# EAGLE schematic PKG900000001400 (EAGLE 7.7.0)

## Sheet 1 of 23
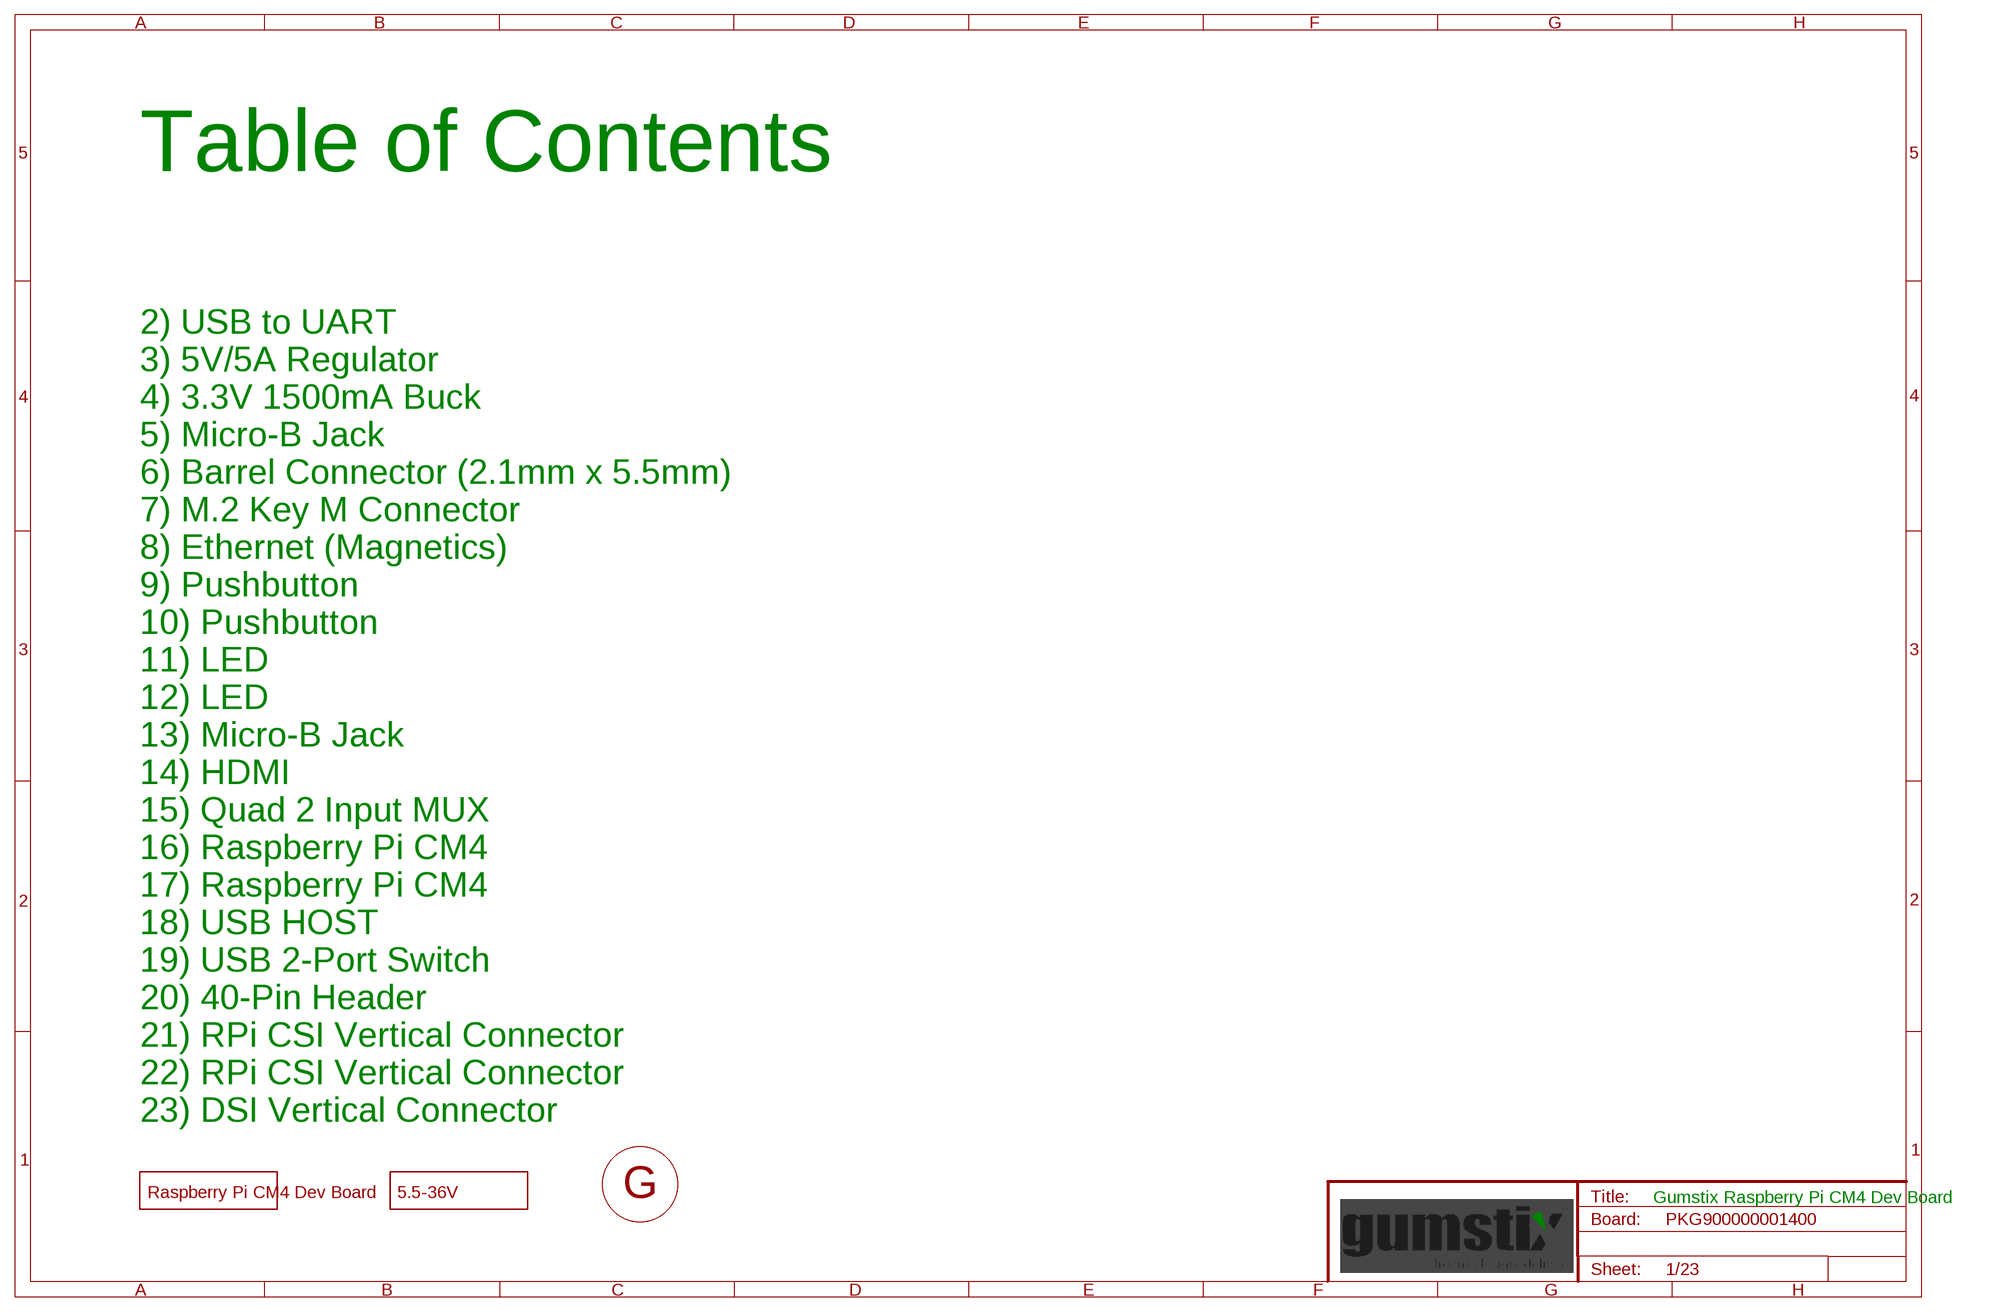
[diagram p0: schematic, sheet 1]

### Parts
FD1  DNP  FIDUCIAL  [FIDUCIAL]
FD2  DNP  FIDUCIAL  [FIDUCIAL]
FD3  DNP  FIDUCIAL  [FIDUCIAL]
FD4  DNP  FIDUCIAL  [FIDUCIAL]
FD5  DNP  FIDUCIAL  [FIDUCIAL]
FD6  DNP  FIDUCIAL  [FIDUCIAL]
FD7  DNP  FIDUCIAL  [FIDUCIAL]
FD8  DNP  FIDUCIAL  [FIDUCIAL]
U$3  DNP  GEPPETTO_LABEL"  [GEPPETTO_LABEL]
U$4  DNP  GEPPETTO_LOGO10X10  [GEPPETTO_LOGO_SILK10]
U$6  DNP  TIP_POSITIVE_LABEL  [TIP_POSITIVE_LABEL]

### Notes on the sheet
- Table of Contents
- 2) USB to UART
- 3) 5V/5A Regulator
- 4) 3.3V 1500mA Buck
- 5) Micro-B Jack
- 6) Barrel Connector (2.1mm x 5.5mm)
- 7) M.2 Key M Connector
- 8) Ethernet (Magnetics)
- 9) Pushbutton
- 10) Pushbutton
- 11) LED
- 12) LED
- 13) Micro-B Jack
- 14) HDMI
- 15) Quad 2 Input MUX
- 16) Raspberry Pi CM4
- 17) Raspberry Pi CM4
- 18) USB HOST
- 19) USB 2-Port Switch
- 20) 40-Pin Header
- 21) RPi CSI Vertical Connector
- 22) RPi CSI Vertical Connector
- 23) DSI Vertical Connector
- Gumstix Raspberry Pi CM4 Dev Board

## Sheet 2 of 23
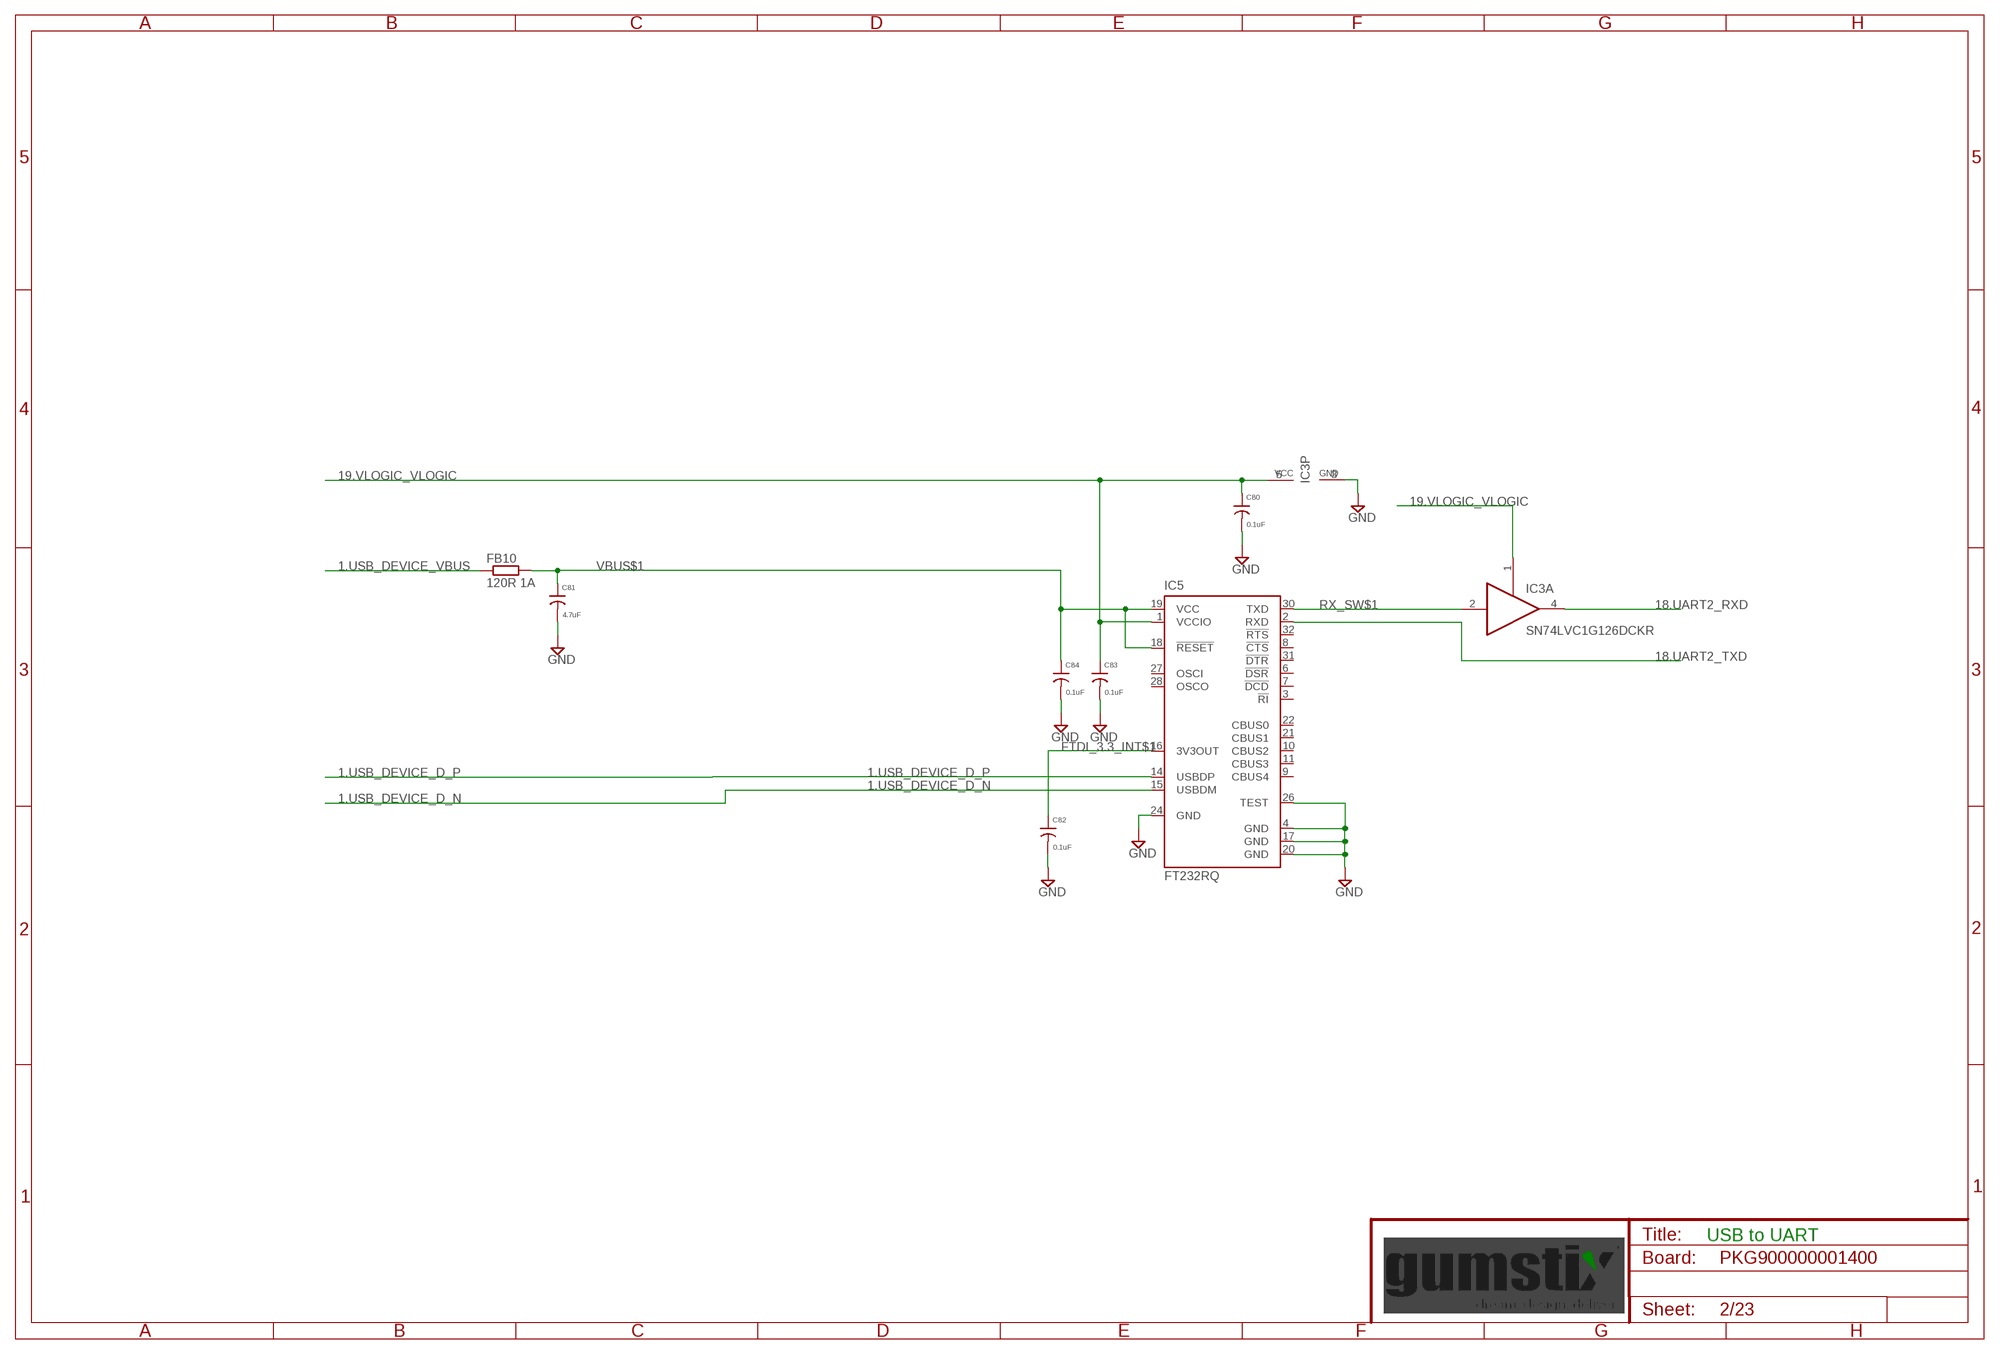
[diagram p1: schematic, sheet 2]

### Parts
C80  0.1uF  C0201  [0201]
C81  4.7uF  C0603  [0603]
C82  0.1uF  C0201  [0201]
C83  0.1uF  C0201  [0201]
C84  0.1uF  C0201  [0201]
FB10  120R 1A  FB0402  [0402]
IC3  SN74LVC1G126DCKR  [SC70-5]
IC5  FT232RQ  [QFN32]

### Nets
1.USB_DEVICE_D_N [USB]: IC5.15(USBDM) ; also sheet 5
1.USB_DEVICE_D_P [USB]: IC5.14(USBDP) ; also sheet 5
1.USB_DEVICE_VBUS [supply]: FB10.1 ; also sheet 5,15
18.UART2_RXD: IC3.4(A:O) ; also sheet 15
18.UART2_TXD: IC5.2(RXD) ; also sheet 15
19.VLOGIC_VLOGIC [supply]: C80.1 C83.1 IC3.1(A:OE) IC3.5(P:VCC) IC5.1(VCCIO) ; also sheet 9,10,14,15,16
FTDI_3.3_INT$1 [supply]: C82.1 IC5.16(3V3OUT)
GND [supply]: C80.2 C81.2 C82.2 C83.2 C84.2 IC3.3(P:GND) IC5.4(GND) IC5.17(GND) IC5.20(GND) IC5.24(GND) IC5.26(TEST) ; also sheet 3,4,5,6,7,8,9,10,11,12,13,14,15,16,17,18,19,20,21,22,23
RX_SW$1: IC3.2(A:I) IC5.30(TXD)
VBUS$1 [supply]: C81.1 C84.1 FB10.2 IC5.18(!RESET) IC5.19(VCC)
Unconnected: IC5.3(!RI) IC5.6(!DSR) IC5.7(!DCD) IC5.8(!CTS) IC5.9(CBUS4) IC5.10(CBUS2) IC5.11(CBUS3) IC5.21(CBUS1) IC5.22(CBUS0) IC5.27(OSCI) IC5.28(OSCO) IC5.31(!DTR) IC5.32(!RTS)

### Notes on the sheet
- USB to UART

## Sheet 3 of 23
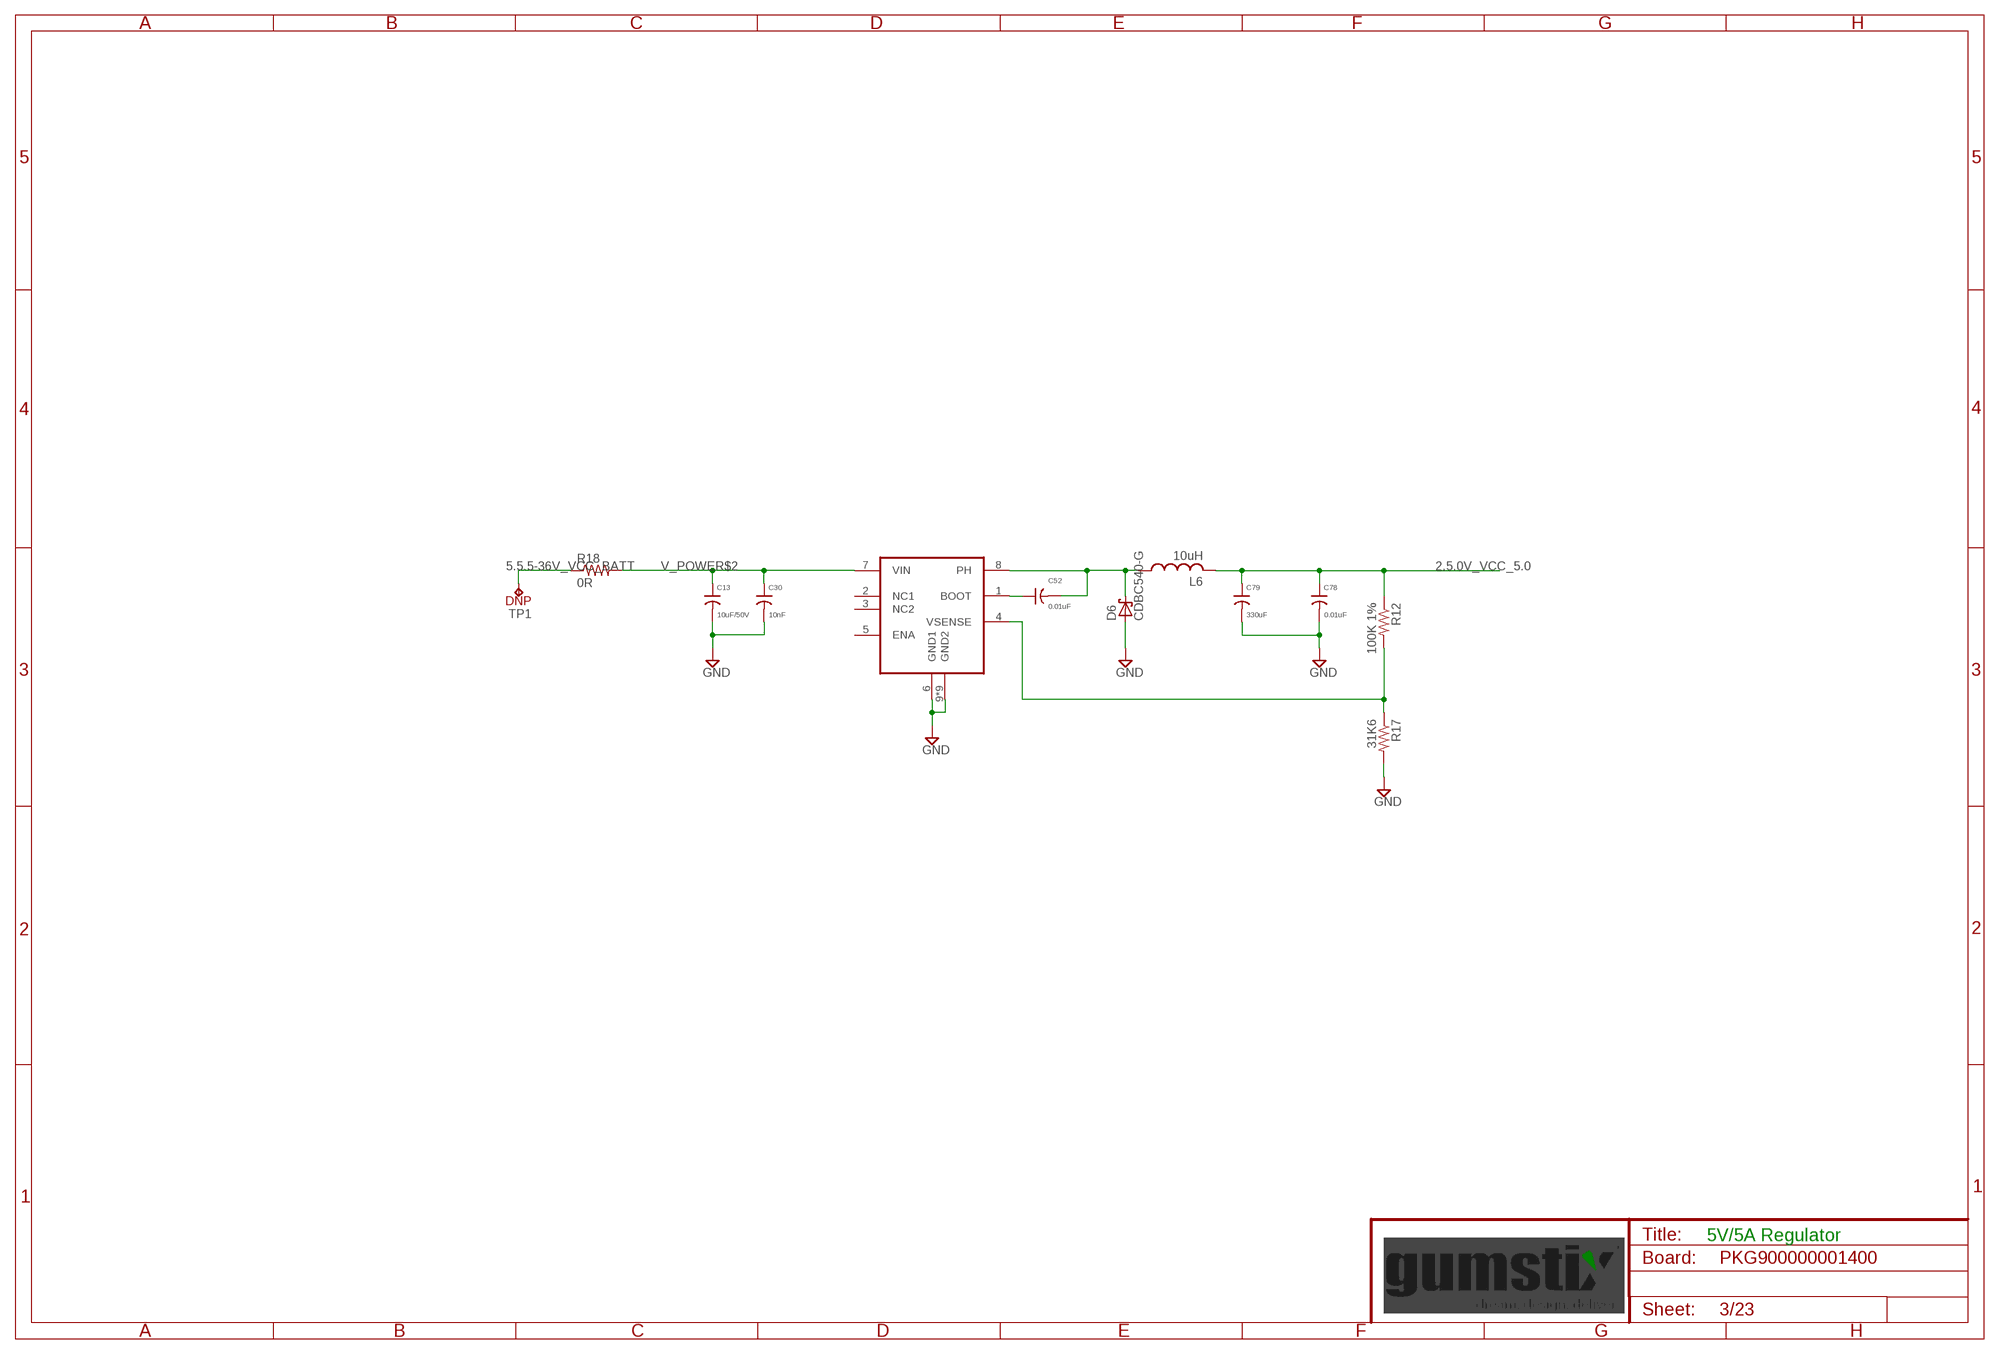
[diagram p2: schematic, sheet 3]

### Parts
C13  10uF/50V  C1206  [1206]
C30  10nF  C0603  [0603]
C52  0.01uF  C0201  [0201]
C78  0.01uF  C0201  [0201]
C79  330uF  CPANASONIC_F  [PANASONIC_F]
D6  CDBC540-G  SCHOTTKY-DIODE  [DO-214AB]
L6  10uH  L3232DZ  [3232DZ]
R12  100K 1%  R0201  [0201]
R17  31K6  R0402  [0402]
R18  0R  R0805  [0805]
TP1  DNP  TP05  [TP0500]
U7  TPS5450  [8SO_POWERPAD]

### Nets
2.5.0V_VCC_5.0 [supply]: C78.1 C79.+ L6.2 R12.1 ; also sheet 4,14,16,18,20
5.5.5-36V_VCC_BATT [supply]: R18.1 TP1.1(TP) ; also sheet 6
BOOT$2 [supply]: C52.1 U7.1(BOOT)
GND [supply]: C13.2 C30.2 C78.2 C79.- D6.A R17.2 U7.6(GND1) U7.9(GND2) U7.PWRPAD1(GND2) U7.PWRPAD2(GND2) U7.PWRPAD3(GND2) U7.PWRPAD4(GND2) U7.PWRPAD5(GND2) U7.PWRPAD6(GND2) U7.PWRPAD7(GND2) U7.PWRPAD8(GND2) ; also sheet 2,4,5,6,7,8,9,10,11,12,13,14,15,16,17,18,19,20,21,22,23
PH$2 [supply]: C52.2 D6.C L6.1 U7.8(PH)
V_POWER$2 [supply]: C13.1 C30.1 R18.2 U7.7(VIN)
VSENSE$2 [supply]: R12.2 R17.1 U7.4(VSENSE)
Unconnected: U7.2(NC1) U7.3(NC2) U7.5(ENA)

### Notes on the sheet
- 5V/5A Regulator

## Sheet 4 of 23
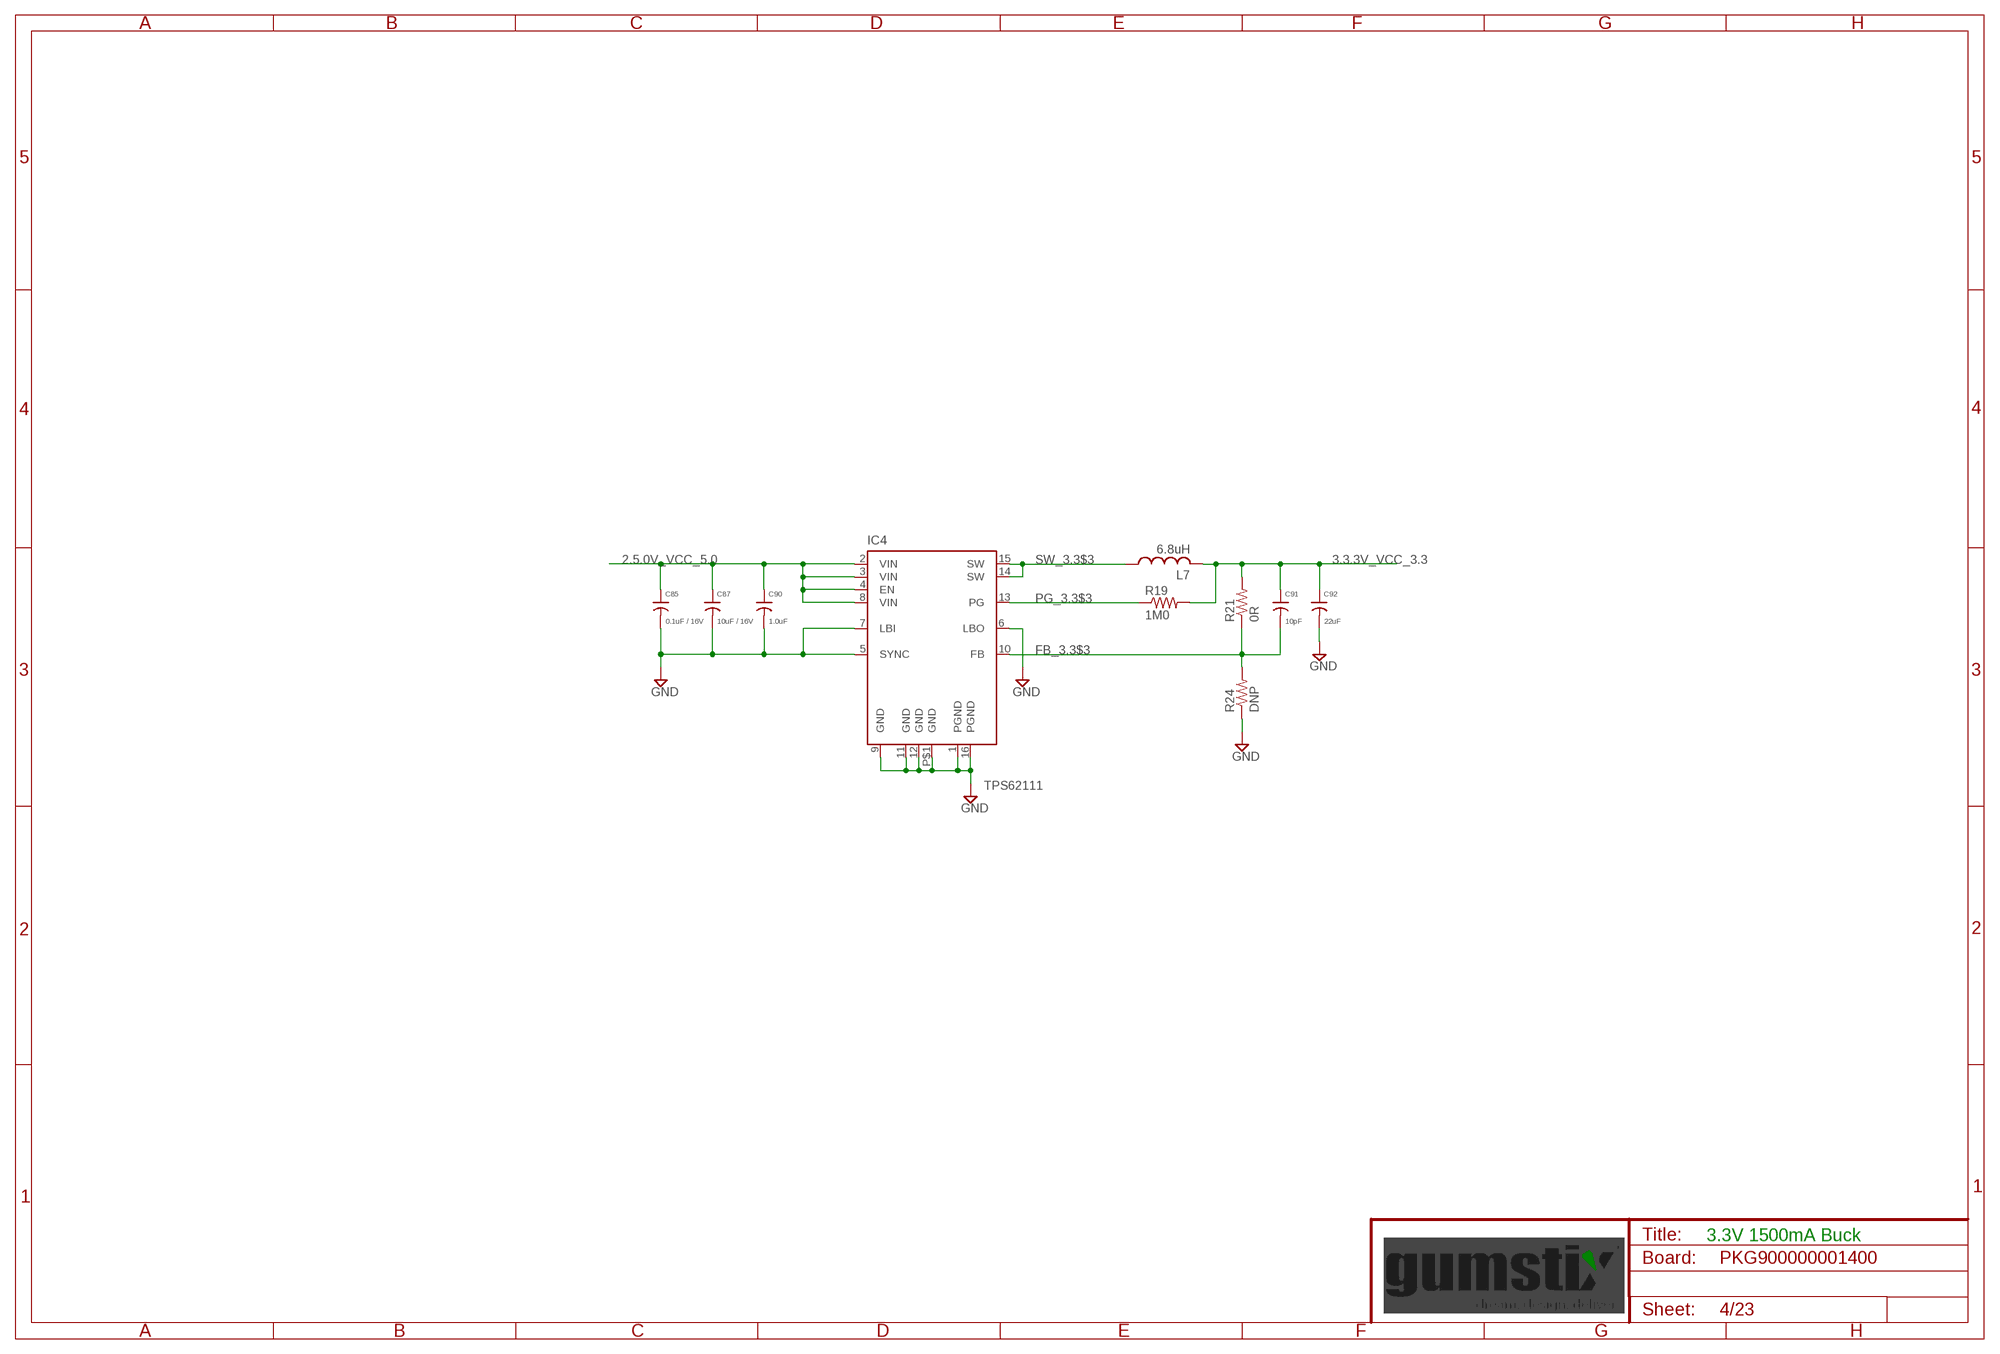
[diagram p3: schematic, sheet 4]

### Parts
C85  0.1uF / 16V  C0402  [0402]
C87  10uF / 16V  C0805  [0805]
C90  1.0uF  C0402  [0402]
C91  10pF  C0201  [0201]
C92  22uF  C0805  [0805]
IC4  TPS62111  [PQFP16]
L7  6.8uH  L1515  [1515]
R19  1M0  R0201  [0201]
R21  0R  R0402  [0402]
R24  DNP  R0402  [0402]

### Nets
2.5.0V_VCC_5.0 [supply]: C85.1 C87.1 C90.1 IC4.2(VIN) IC4.3(VIN) IC4.4(EN) IC4.8(VIN) ; also sheet 3,14,16,18,20
3.3.3V_VCC_3.3 [supply]: C91.1 C92.1 L7.2 R19.2 R21.2 ; also sheet 7,8,11,12,18,19,20,21,22,23
FB_3.3$3 [supply]: C91.2 IC4.10(FB) R21.1 R24.2
GND [supply]: C85.2 C87.2 C90.2 C92.2 IC4.1(PGND) IC4.5(SYNC) IC4.6(LBO) IC4.7(LBI) IC4.9(GND) IC4.11(GND) IC4.12(GND) IC4.16(PGND) IC4.P$1(GND) R24.1 ; also sheet 2,3,5,6,7,8,9,10,11,12,13,14,15,16,17,18,19,20,21,22,23
PG_3.3$3: IC4.13(PG) R19.1
SW_3.3$3 [supply]: IC4.14(SW) IC4.15(SW) L7.1

### Notes on the sheet
- 3.3V 1500mA Buck

## Sheet 5 of 23
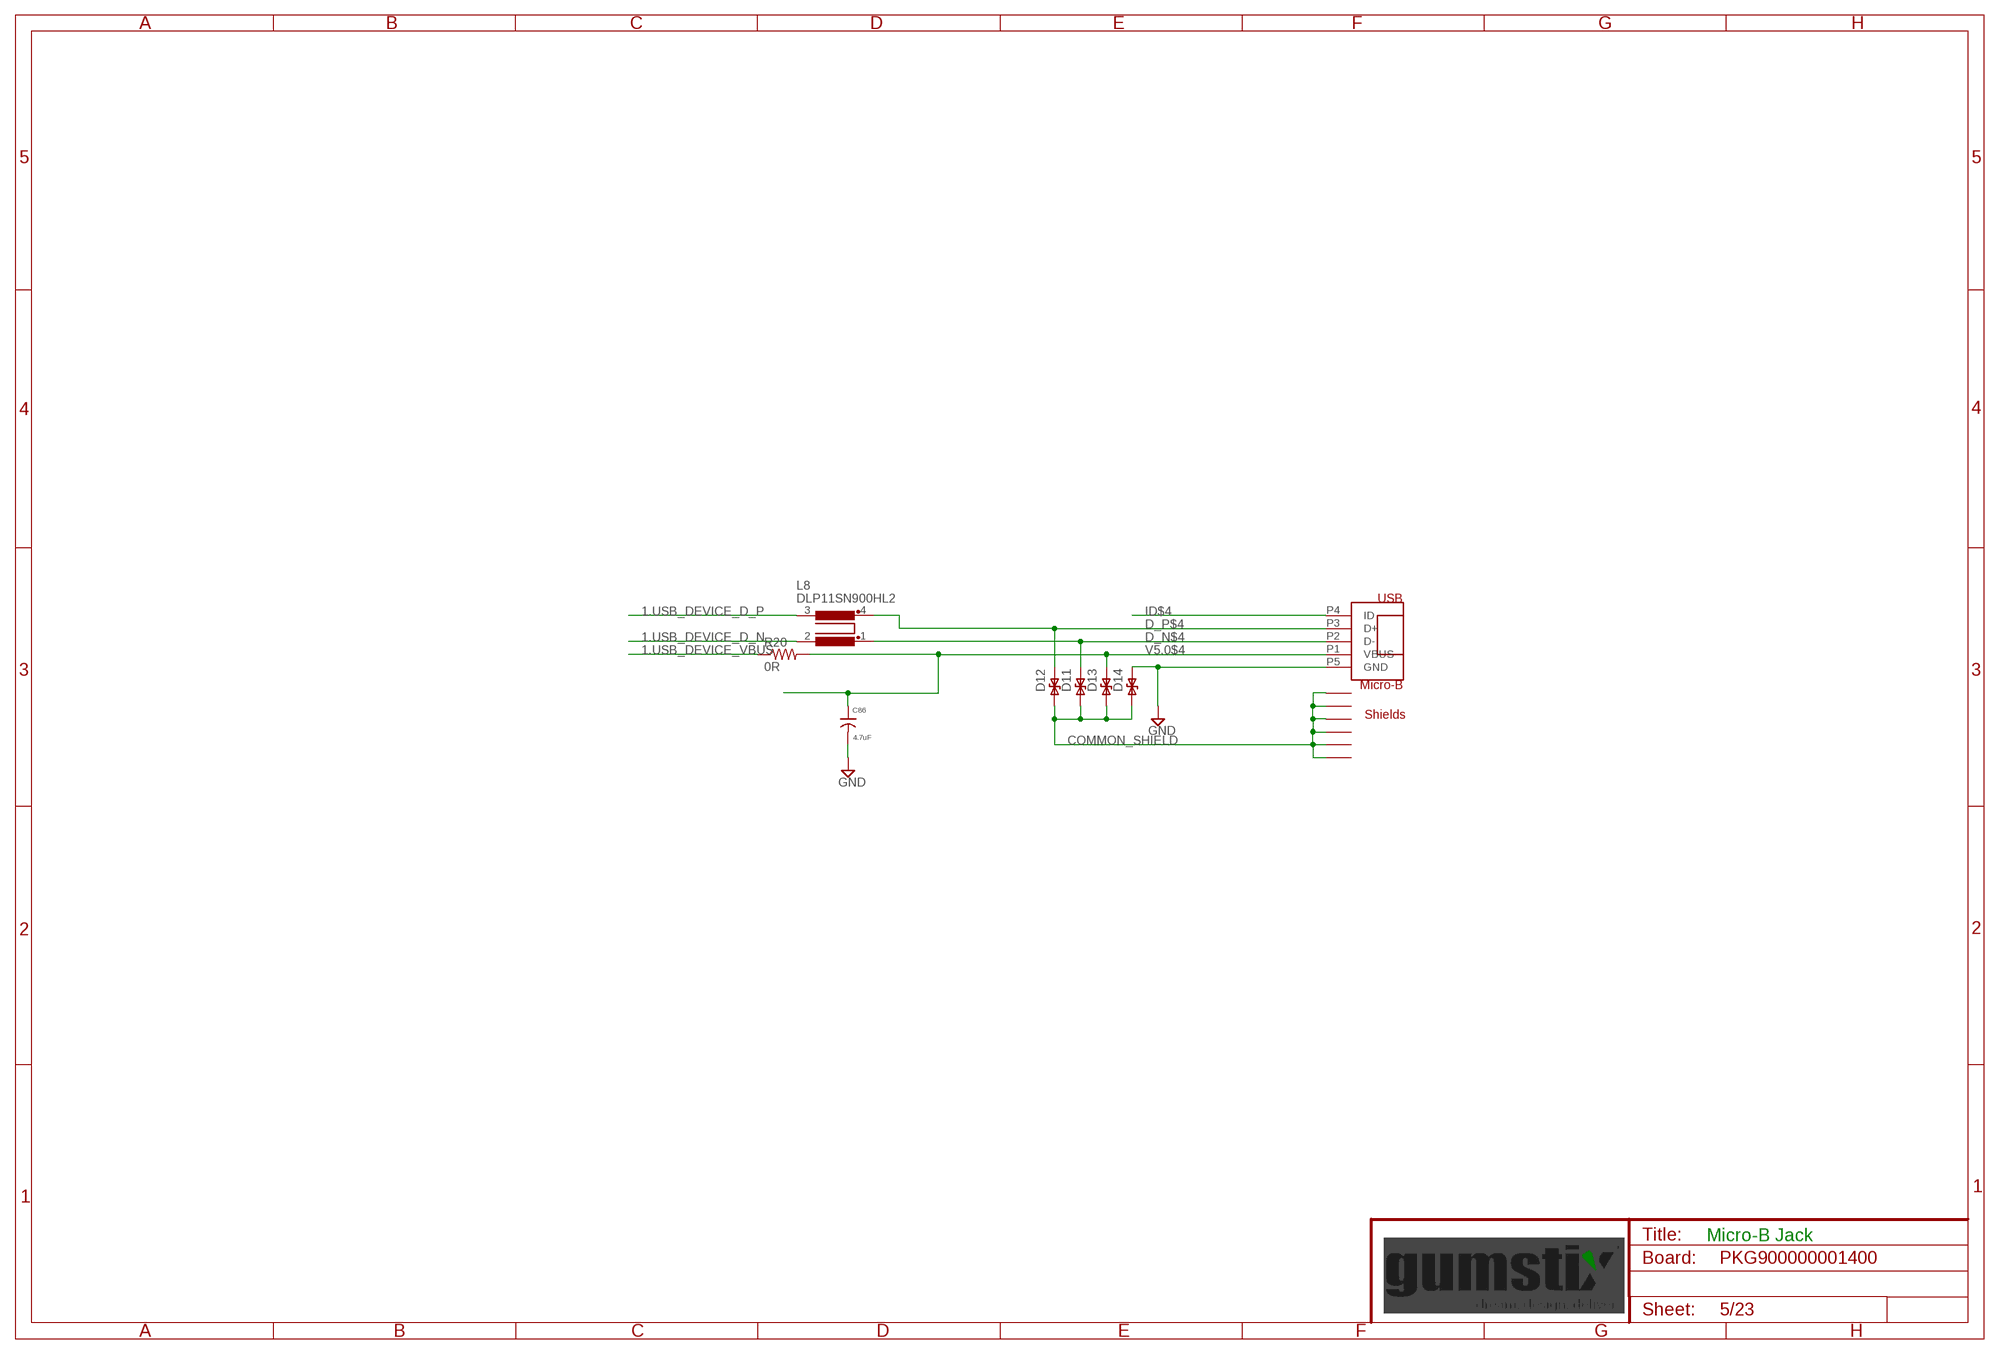
[diagram p4: schematic, sheet 5]

### Parts
C86  4.7uF  C0603  [0603]
D11  PS04LTVA1  ESD-DIODE  [D0402]
D12  PS04LTVA1  ESD-DIODE  [D0402]
D13  B72590D50A060  ESD-DIODE  [D0402]
D14  B72590D50A060  ESD-DIODE  [D0402]
J6  USB_MICRO_B  [USB_MICRO_B]
L8  DLP11SN900HL2  COM_MODE_CHOKE  [0504-DLP11S]
R20  0R  R0201  [0201]

### Nets
1.USB_DEVICE_D_N [USB]: L8.2 ; also sheet 2
1.USB_DEVICE_D_P [USB]: L8.3 ; also sheet 2
1.USB_DEVICE_VBUS [supply]: R20.1 ; also sheet 2,15
COMMON_SHIELD [supply]: D11.P1 D12.P1 D13.P1 D14.P1 J6.COMMON_SHEILD1(COMMON_SHIELD1) J6.COMMON_SHEILD2(COMMON_SHIELD2) J6.COMMON_SHEILD3(COMMON_SHIELD3) J6.COMMON_SHEILD4(COMMON_SHIELD4) J6.COMMON_SHEILD5(COMMON_SHIELD5) J6.COMMON_SHEILD6(COMMON_SHIELD6) ; also sheet 6,8,13,14,18
D_N$4 [USB]: D11.P2 J6.P2(D-) L8.1
D_P$4 [USB]: D12.P2 J6.P3(D+) L8.4
GND [supply]: C86.2 D14.P2 J6.P5(GND) ; also sheet 2,3,4,6,7,8,9,10,11,12,13,14,15,16,17,18,19,20,21,22,23
ID$4: J6.P4(ID)
V5.0$4 [supply]: C86.1 D13.P2 J6.P1(VBUS) R20.2

### Notes on the sheet
- Micro-B Jack

## Sheet 6 of 23
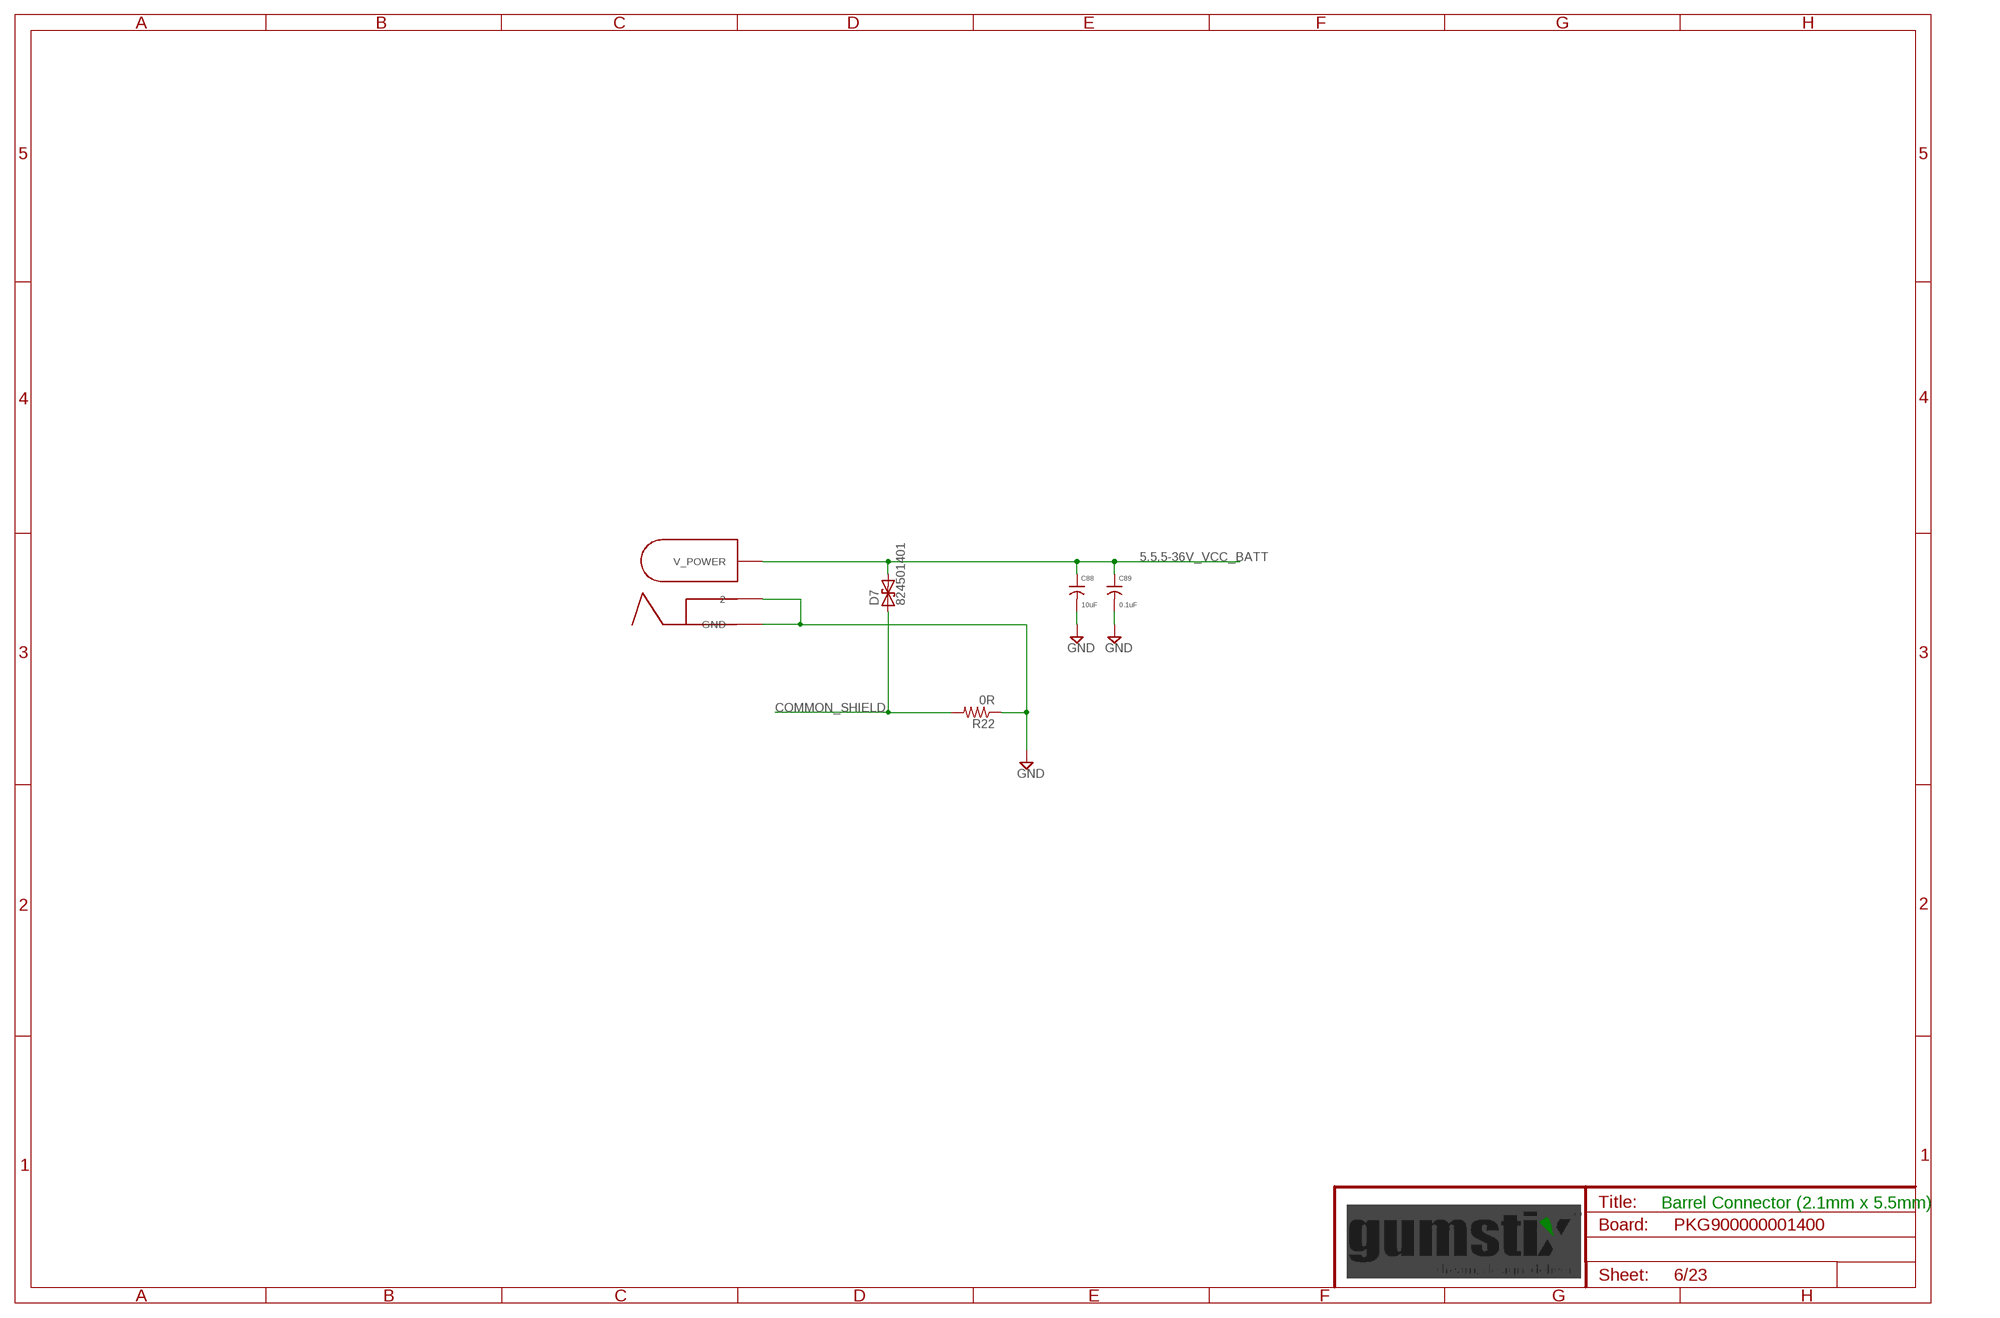
[diagram p5: schematic, sheet 6]

### Parts
C88  10uF  C0603  [0603]
C89  0.1uF  C0201  [0201]
D7  824501401  TVS-DIODESMA  [SMAJ]
J3  PJ-002A  [PJ-002A]
R22  0R  R0201  [0201]

### Nets
5.5.5-36V_VCC_BATT [supply]: C88.1 C89.1 D7.C J3.1(V_POWER) ; also sheet 3
COMMON_SHIELD [supply]: D7.A R22.2 ; also sheet 5,8,13,14,18
GND [supply]: C88.2 C89.2 J3.2(GND) J3.3 R22.1 ; also sheet 2,3,4,5,7,8,9,10,11,12,13,14,15,16,17,18,19,20,21,22,23

### Notes on the sheet
- Barrel Connector (2.1mm x 5.5mm)

## Sheet 7 of 23
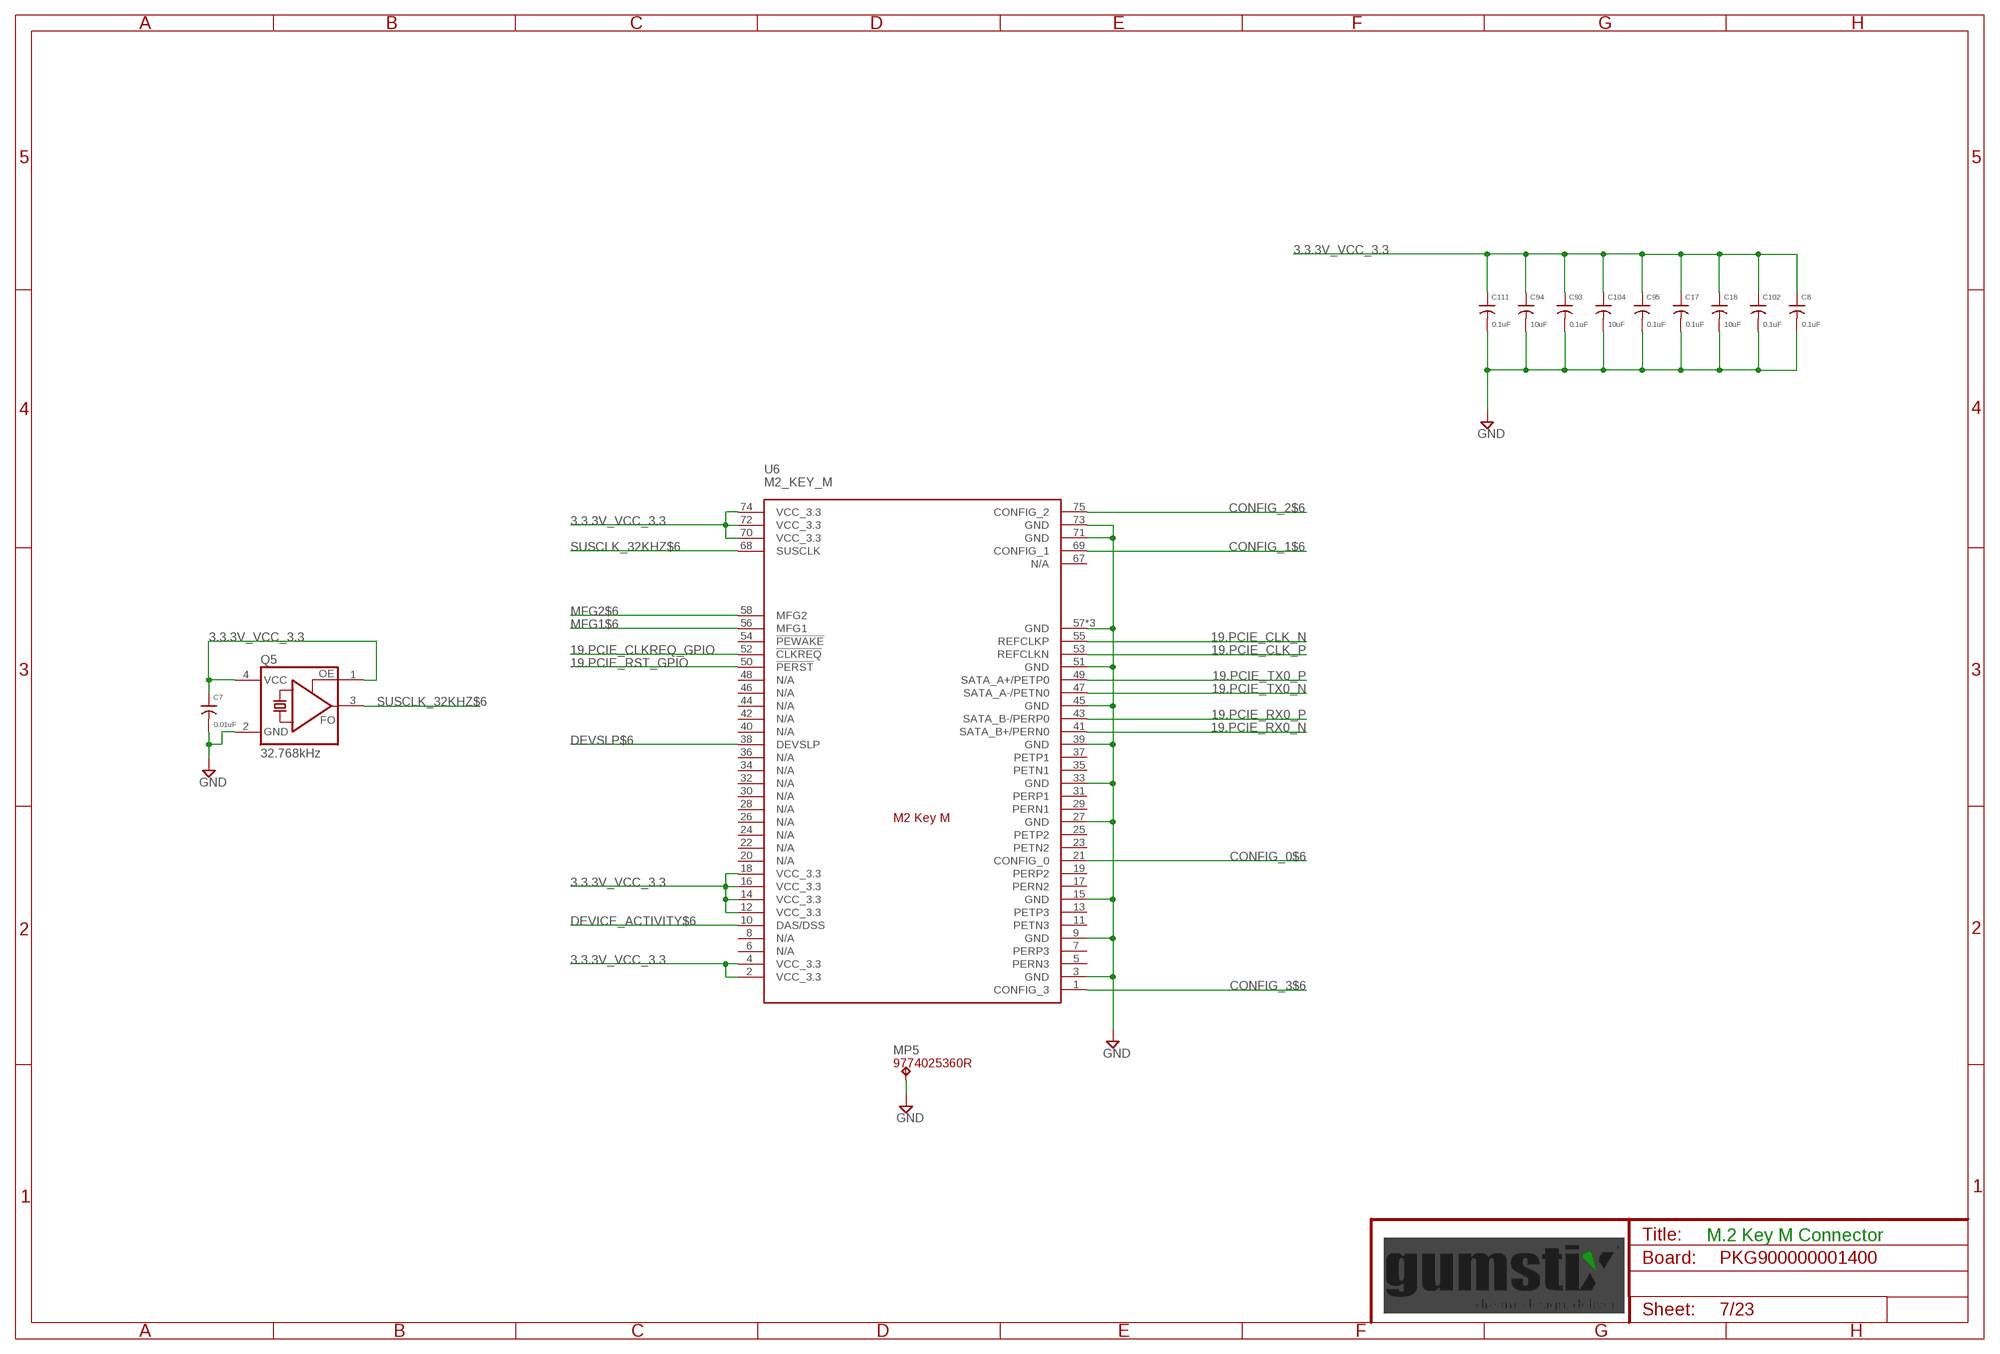
[diagram p6: schematic, sheet 7]

### Parts
C7  0.01uF  C0201  [0201]
C8  0.1uF  C0201  [0201]
C17  0.1uF  C0201  [0201]
C18  10uF  C0603  [0603]
C93  0.1uF  C0201  [0201]
C94  10uF  C0603  [0603]
C95  0.1uF  C0201  [0201]
C102  0.1uF  C0201  [0201]
C104  10uF  C0603  [0603]
C111  0.1uF  C0201  [0201]
MP5  9774025360R  BULLET_CONN3MM  [WA-SMSI_9774___360]
Q5  32.768kHz  ASFVLGA  [VLGA-4]
U6  M2_KEY_M  [2199230_KEY_M]

### Nets
3.3.3V_VCC_3.3 [supply]: C7.1 C8.1 C17.1 C18.1 C93.1 C94.1 C95.1 C102.1 C104.1 C111.1 Q5.1(OE) Q5.4(VCC) U6.2(VCC_3.3) U6.4(VCC_3.3) U6.12(VCC_3.3) U6.14(VCC_3.3) U6.16(VCC_3.3) U6.18(VCC_3.3) U6.70(VCC_3.3) U6.72(VCC_3.3) U6.74(VCC_3.3) ; also sheet 4,8,11,12,18,19,20,21,22,23
19.PCIE_CLK_N [USB]: U6.55(REFCLKP) ; also sheet 16
19.PCIE_CLK_P [USB]: U6.53(REFCLKN) ; also sheet 16
19.PCIE_CLKREQ_GPIO: U6.52(!CLKREQ) ; also sheet 16
19.PCIE_RST_GPIO: U6.50(!PERST) ; also sheet 16
19.PCIE_RX0_N [USB]: U6.41(SATA_B+/PERN0) ; also sheet 16
19.PCIE_RX0_P [USB]: U6.43(SATA_B-/PERP0) ; also sheet 16
19.PCIE_TX0_N [USB]: U6.47(SATA_A-/PETN0) ; also sheet 16
19.PCIE_TX0_P [USB]: U6.49(SATA_A+/PETP0) ; also sheet 16
CONFIG_0$6: U6.21(CONFIG_0)
CONFIG_1$6: U6.69(CONFIG_1)
CONFIG_2$6: U6.75(CONFIG_2)
CONFIG_3$6: U6.1(CONFIG_3)
DEVICE_ACTIVITY$6 [supply]: U6.10(DAS/DSS)
DEVSLP$6: U6.38(DEVSLP)
GND [supply]: C7.2 C8.2 C17.2 C18.2 C93.2 C94.2 C95.2 C102.2 C104.2 C111.2 MP5.1(TP) Q5.2(GND) U6.3(GND) U6.9(GND) U6.15(GND) U6.27(GND) U6.33(GND) U6.39(GND) U6.45(GND) U6.51(GND) U6.57(GND) U6.71(GND) U6.73(GND) U6.P$1(GND) U6.P$2(GND) ; also sheet 2,3,4,5,6,8,9,10,11,12,13,14,15,16,17,18,19,20,21,22,23
MFG1$6: U6.56(MFG1)
MFG2$6: U6.58(MFG2)
SUSCLK_32KHZ$6: Q5.3(FO) U6.68(SUSCLK)
Unconnected: U6.5(PERN3) U6.6(N/A) U6.7(PERP3) U6.8(N/A) U6.11(PETN3) U6.13(PETP3) U6.17(PERN2) U6.19(PERP2) U6.20(N/A) U6.22(N/A) U6.23(PETN2) U6.24(N/A) U6.25(PETP2) U6.26(N/A) U6.28(N/A) U6.29(PERN1) U6.30(N/A) U6.31(PERP1) U6.32(N/A) U6.34(N/A) U6.35(PETN1) U6.36(N/A) U6.37(PETP1) U6.40(N/A) U6.42(N/A) U6.44(N/A) U6.46(N/A) U6.48(N/A) U6.54(!PEWAKE) U6.67(N/A)

### Notes on the sheet
- M.2 Key M Connector

## Sheet 8 of 23
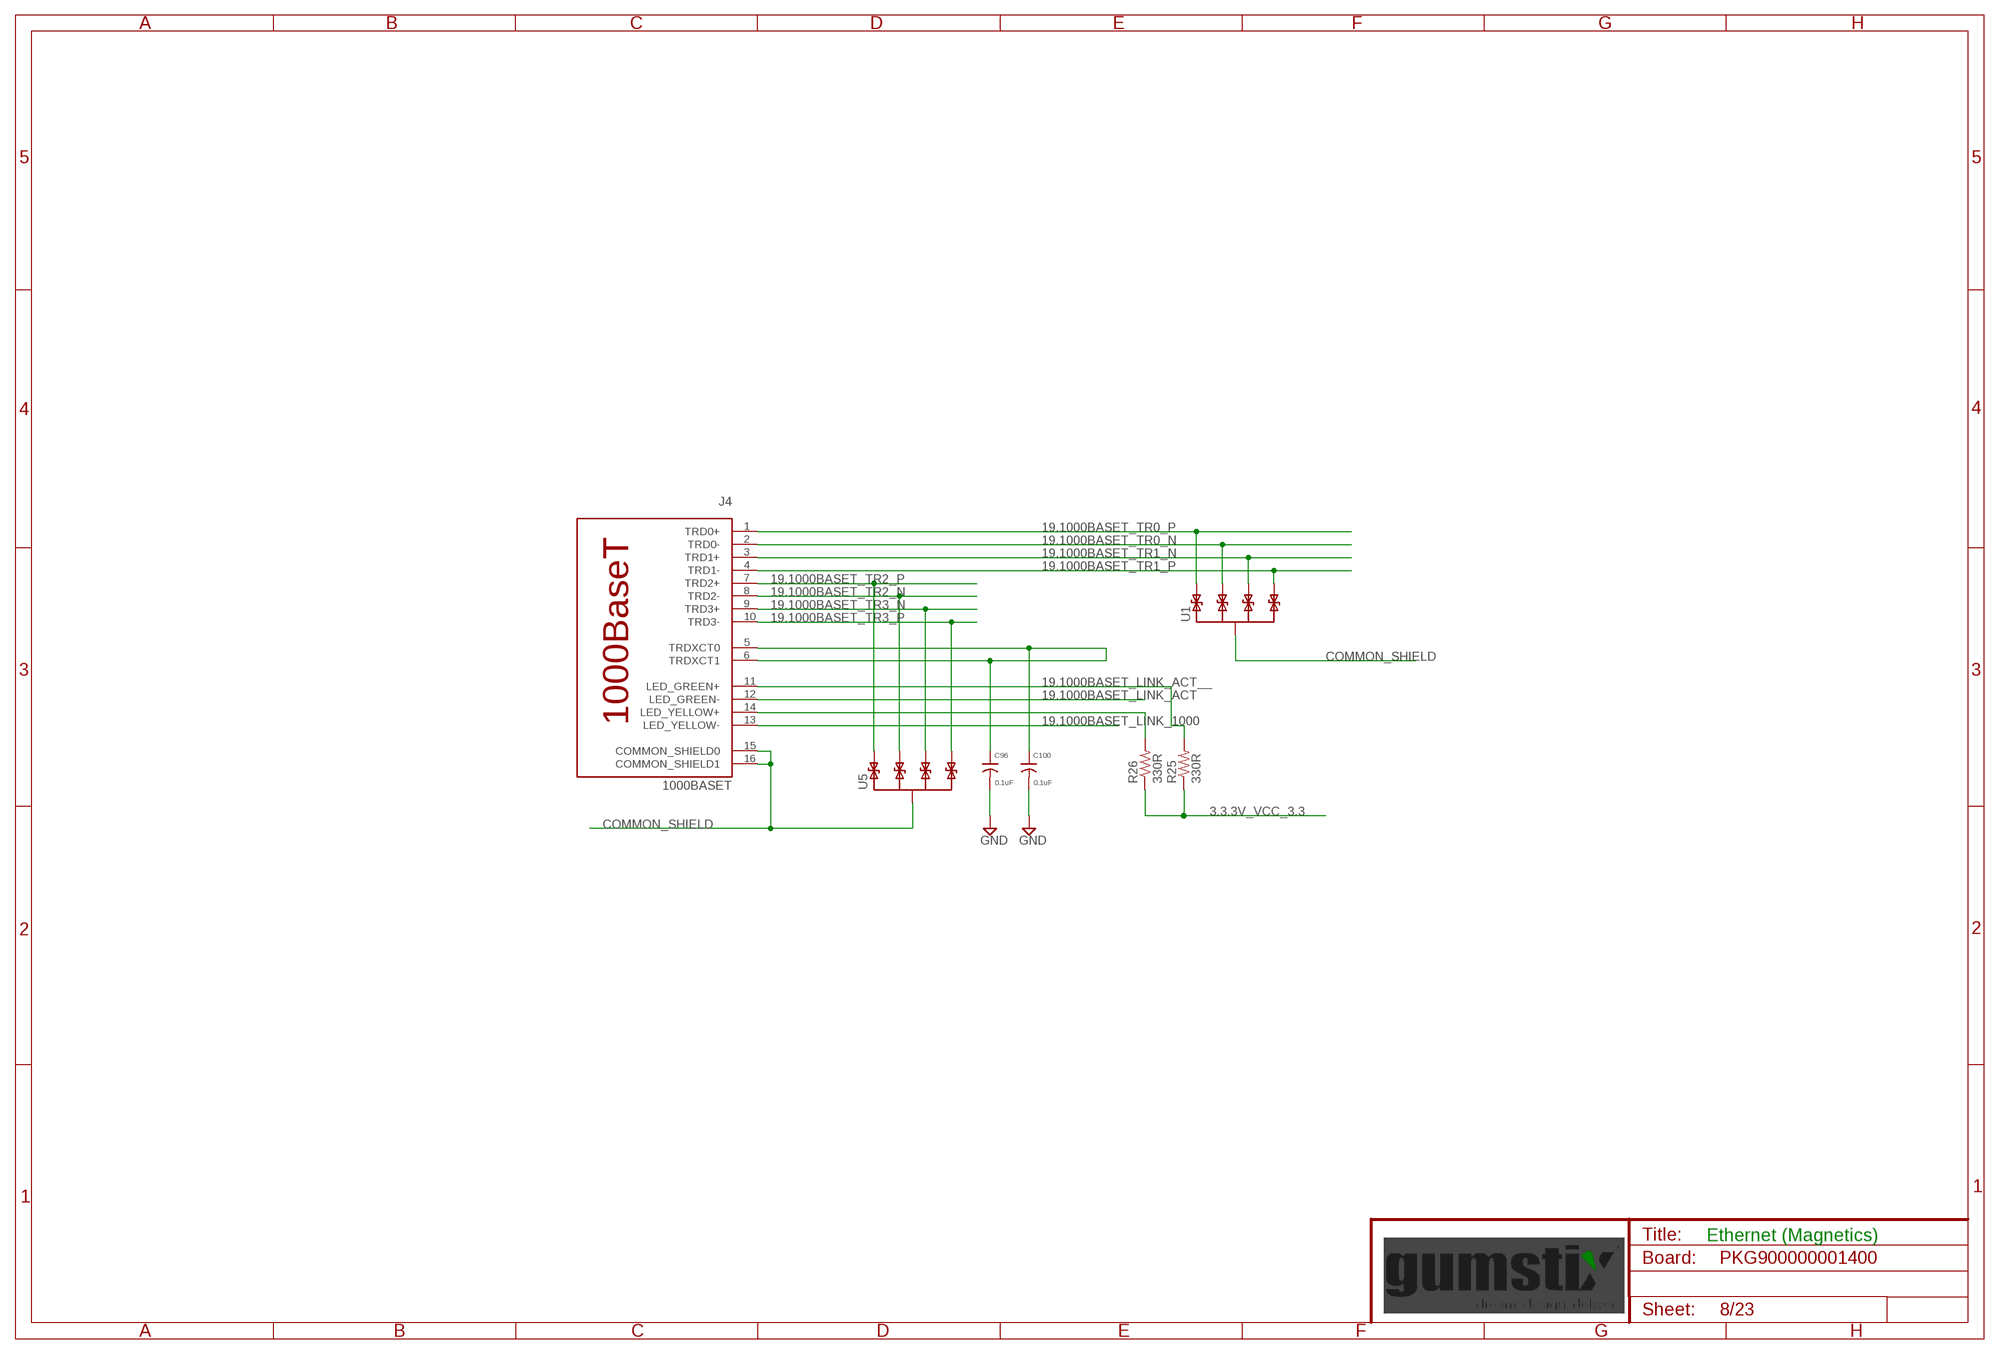
[diagram p7: schematic, sheet 8]

### Parts
C96  0.1uF  C0201  [0201]
C100  0.1uF  C0201  [0201]
J4  1000BASET  [7499111447]
R25  330R  R0201  [0201]
R26  330R  R0201  [0201]
U1  TPD4E02B0410-USON  [UFDFN-10]
U5  TPD4E02B0410-USON  [UFDFN-10]

### Nets
3.3.3V_VCC_3.3 [supply]: R25.1 R26.1 ; also sheet 4,7,11,12,18,19,20,21,22,23
19.1000BASET_LINK_1000: J4.13(LED_YELLOW-) ; also sheet 16
19.1000BASET_LINK_ACT: J4.12(LED_GREEN-) ; also sheet 16
19.1000BASET_LINK_ACT__: J4.11(LED_GREEN+) R25.2
19.1000BASET_TR0_N [HDMI]: J4.2(TRD0-) U1.2 U1.9(P2) ; also sheet 16
19.1000BASET_TR0_P [HDMI]: J4.1(TRD0+) U1.1 U1.10(P1) ; also sheet 16
19.1000BASET_TR1_N [HDMI]: J4.3(TRD1+) U1.4(P3) U1.7(P3) ; also sheet 16
19.1000BASET_TR1_P [HDMI]: J4.4(TRD1-) U1.5(P4) U1.6(P4) ; also sheet 16
19.1000BASET_TR2_N [HDMI]: J4.8(TRD2-) U5.2 U5.9(P2) ; also sheet 16
19.1000BASET_TR2_P [HDMI]: J4.7(TRD2+) U5.1 U5.10(P1) ; also sheet 16
19.1000BASET_TR3_N [HDMI]: J4.9(TRD3+) U5.4(P3) U5.7(P3) ; also sheet 16
19.1000BASET_TR3_P [HDMI]: J4.10(TRD3-) U5.5(P4) U5.6(P4) ; also sheet 16
COMMON_SHIELD [supply]: J4.15(COMMON_SHIELD0) J4.16(COMMON_SHIELD1) U1.3(SHIELD) U1.8(SHIELD) U5.3(SHIELD) U5.8(SHIELD) ; also sheet 5,6,13,14,18
CT0$7 [supply]: C96.1 C100.1 J4.5(TRDXCT0) J4.6(TRDXCT1)
GND [supply]: C96.2 C100.2 ; also sheet 2,3,4,5,6,7,9,10,11,12,13,14,15,16,17,18,19,20,21,22,23
LED_YELLOW_P$7: J4.14(LED_YELLOW+) R26.2

### Notes on the sheet
- Ethernet (Magnetics)

## Sheet 9 of 23
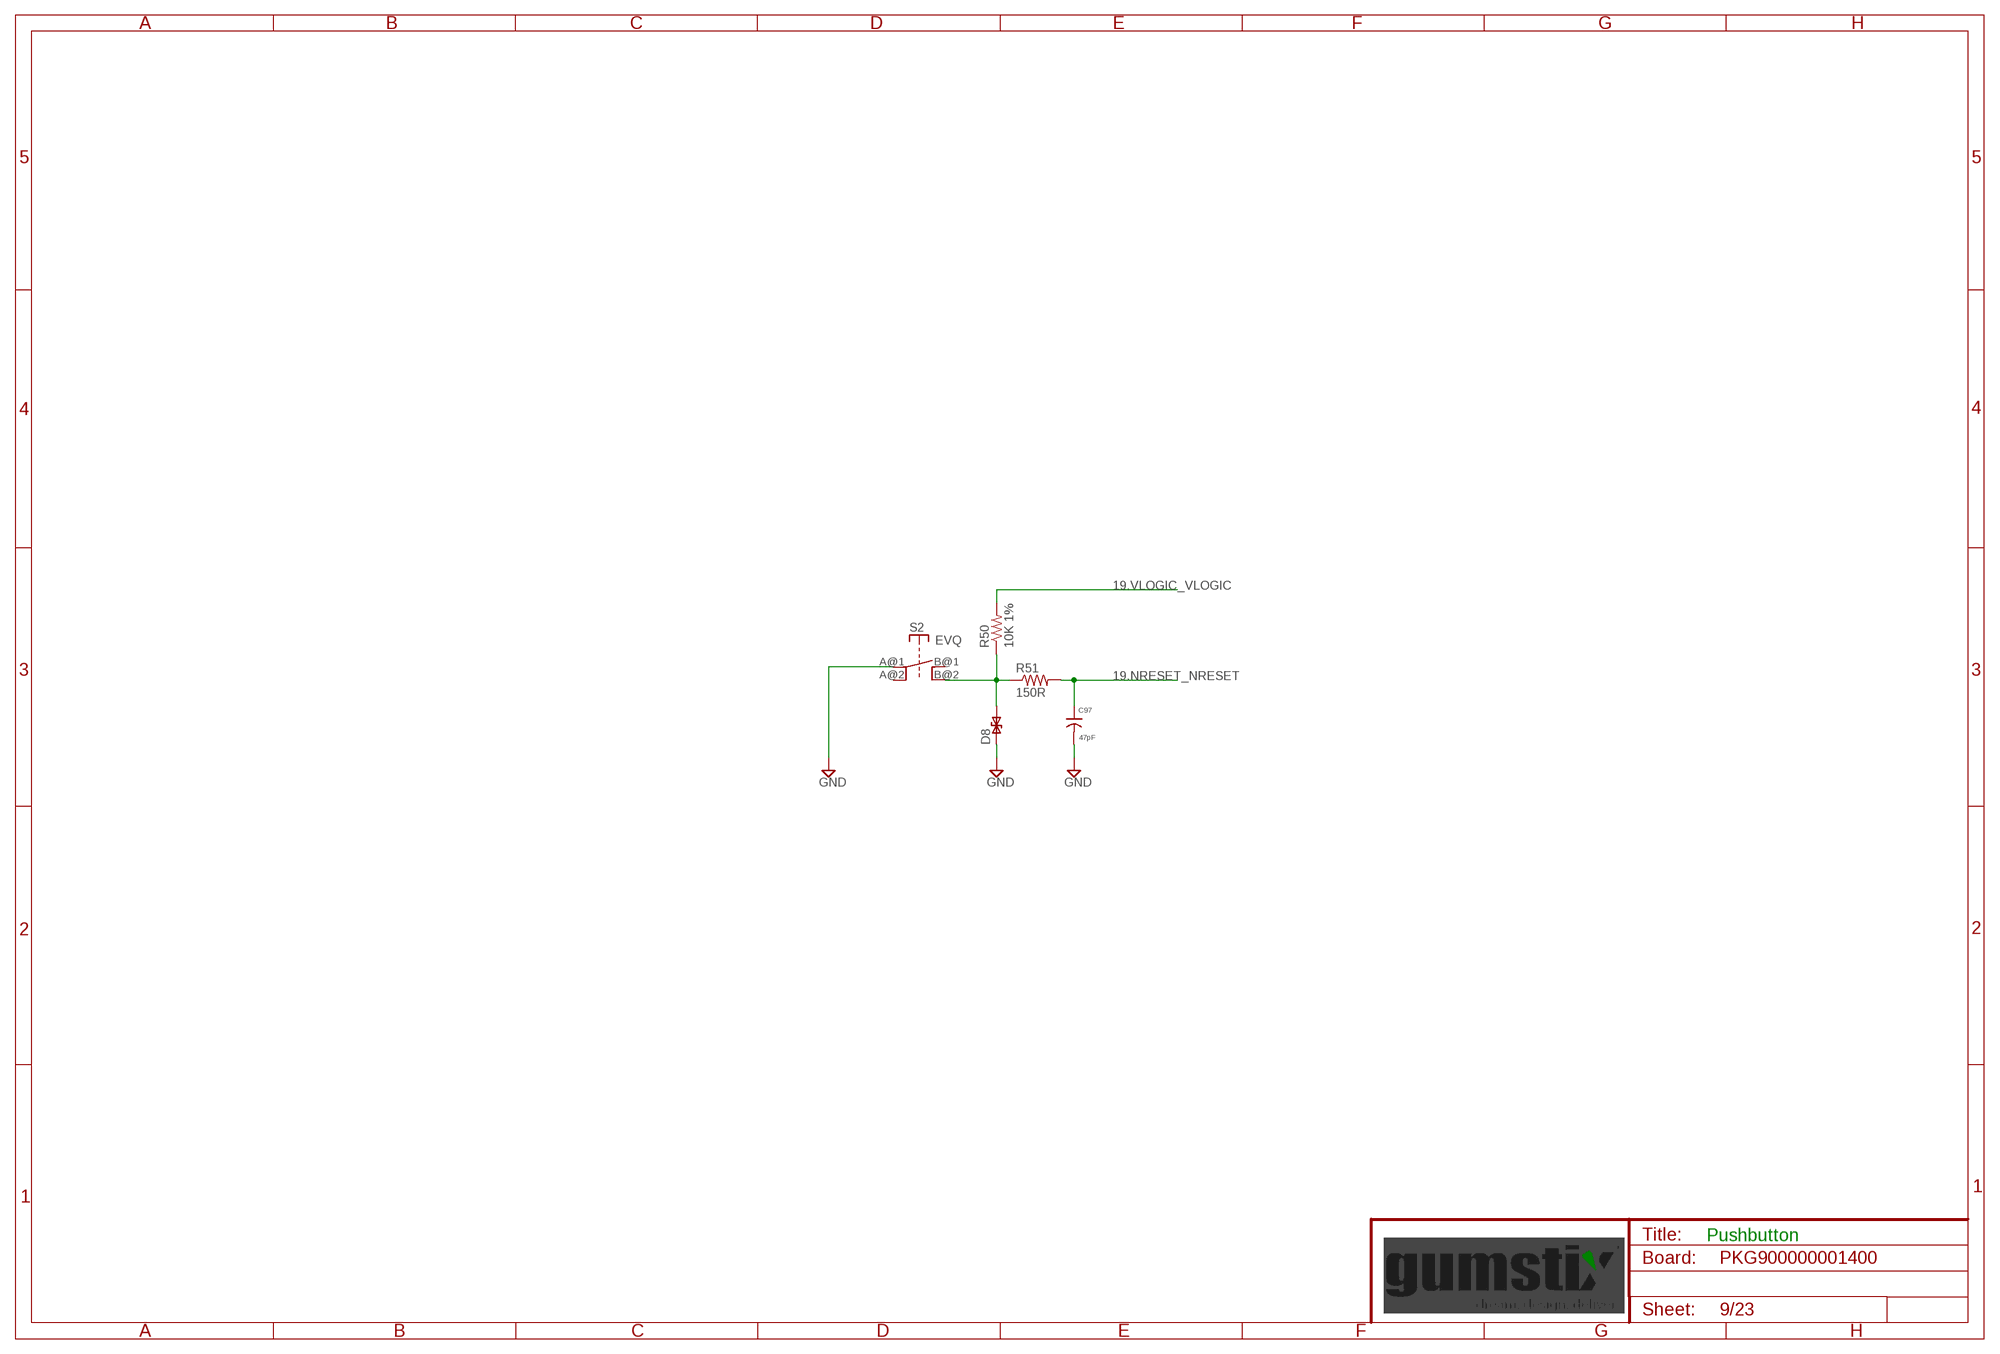
[diagram p8: schematic, sheet 9]

### Parts
C97  47pF  C0201  [0201]
D8  B72590D50A060  ESD-DIODE  [D0402]
R50  10K 1%  R0201  [0201]
R51  150R  R0201  [0201]
S2  EVQ  [EVQ]

### Nets
19.NRESET_NRESET: C97.1 R51.2 ; also sheet 16
19.VLOGIC_VLOGIC [supply]: R50.2 ; also sheet 2,10,14,15,16
BTN_A$12: D8.P2 R50.1 R51.1 S2.B@2(B')
GND [supply]: C97.2 D8.P1 S2.A@1(A) ; also sheet 2,3,4,5,6,7,8,10,11,12,13,14,15,16,17,18,19,20,21,22,23
Unconnected: S2.A@2(A') S2.B@1(B)

### Notes on the sheet
- Pushbutton

## Sheet 10 of 23
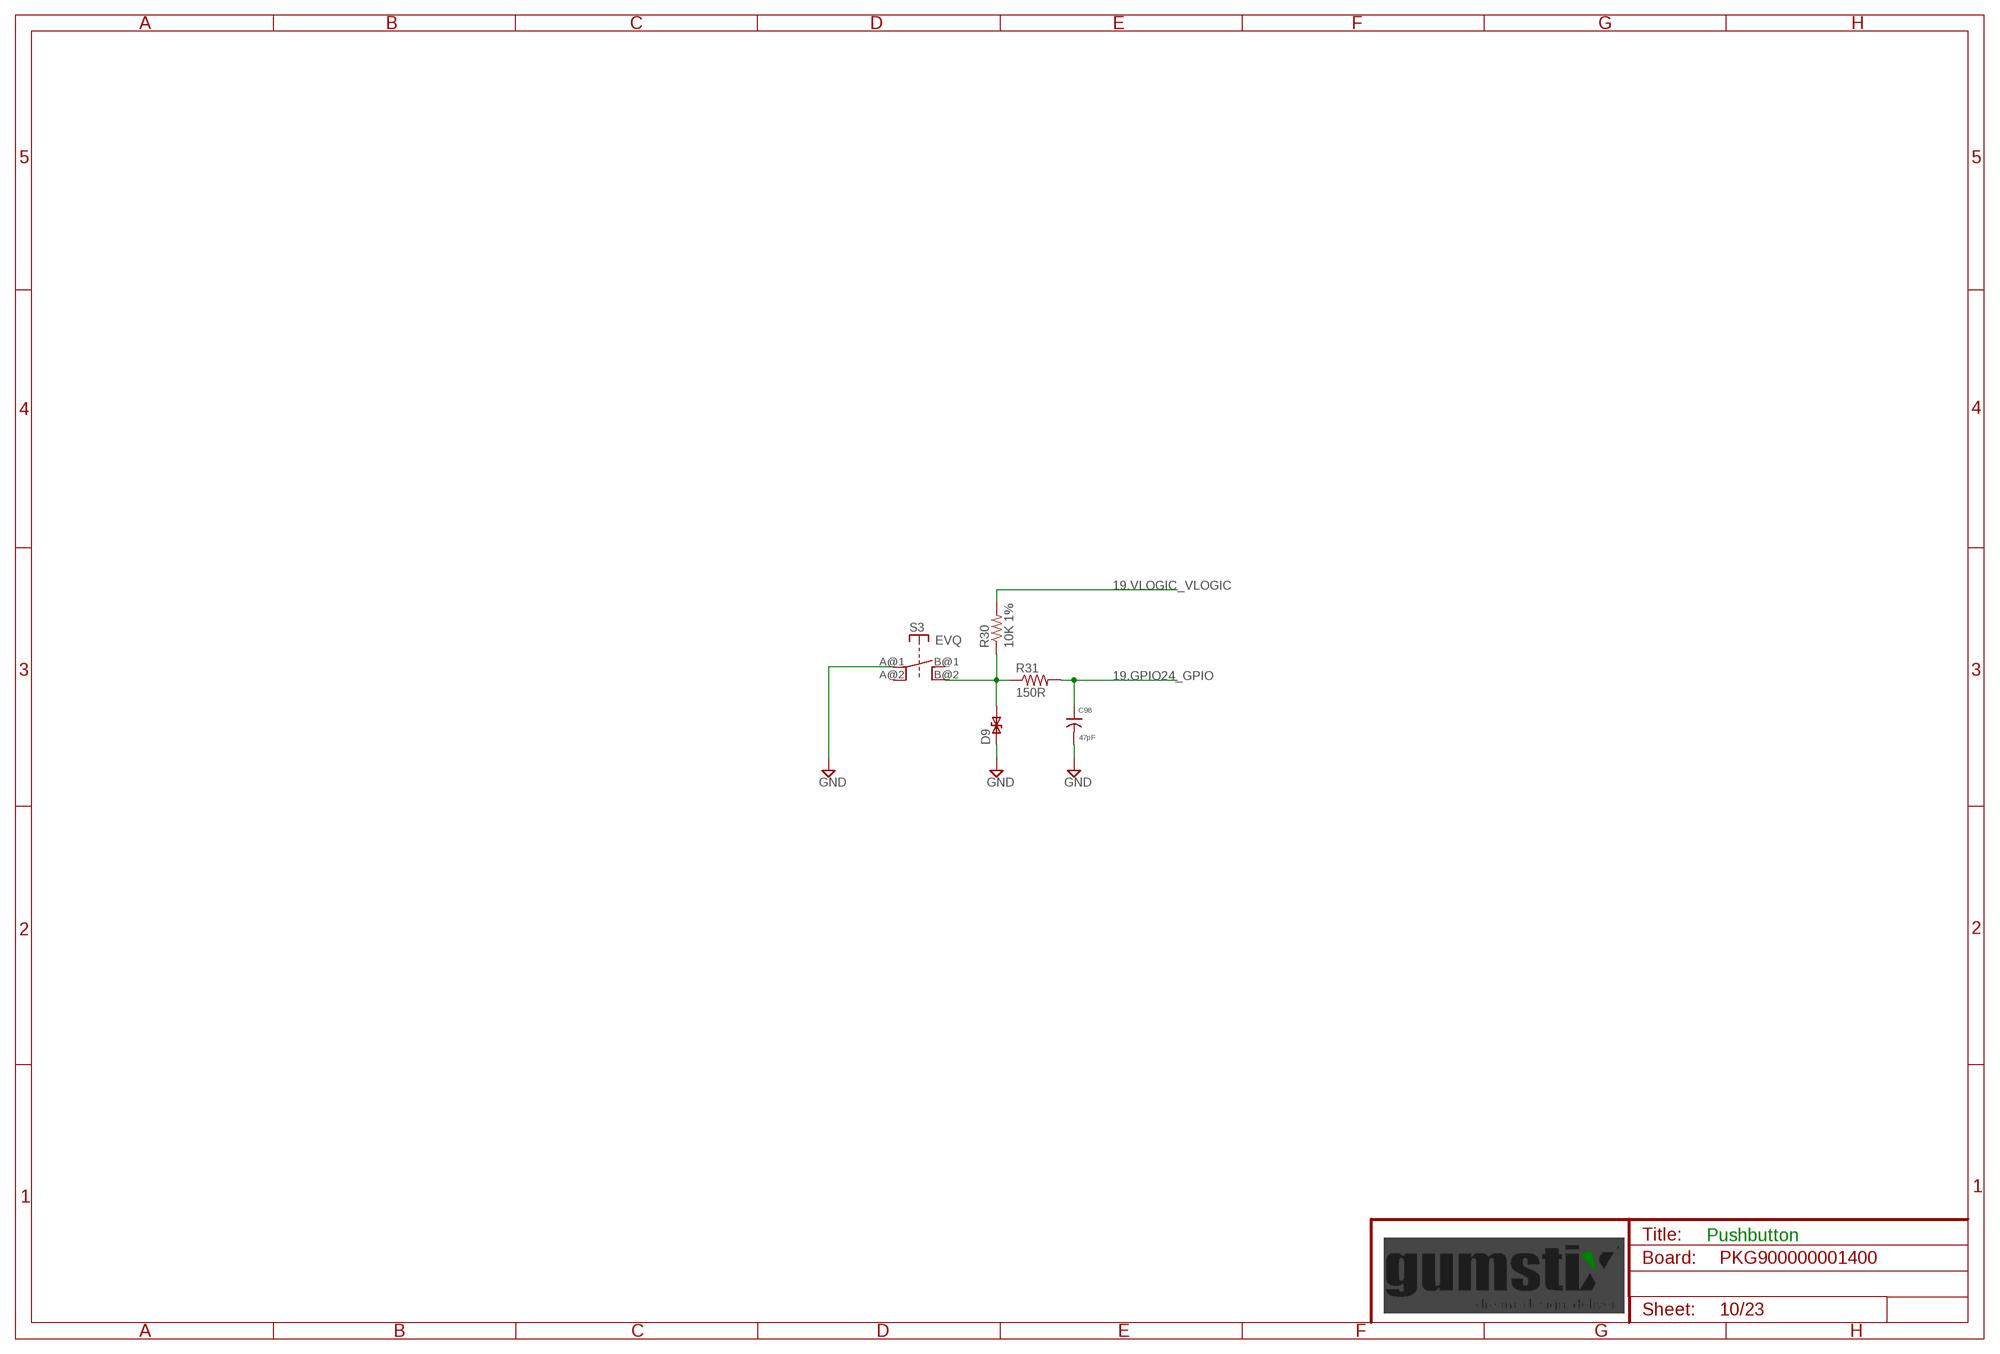
[diagram p9: schematic, sheet 10]

### Parts
C98  47pF  C0201  [0201]
D9  B72590D50A060  ESD-DIODE  [D0402]
R30  10K 1%  R0201  [0201]
R31  150R  R0201  [0201]
S3  EVQ  [EVQ]

### Nets
19.GPIO24_GPIO: C98.1 R31.2 ; also sheet 16,20
19.VLOGIC_VLOGIC [supply]: R30.2 ; also sheet 2,9,14,15,16
BTN_A$13: D9.P2 R30.1 R31.1 S3.B@2(B')
GND [supply]: C98.2 D9.P1 S3.A@1(A) ; also sheet 2,3,4,5,6,7,8,9,11,12,13,14,15,16,17,18,19,20,21,22,23
Unconnected: S3.A@2(A') S3.B@1(B)

### Notes on the sheet
- Pushbutton

## Sheet 11 of 23
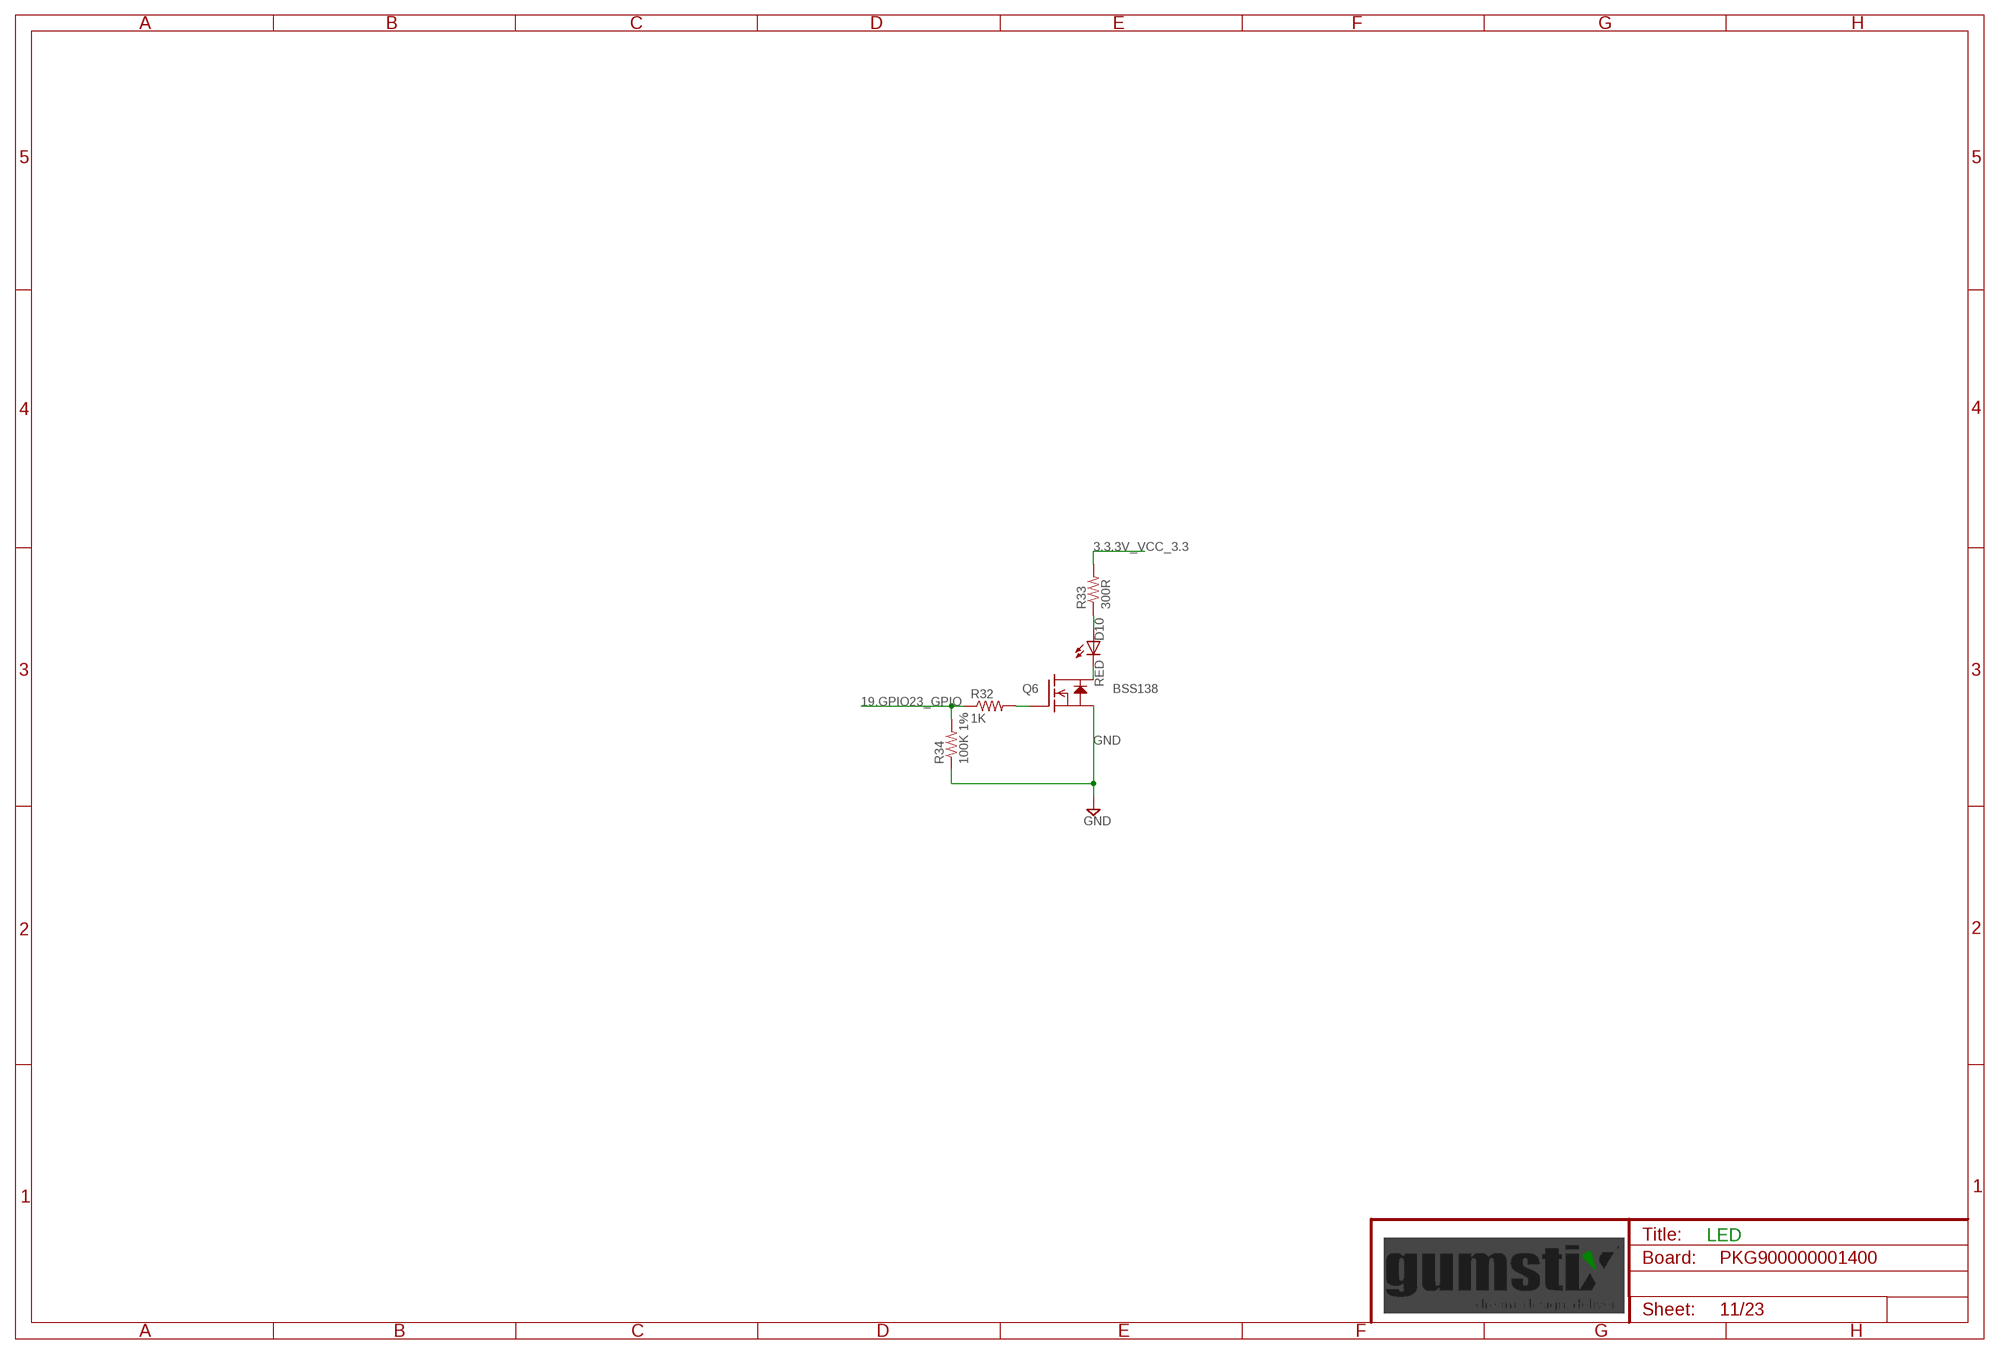
[diagram p10: schematic, sheet 11]

### Parts
D10  RED  LED0603  [D0603]
Q6  BSS138  [SOT23]
R32  1K  R0201  [0201]
R33  300R  R0402  [0402]
R34  100K 1%  R0201  [0201]

### Nets
3.3.3V_VCC_3.3 [supply]: R33.2 ; also sheet 4,7,8,12,18,19,20,21,22,23
19.GPIO23_GPIO: R32.1 R34.2 ; also sheet 16,20
ANODE$14: D10.A R33.1
GATE$14: Q6.1(G) R32.2
GND [supply]: Q6.2(S) R34.1 ; also sheet 2,3,4,5,6,7,8,9,10,12,13,14,15,16,17,18,19,20,21,22,23
LED-$14: D10.C Q6.3(D)

### Notes on the sheet
- LED

## Sheet 12 of 23
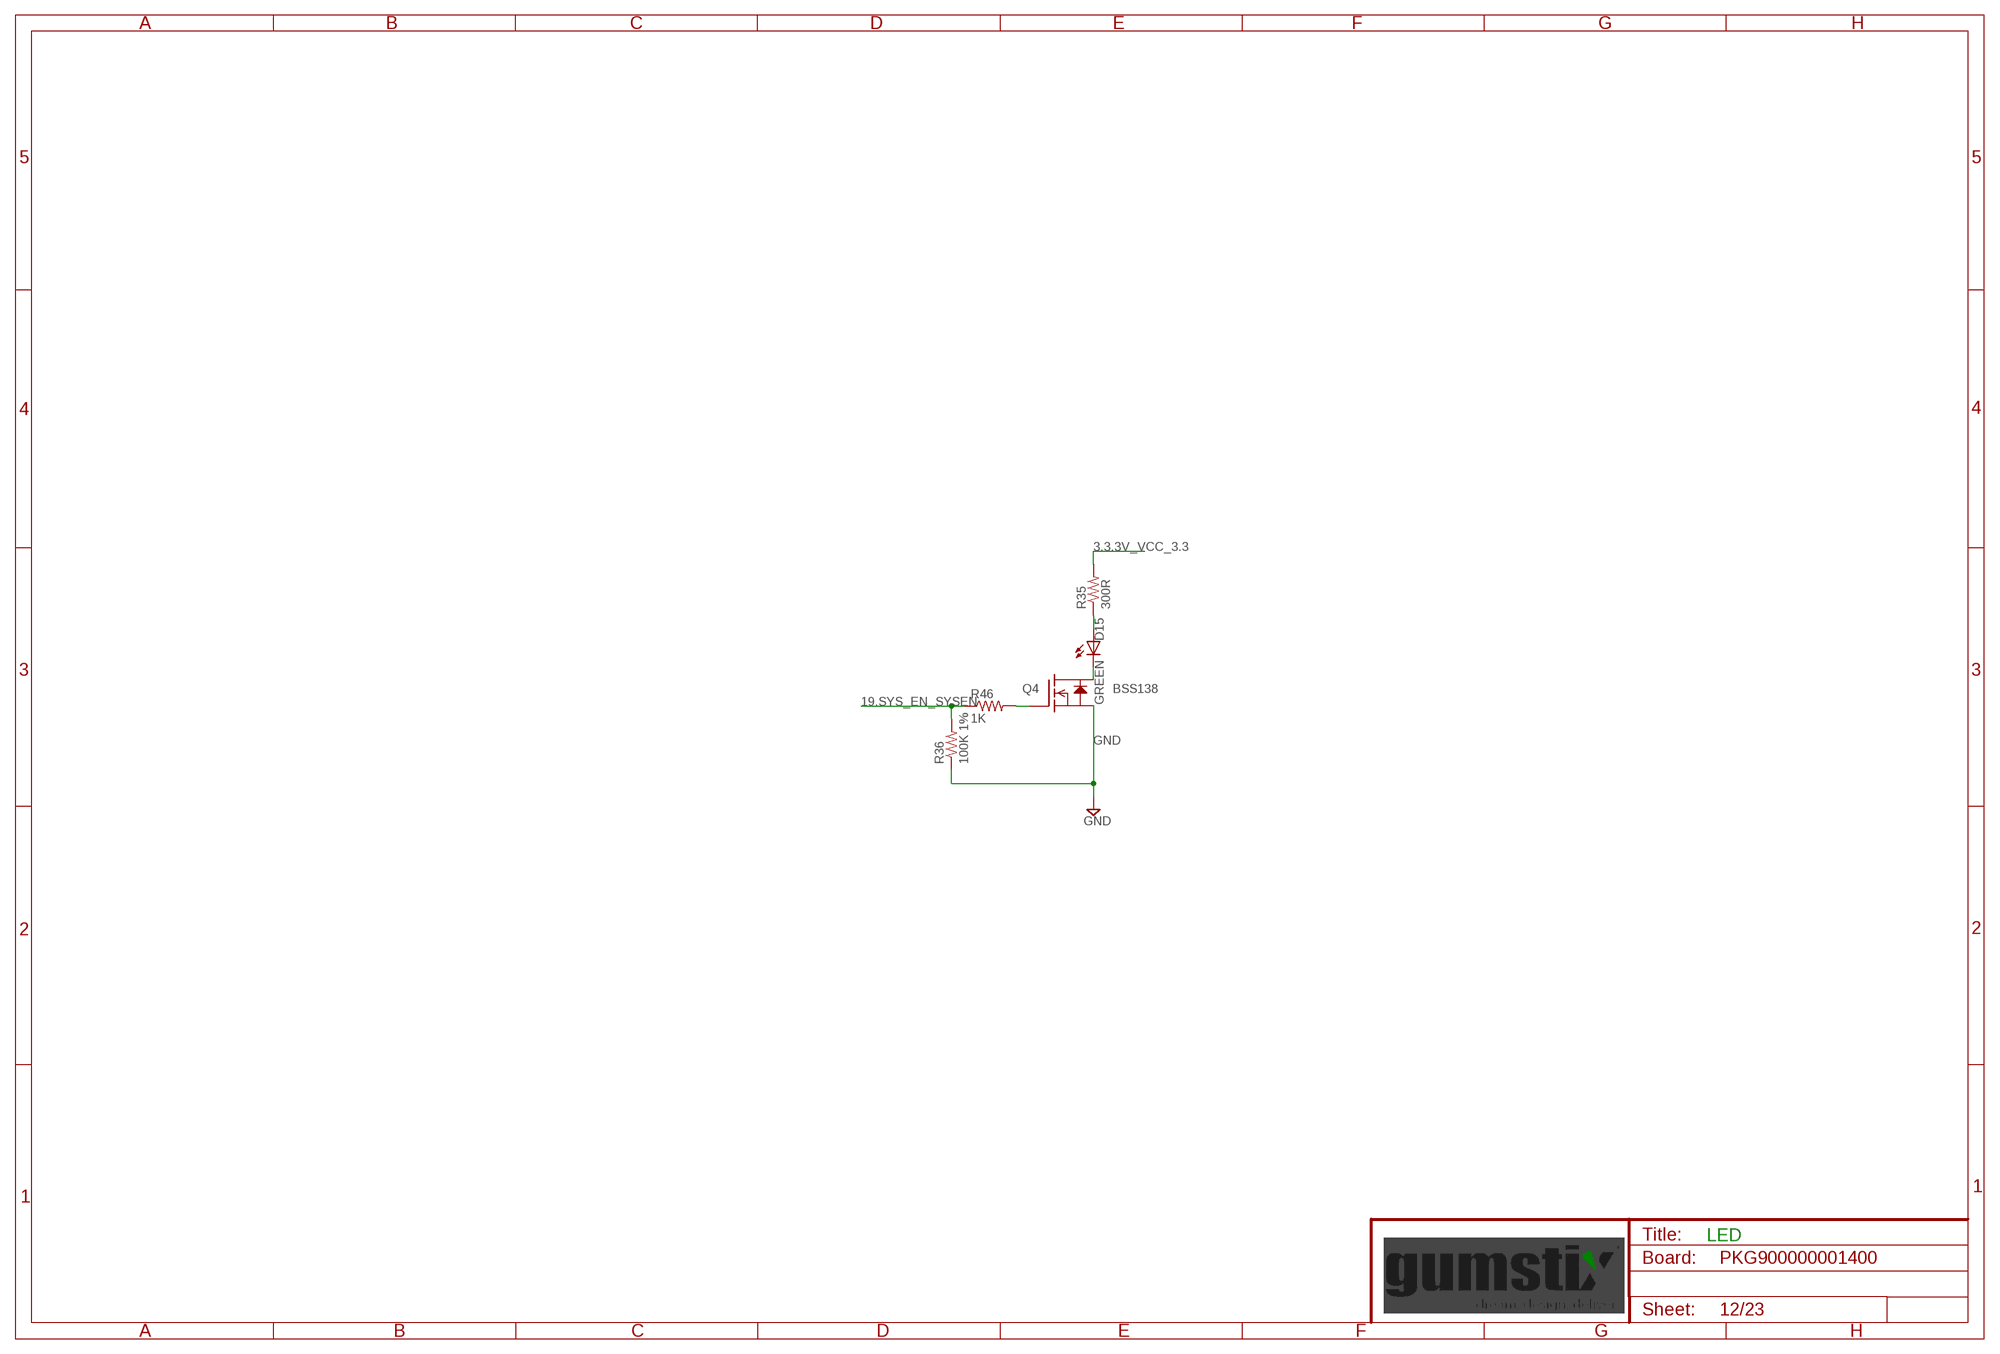
[diagram p11: schematic, sheet 12]

### Parts
D15  GREEN  LED0603  [D0603]
Q4  BSS138  [SOT23]
R35  300R  R0402  [0402]
R36  100K 1%  R0201  [0201]
R46  1K  R0201  [0201]

### Nets
3.3.3V_VCC_3.3 [supply]: R35.2 ; also sheet 4,7,8,11,18,19,20,21,22,23
19.SYS_EN_SYSEN: R36.2 R46.1 ; also sheet 16
ANODE$15: D15.A R35.1
GATE$15: Q4.1(G) R46.2
GND [supply]: Q4.2(S) R36.1 ; also sheet 2,3,4,5,6,7,8,9,10,11,13,14,15,16,17,18,19,20,21,22,23
LED-$15: D15.C Q4.3(D)

### Notes on the sheet
- LED

## Sheet 13 of 23
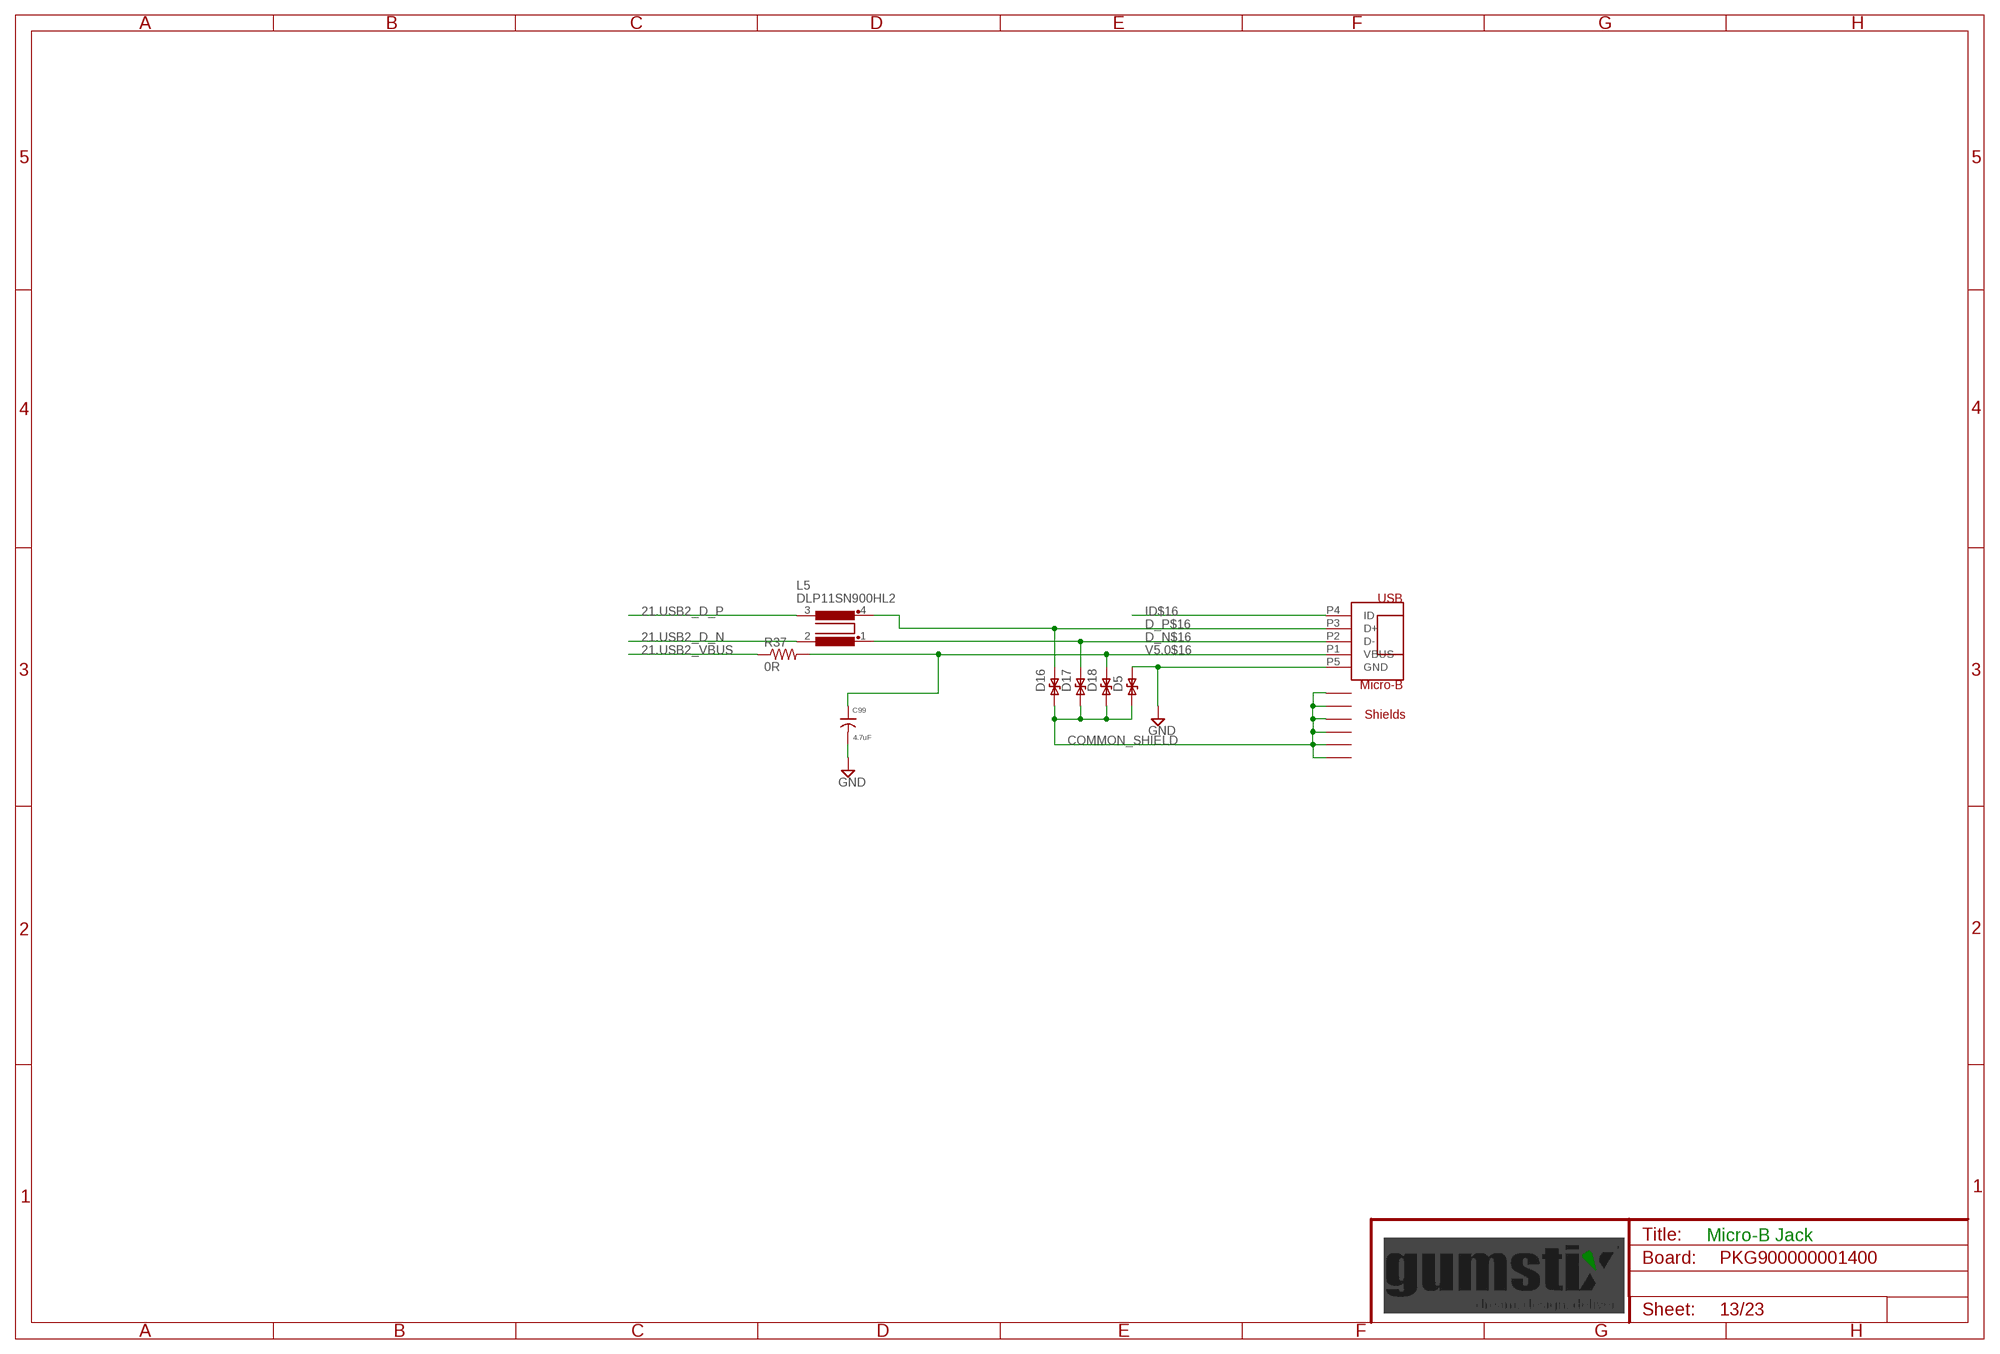
[diagram p12: schematic, sheet 13]

### Parts
C99  4.7uF  C0603  [0603]
D5  B72590D50A060  ESD-DIODE  [D0402]
D16  PS04LTVA1  ESD-DIODE  [D0402]
D17  PS04LTVA1  ESD-DIODE  [D0402]
D18  B72590D50A060  ESD-DIODE  [D0402]
J5  USB_MICRO_B  [USB_MICRO_B]
L5  DLP11SN900HL2  COM_MODE_CHOKE  [0504-DLP11S]
R37  0R  R0201  [0201]

### Nets
21.USB2_D_N [USB]: L5.2 ; also sheet 19
21.USB2_D_P [USB]: L5.3 ; also sheet 19
21.USB2_VBUS [supply]: R37.1 ; also sheet 19
COMMON_SHIELD [supply]: D5.P1 D16.P1 D17.P1 D18.P1 J5.COMMON_SHEILD1(COMMON_SHIELD1) J5.COMMON_SHEILD2(COMMON_SHIELD2) J5.COMMON_SHEILD3(COMMON_SHIELD3) J5.COMMON_SHEILD4(COMMON_SHIELD4) J5.COMMON_SHEILD5(COMMON_SHIELD5) J5.COMMON_SHEILD6(COMMON_SHIELD6) ; also sheet 5,6,8,14,18
D_N$16 [USB]: D17.P2 J5.P2(D-) L5.1
D_P$16 [USB]: D16.P2 J5.P3(D+) L5.4
GND [supply]: C99.2 D5.P2 J5.P5(GND) ; also sheet 2,3,4,5,6,7,8,9,10,11,12,14,15,16,17,18,19,20,21,22,23
ID$16: J5.P4(ID)
V5.0$16 [supply]: C99.1 D18.P2 J5.P1(VBUS) R37.2

### Notes on the sheet
- Micro-B Jack

## Sheet 14 of 23
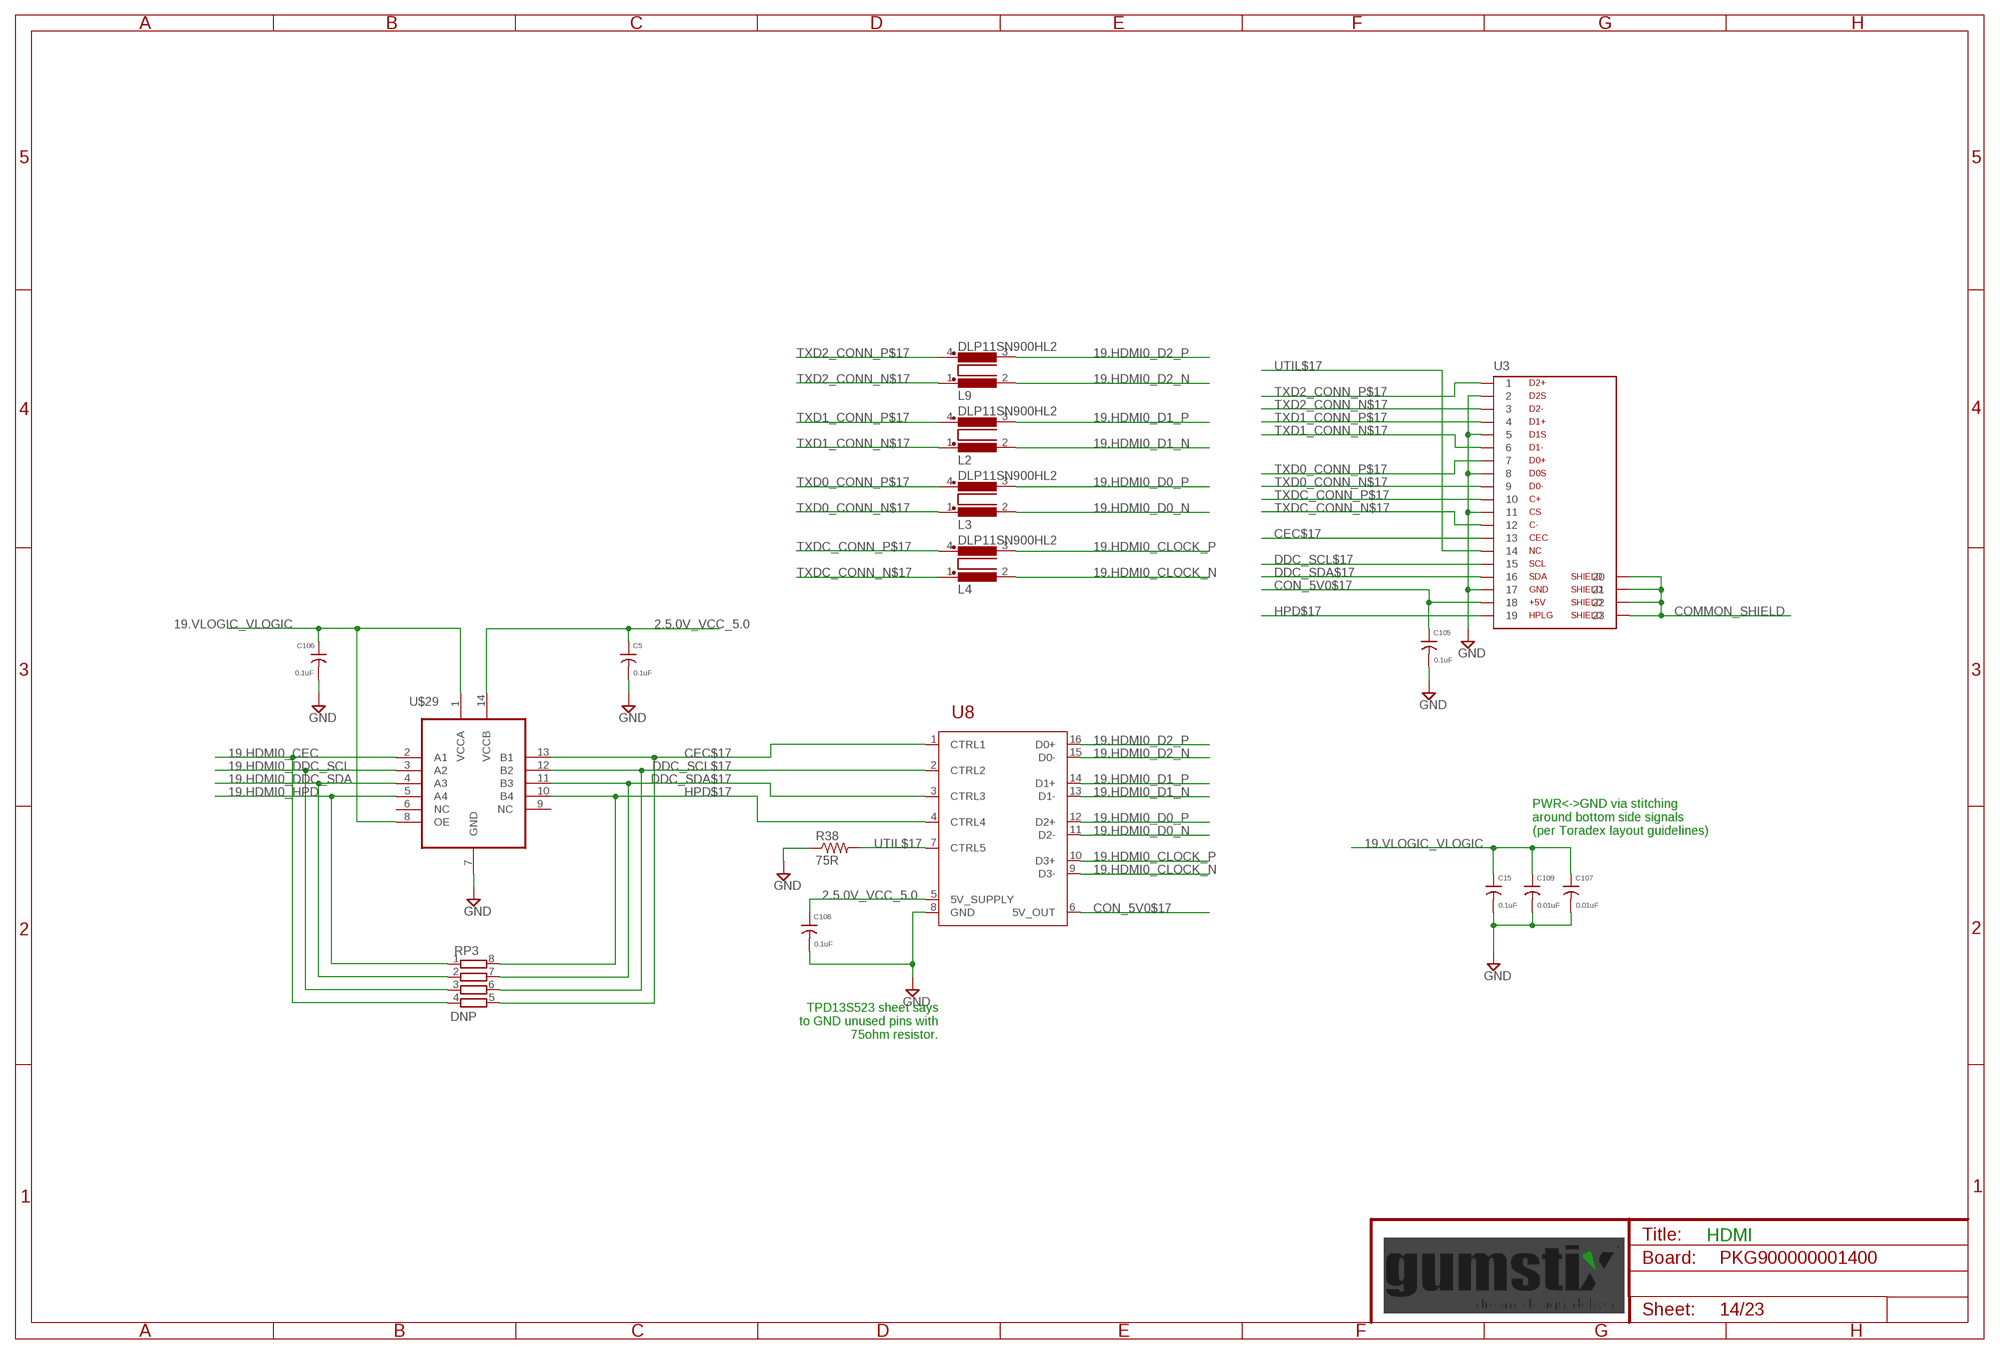
[diagram p13: schematic, sheet 14]

### Parts
C5  0.1uF  C0201  [0201]
C15  0.1uF  C0201  [0201]
C105  0.1uF  C0201  [0201]
C106  0.1uF  C0201  [0201]
C107  0.01uF  C0201  [0201]
C108  0.1uF  C0201  [0201]
C109  0.01uF  C0201  [0201]
L2  DLP11SN900HL2  COM_MODE_CHOKE  [0504-DLP11S]
L3  DLP11SN900HL2  COM_MODE_CHOKE  [0504-DLP11S]
L4  DLP11SN900HL2  COM_MODE_CHOKE  [0504-DLP11S]
L9  DLP11SN900HL2  COM_MODE_CHOKE  [0504-DLP11S]
R38  75R  R0402  [0402]
RP3  DNP  RP741X083741X08  [741X08]
U3  HDMI  [47151-001]
U8  TPD13S523TSSOP  [TSSOP16]
U$29  TXS0104E  [S-PVQFN-N14]

### Nets
2.5.0V_VCC_5.0 [supply]: C5.1 C108.1 U8.5(5V_SUPPLY) U$29.14(VCCB) ; also sheet 3,4,16,18,20
19.HDMI0_CEC: RP3.4 U$29.2(A1) ; also sheet 16
19.HDMI0_CLOCK_N [HDMI]: L4.2 U8.9(D3-) ; also sheet 16
19.HDMI0_CLOCK_P [HDMI]: L4.3 U8.10(D3+) ; also sheet 16
19.HDMI0_D0_N [HDMI]: L3.2 U8.11(D2-) ; also sheet 16
19.HDMI0_D0_P [HDMI]: L3.3 U8.12(D2+) ; also sheet 16
19.HDMI0_D1_N [HDMI]: L2.2 U8.13(D1-) ; also sheet 16
19.HDMI0_D1_P [HDMI]: L2.3 U8.14(D1+) ; also sheet 16
19.HDMI0_D2_N [HDMI]: L9.2 U8.15(D0-) ; also sheet 16
19.HDMI0_D2_P [HDMI]: L9.3 U8.16(D0+) ; also sheet 16
19.HDMI0_DDC_SCL: RP3.3 U$29.3(A2) ; also sheet 16
19.HDMI0_DDC_SDA: RP3.2 U$29.4(A3) ; also sheet 16
19.HDMI0_HPD: RP3.1 U$29.5(A4) ; also sheet 16
19.VLOGIC_VLOGIC [supply]: C15.1 C106.1 C107.1 C109.1 U$29.1(VCCA) U$29.8(OE) ; also sheet 2,9,10,15,16
CEC$17: RP3.5 U3.13 U8.1(CTRL1) U$29.13(B1)
COMMON_SHIELD [supply]: U3.G1 U3.G2 U3.G3 U3.G4 ; also sheet 5,6,8,13,18
CON_5V0$17 [supply]: C105.1 U3.18 U8.6(5V_OUT)
DDC_SCL$17: RP3.6 U3.15 U8.2(CTRL2) U$29.12(B2)
DDC_SDA$17: RP3.7 U3.16 U8.3(CTRL3) U$29.11(B3)
GND [supply]: C5.2 C15.2 C105.2 C106.2 C107.2 C108.2 C109.2 R38.1 U3.2 U3.5 U3.8 U3.11 U3.17 U8.8(GND) U$29.7(GND) ; also sheet 2,3,4,5,6,7,8,9,10,11,12,13,15,16,17,18,19,20,21,22,23
HPD$17: RP3.8 U3.19 U8.4(CTRL4) U$29.10(B4)
TXD0_CONN_N$17 [HDMI]: L3.1 U3.9
TXD0_CONN_P$17 [HDMI]: L3.4 U3.7
TXD1_CONN_N$17 [HDMI]: L2.1 U3.6
TXD1_CONN_P$17 [HDMI]: L2.4 U3.4
TXD2_CONN_N$17 [HDMI]: L9.1 U3.3
TXD2_CONN_P$17 [HDMI]: L9.4 U3.1
TXDC_CONN_N$17 [HDMI]: L4.1 U3.12
TXDC_CONN_P$17 [HDMI]: L4.4 U3.10
UTIL$17: R38.2 U3.14 U8.7(CTRL5)
Unconnected: U$29.6(NC) U$29.9(NC)

### Notes on the sheet
- PWR<->GND via stitching
  around bottom side signals
  (per Toradex layout guidelines)
- TPD13S523 sheet says
  to GND unused pins with
  75ohm resistor.
- HDMI

## Sheet 15 of 23
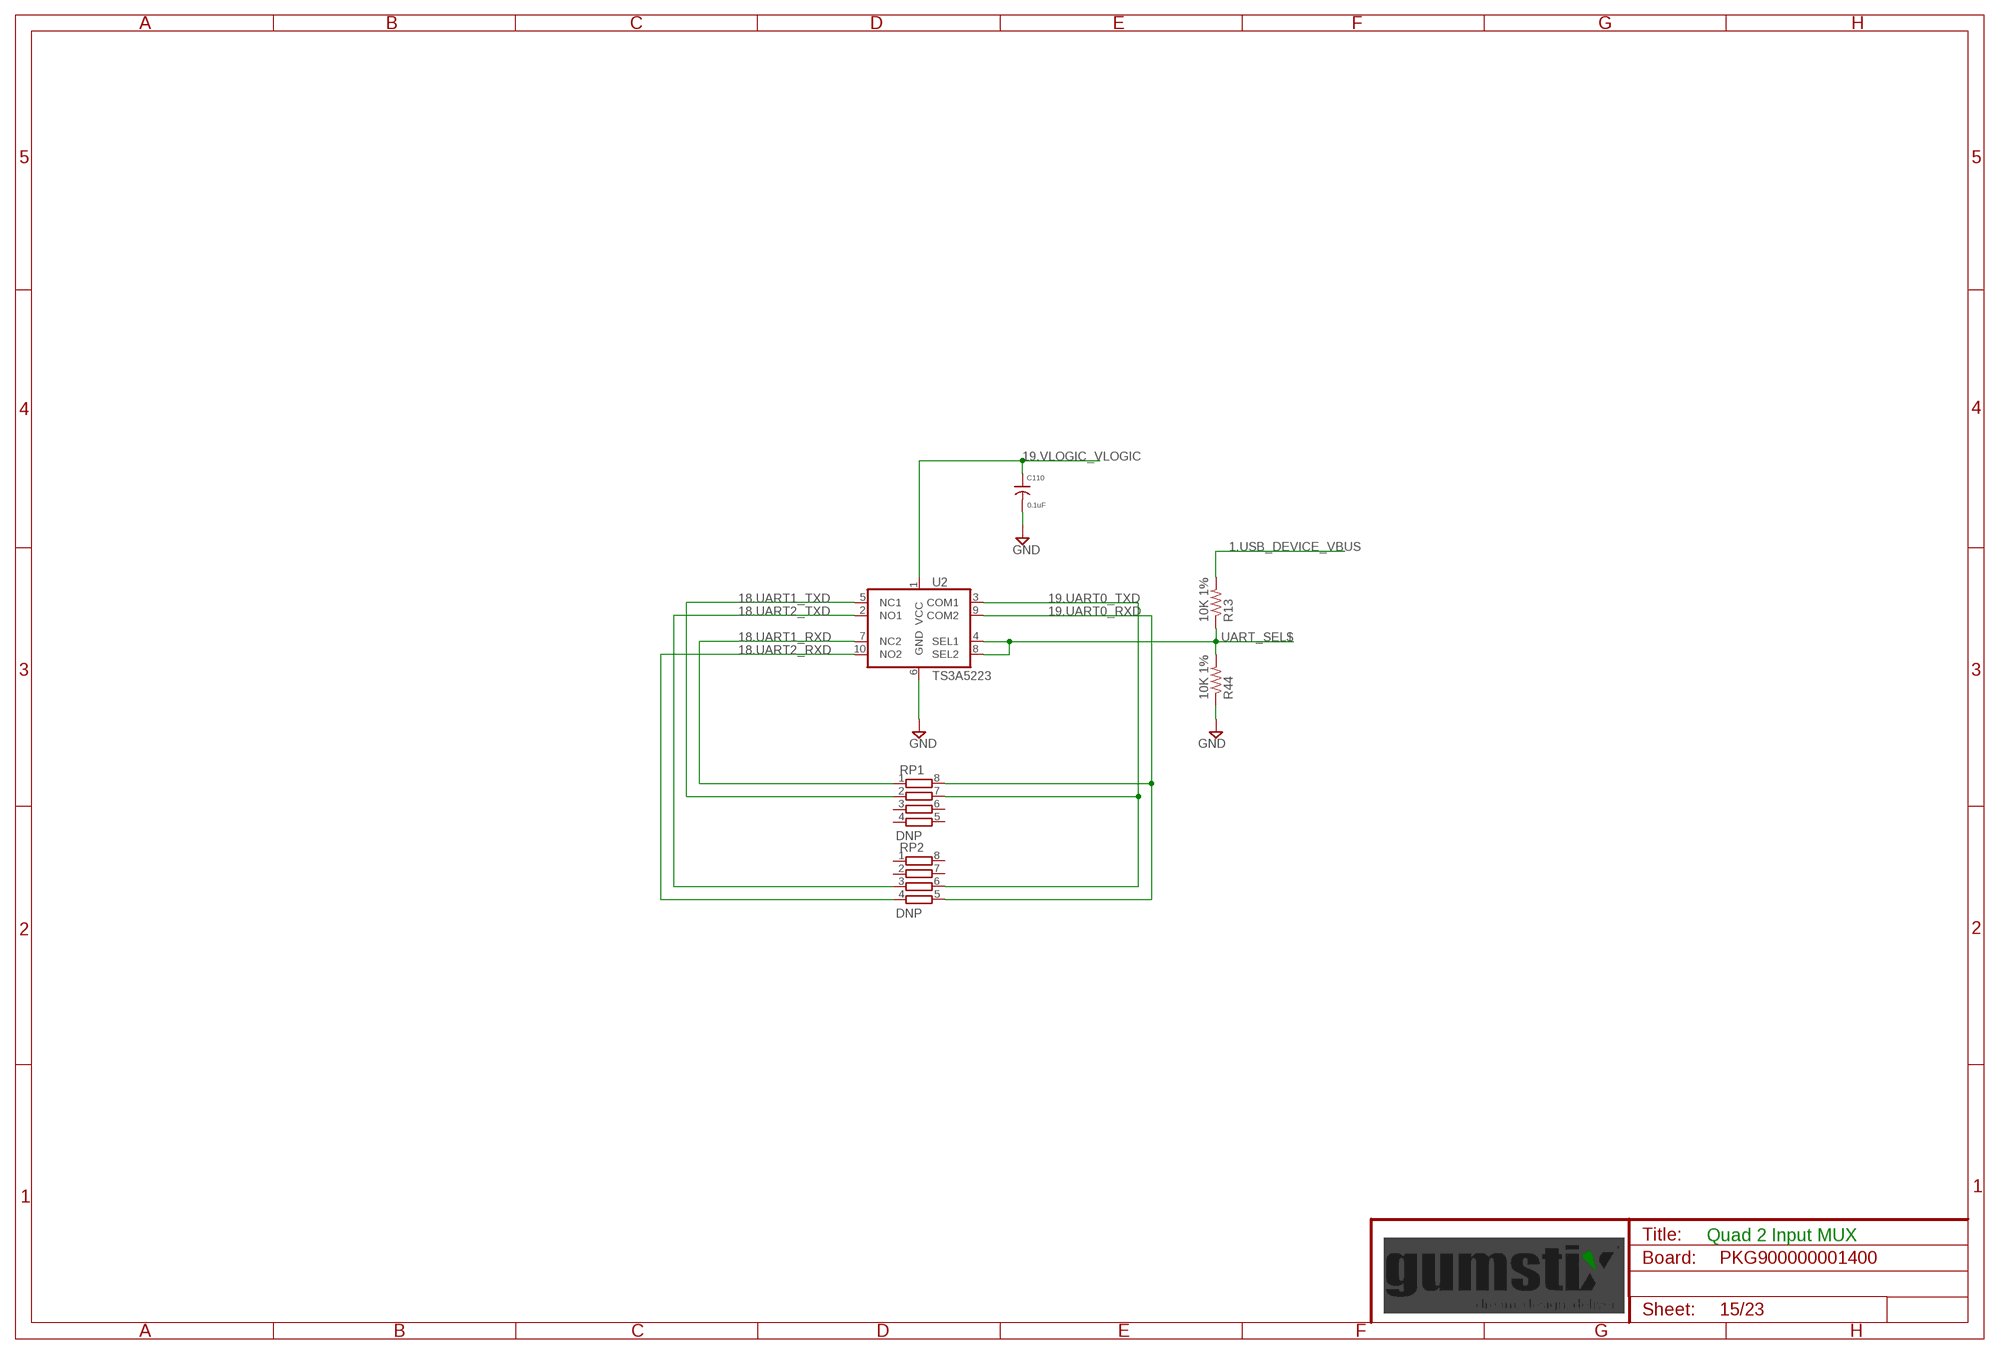
[diagram p14: schematic, sheet 15]

### Parts
C110  0.1uF  C0201  [0201]
R13  10K 1%  R0201  [0201]
R44  10K 1%  R0201  [0201]
RP1  DNP  RP741X083  [RP741X083]
RP2  DNP  RP741X083  [RP741X083]
U2  TS3A5223  [UQFN-10]

### Nets
1.USB_DEVICE_VBUS [supply]: R13.2 ; also sheet 2,5
18.UART1_RXD: RP1.1 U2.7(NC2) ; also sheet 20
18.UART1_TXD: RP1.2 U2.5(NC1) ; also sheet 20
18.UART2_RXD: RP2.4 U2.10(NO2) ; also sheet 2
18.UART2_TXD: RP2.3 U2.2(NO1) ; also sheet 2
19.UART0_RXD: RP1.8 RP2.5 U2.9(COM2) ; also sheet 16
19.UART0_TXD: RP1.7 RP2.6 U2.3(COM1) ; also sheet 16
19.VLOGIC_VLOGIC [supply]: C110.1 U2.1(VCC) ; also sheet 2,9,10,14,16
GND [supply]: C110.2 R44.1 U2.6(GND) ; also sheet 2,3,4,5,6,7,8,9,10,11,12,13,14,16,17,18,19,20,21,22,23
UART_SEL$: R13.1 R44.2 U2.4(SEL1) U2.8(SEL2)
Unconnected: RP1.3 RP1.4 RP1.5 RP1.6 RP2.1 RP2.2 RP2.7 RP2.8

### Notes on the sheet
- Quad 2 Input MUX

## Sheet 16 of 23
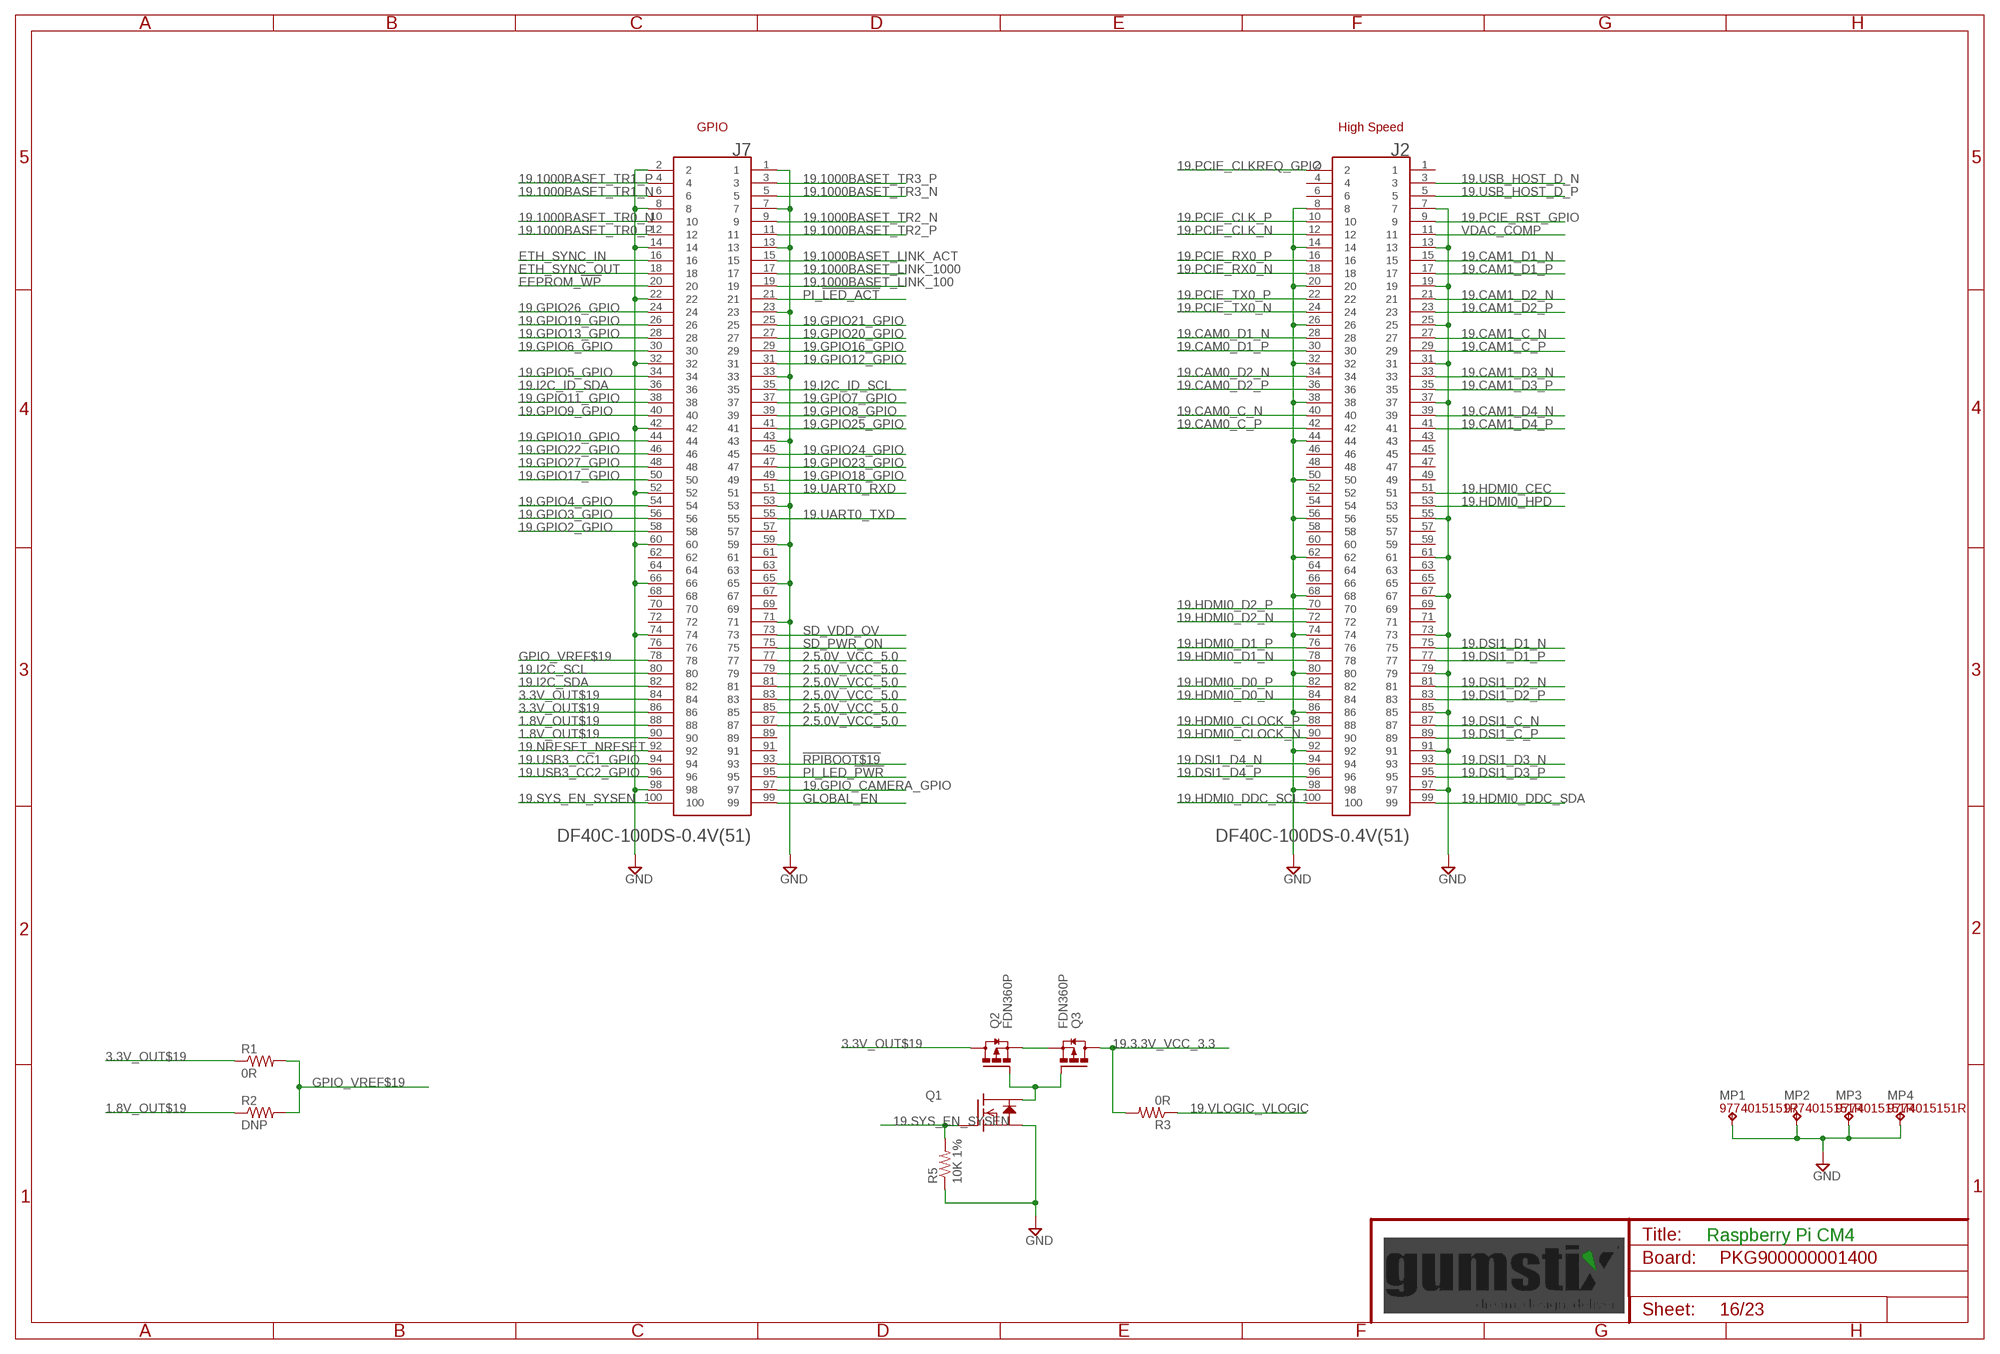
[diagram p15: schematic, sheet 16]

### Parts
J2  DF40C-100DS-0.4V(51)  [HRS_DF40C-100DS-0.4V(51)]
J7  DF40C-100DS-0.4V(51)  [HRS_DF40C-100DS-0.4V(51)]
MP1  9774015151R  BULLET_CONN2.5MM  [WA-SMSI_9774___151]
MP2  9774015151R  BULLET_CONN2.5MM  [WA-SMSI_9774___151]
MP3  9774015151R  BULLET_CONN2.5MM  [WA-SMSI_9774___151]
MP4  9774015151R  BULLET_CONN2.5MM  [WA-SMSI_9774___151]
Q1  BSS138  [SOT23]
Q2  FDN360P  MOSFET_P_ENH  [SOT23]
Q3  FDN360P  MOSFET_P_ENH  [SOT23]
R1  0R  R0201  [0201]
R2  DNP  R0201  [0201]
R3  0R  R0201  [0201]
R5  10K 1%  R0201  [0201]

### Nets
1.8V_OUT$19 [supply]: J7.88 J7.90 R2.1
2.5.0V_VCC_5.0 [supply]: J7.77 J7.79 J7.81 J7.83 J7.85 J7.87 ; also sheet 3,4,14,18,20
3.3V_OUT$19 [supply]: J7.84 J7.86 Q2.3(D) R1.1
19.3.3V_VCC_3.3 [supply]: Q3.3(D) R3.2
19.1000BASET_LINK_100: J7.19
19.1000BASET_LINK_1000: J7.17 ; also sheet 8
19.1000BASET_LINK_ACT: J7.15 ; also sheet 8
19.1000BASET_TR0_N [HDMI]: J7.10 ; also sheet 8
19.1000BASET_TR0_P [HDMI]: J7.12 ; also sheet 8
19.1000BASET_TR1_N [HDMI]: J7.6 ; also sheet 8
19.1000BASET_TR1_P [HDMI]: J7.4 ; also sheet 8
19.1000BASET_TR2_N [HDMI]: J7.9 ; also sheet 8
19.1000BASET_TR2_P [HDMI]: J7.11 ; also sheet 8
19.1000BASET_TR3_N [HDMI]: J7.5 ; also sheet 8
19.1000BASET_TR3_P [HDMI]: J7.3 ; also sheet 8
19.CAM0_C_N [HDMI]: J2.40 ; also sheet 22
19.CAM0_C_P [HDMI]: J2.42 ; also sheet 22
19.CAM0_D1_N [HDMI]: J2.28 ; also sheet 22
19.CAM0_D1_P [HDMI]: J2.30 ; also sheet 22
19.CAM0_D2_N [HDMI]: J2.34 ; also sheet 22
19.CAM0_D2_P [HDMI]: J2.36 ; also sheet 22
19.CAM1_C_N [HDMI]: J2.27 ; also sheet 21
19.CAM1_C_P [HDMI]: J2.29 ; also sheet 21
19.CAM1_D1_N [HDMI]: J2.15 ; also sheet 21
19.CAM1_D1_P [HDMI]: J2.17 ; also sheet 21
19.CAM1_D2_N [HDMI]: J2.21 ; also sheet 21
19.CAM1_D2_P [HDMI]: J2.23 ; also sheet 21
19.CAM1_D3_N [HDMI]: J2.33
19.CAM1_D3_P [HDMI]: J2.35
19.CAM1_D4_N [HDMI]: J2.39
19.CAM1_D4_P [HDMI]: J2.41
19.DSI1_C_N [HDMI]: J2.87 ; also sheet 23
19.DSI1_C_P [HDMI]: J2.89 ; also sheet 23
19.DSI1_D1_N [HDMI]: J2.75 ; also sheet 23
19.DSI1_D1_P [HDMI]: J2.77 ; also sheet 23
19.DSI1_D2_N [HDMI]: J2.81 ; also sheet 23
19.DSI1_D2_P [HDMI]: J2.83 ; also sheet 23
19.DSI1_D3_N [HDMI]: J2.93
19.DSI1_D3_P [HDMI]: J2.95
19.DSI1_D4_N [HDMI]: J2.94
19.DSI1_D4_P [HDMI]: J2.96
19.GPIO2_GPIO: J7.58 ; also sheet 20
19.GPIO3_GPIO: J7.56 ; also sheet 20
19.GPIO4_GPIO: J7.54 ; also sheet 20
19.GPIO5_GPIO: J7.34 ; also sheet 20
19.GPIO6_GPIO: J7.30 ; also sheet 20
19.GPIO7_GPIO: J7.37 ; also sheet 20
19.GPIO8_GPIO: J7.39 ; also sheet 20
19.GPIO9_GPIO: J7.40 ; also sheet 20
19.GPIO10_GPIO: J7.44 ; also sheet 20
19.GPIO11_GPIO: J7.38 ; also sheet 20
19.GPIO12_GPIO: J7.31 ; also sheet 20
19.GPIO13_GPIO: J7.28 ; also sheet 20
19.GPIO16_GPIO: J7.29 ; also sheet 20
19.GPIO17_GPIO: J7.50 ; also sheet 20
19.GPIO18_GPIO: J7.49 ; also sheet 20
19.GPIO19_GPIO: J7.26 ; also sheet 20
19.GPIO20_GPIO: J7.27 ; also sheet 20
19.GPIO21_GPIO: J7.25 ; also sheet 20
19.GPIO22_GPIO: J7.46 ; also sheet 20
19.GPIO23_GPIO: J7.47 ; also sheet 11,20
19.GPIO24_GPIO: J7.45 ; also sheet 10,20
19.GPIO25_GPIO: J7.41 ; also sheet 20
19.GPIO26_GPIO: J7.24 ; also sheet 20
19.GPIO27_GPIO: J7.48 ; also sheet 20
19.GPIO_CAMERA_GPIO: J7.97 ; also sheet 21,22
19.HDMI0_CEC: J2.51 ; also sheet 14
19.HDMI0_CLOCK_N [HDMI]: J2.90 ; also sheet 14
19.HDMI0_CLOCK_P [HDMI]: J2.88 ; also sheet 14
19.HDMI0_D0_N [HDMI]: J2.84 ; also sheet 14
19.HDMI0_D0_P [HDMI]: J2.82 ; also sheet 14
19.HDMI0_D1_N [HDMI]: J2.78 ; also sheet 14
19.HDMI0_D1_P [HDMI]: J2.76 ; also sheet 14
19.HDMI0_D2_N [HDMI]: J2.72 ; also sheet 14
19.HDMI0_D2_P [HDMI]: J2.70 ; also sheet 14
19.HDMI0_DDC_SCL: J2.100 ; also sheet 14
19.HDMI0_DDC_SDA: J2.99 ; also sheet 14
19.HDMI0_HPD: J2.53 ; also sheet 14
19.I2C_ID_SCL: J7.35 ; also sheet 17,22
19.I2C_ID_SDA: J7.36 ; also sheet 17,22
19.I2C_SCL: J7.80 ; also sheet 21,23
19.I2C_SDA: J7.82 ; also sheet 21,23
19.NRESET_NRESET: J7.92 ; also sheet 9
19.PCIE_CLK_N [USB]: J2.12 ; also sheet 7
19.PCIE_CLK_P [USB]: J2.10 ; also sheet 7
19.PCIE_CLKREQ_GPIO: J2.2 ; also sheet 7
19.PCIE_RST_GPIO: J2.9 ; also sheet 7
19.PCIE_RX0_N [USB]: J2.18 ; also sheet 7
19.PCIE_RX0_P [USB]: J2.16 ; also sheet 7
19.PCIE_TX0_N [USB]: J2.24 ; also sheet 7
19.PCIE_TX0_P [USB]: J2.22 ; also sheet 7
19.SYS_EN_SYSEN: J7.100 Q1.1(G) R5.2 ; also sheet 12
19.UART0_RXD: J7.51 ; also sheet 15
19.UART0_TXD: J7.55 ; also sheet 15
19.USB3_CC1_GPIO: J7.94
19.USB3_CC2_GPIO: J7.96
19.USB_HOST_D_N [USB]: J2.3 ; also sheet 19
19.USB_HOST_D_P [USB]: J2.5 ; also sheet 19
19.VLOGIC_VLOGIC [supply]: R3.1 ; also sheet 2,9,10,14,15
!RPIBOOT$19: J7.93 ; also sheet 17
DS_LOAD$19 [supply]: Q2.2(S) Q3.2(S)
EEPROM_!WP: J7.20
ETH_SYNC_IN: J7.16
ETH_SYNC_OUT: J7.18
GLOBAL_EN: J7.99
GND [supply]: J2.7 J2.8 J2.13 J2.14 J2.19 J2.20 J2.25 J2.26 J2.31 J2.32 J2.37 J2.38 J2.44 J2.50 J2.55 J2.56 J2.61 J2.62 J2.67 J2.68 J2.73 J2.74 J2.79 J2.80 J2.85 J2.86 J2.91 J2.92 J2.97 J2.98 J7.1 J7.2 J7.7 J7.8 J7.13 J7.14 J7.22 J7.23 J7.32 J7.33 J7.42 J7.43 J7.52 J7.53 J7.59 J7.60 J7.65 J7.66 J7.71 J7.74 J7.98 MP1.1(TP) MP2.1(TP) MP3.1(TP) MP4.1(TP) Q1.2(S) R5.1 ; also sheet 2,3,4,5,6,7,8,9,10,11,12,13,14,15,17,18,19,20,21,22,23
GPIO_VREF$19 [supply]: J7.78 R1.2 R2.2 ; also sheet 17
LOAD_GATE$19: Q1.3(D) Q2.1(G) Q3.1(G)
PI_!LED_ACT: J7.21
PI_LED_!PWR: J7.95
SD_PWR_ON: J7.75
SD_VDD_OV: J7.73
VDAC_COMP: J2.11
Unconnected: J2.1 J2.4 J2.6 J2.43 J2.45 J2.46 J2.47 J2.48 J2.49 J2.52 J2.54 J2.57 J2.58 J2.59 J2.60 J2.63 J2.64 J2.65 J2.66 J2.69 J2.71 J7.57 J7.61 J7.62 J7.63 J7.64 J7.67 J7.68 J7.69 J7.70 J7.72 J7.76 J7.89 J7.91

### Notes on the sheet
- GPIO | High Speed
- Raspberry Pi CM4

## Sheet 17 of 23
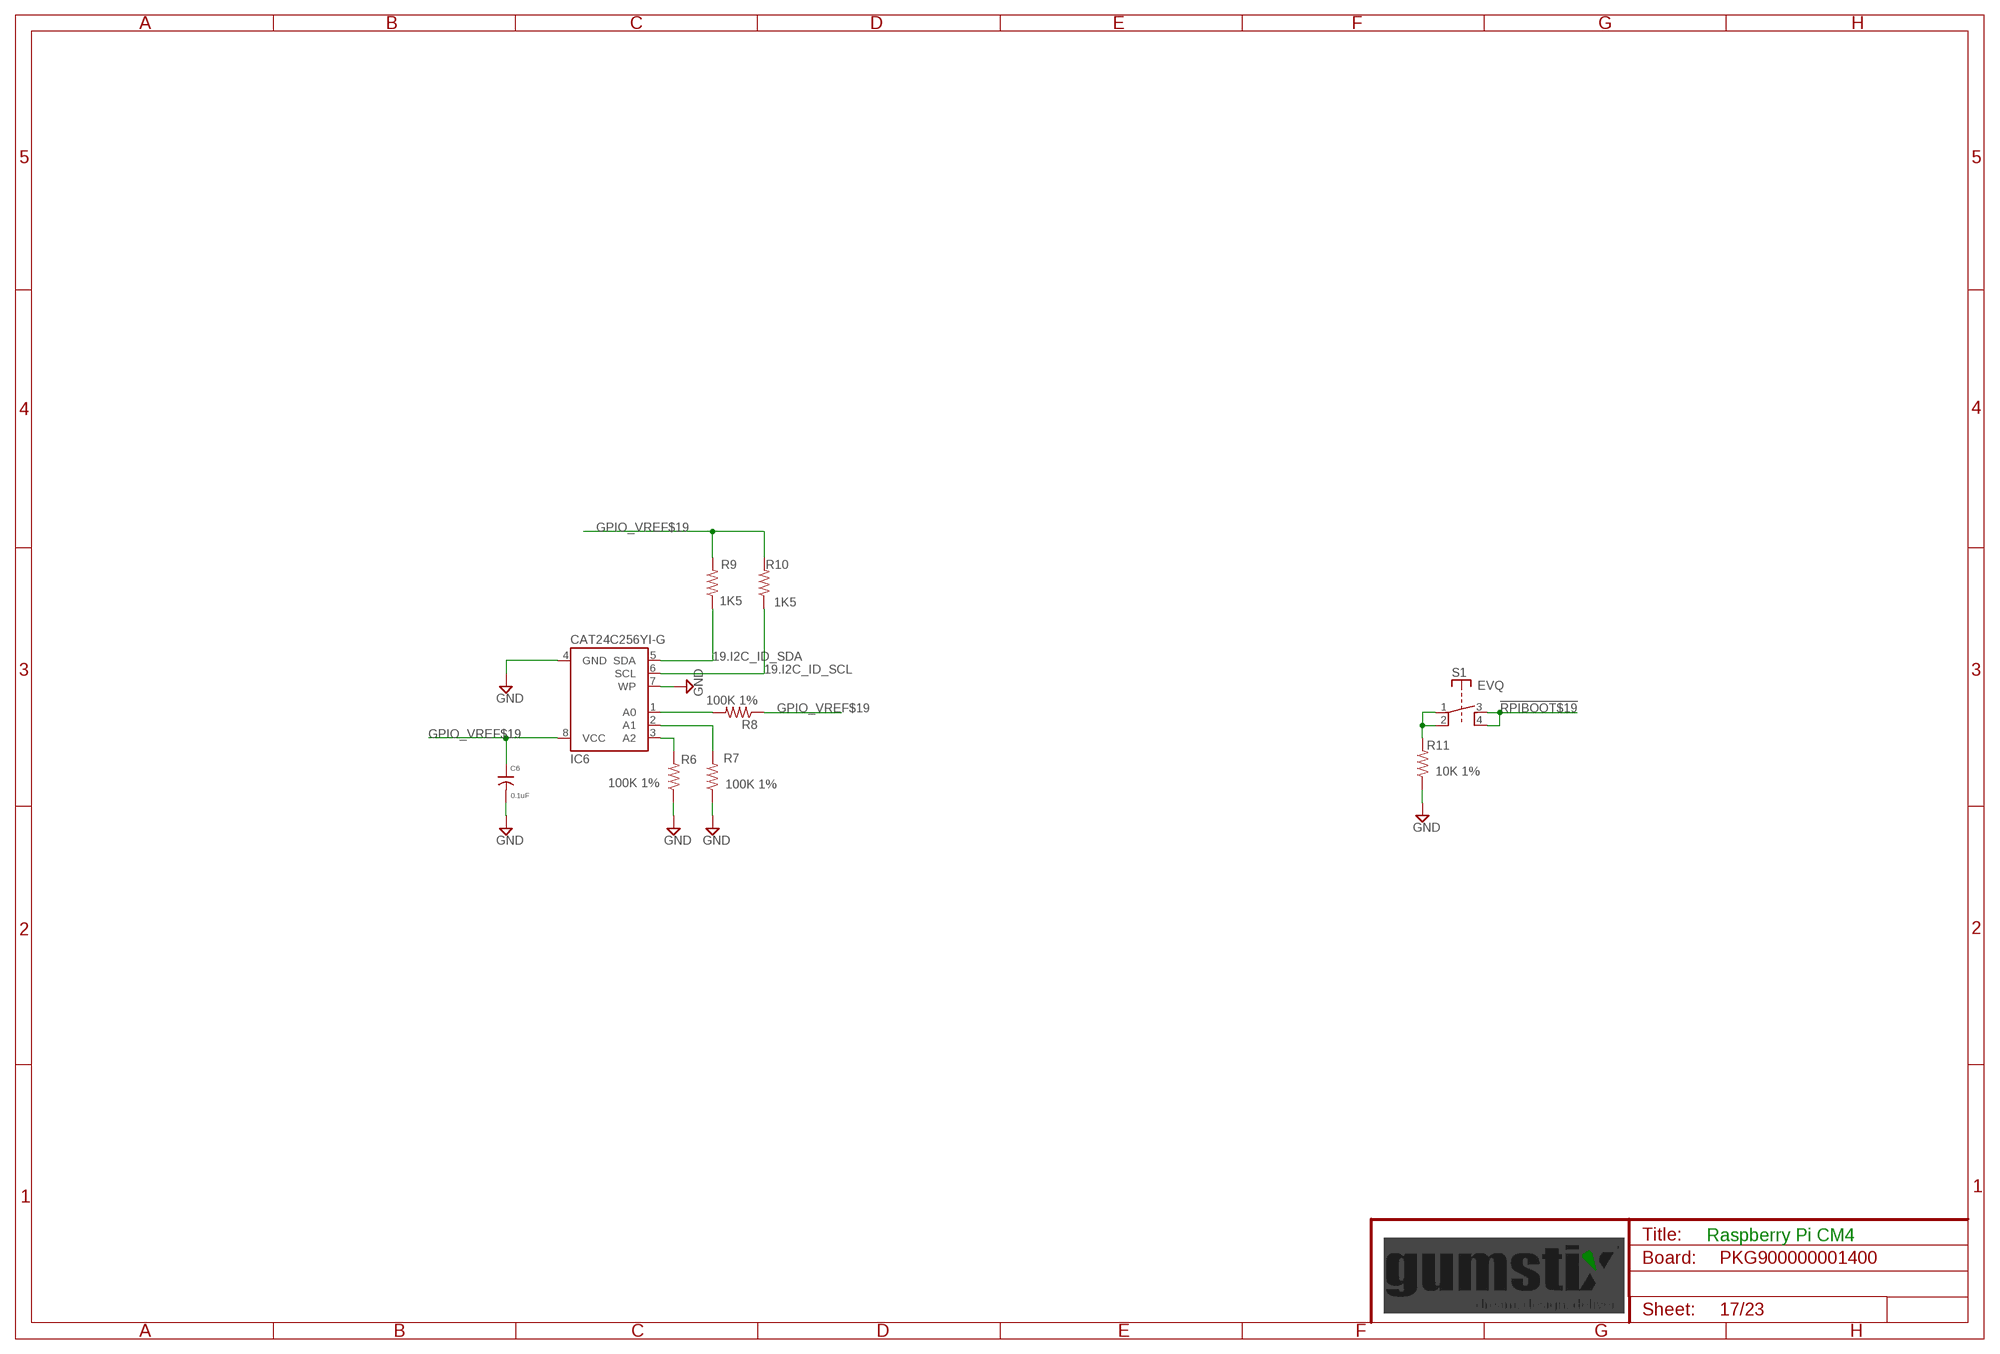
[diagram p16: schematic, sheet 17]

### Parts
C6  0.1uF  C0201  [0201]
IC6  CAT24C256YI-G  AT24CA  [TSSOP8]
R6  100K 1%  R0201  [0201]
R7  100K 1%  R0201  [0201]
R8  100K 1%  R0201  [0201]
R9  1K5  R0201  [0201]
R10  1K5  R0201  [0201]
R11  10K 1%  R0201  [0201]
S1  EVQ  EVQKMT0  [KMT0]

### Nets
19.I2C_ID_SCL: IC6.6(SCL) R10.1 ; also sheet 16,22
19.I2C_ID_SDA: IC6.5(SDA) R9.1 ; also sheet 16,22
!RPIBOOT$19: S1.3(B) S1.4(B') ; also sheet 16
A0$19: IC6.1(A0) R8.2
A1$19: IC6.2(A1) R7.2
A2$19: IC6.3(A2) R6.2
GND [supply]: C6.2 IC6.4(GND) IC6.7(WP) R6.1 R7.1 R11.1 ; also sheet 2,3,4,5,6,7,8,9,10,11,12,13,14,15,16,18,19,20,21,22,23
GPIO_VREF$19 [supply]: C6.1 IC6.8(VCC) R8.1 R9.2 R10.2 ; also sheet 16
RPIBOOT_SWITCH$19: R11.2 S1.1(A) S1.2(A')

### Notes on the sheet
- Raspberry Pi CM4

## Sheet 18 of 23
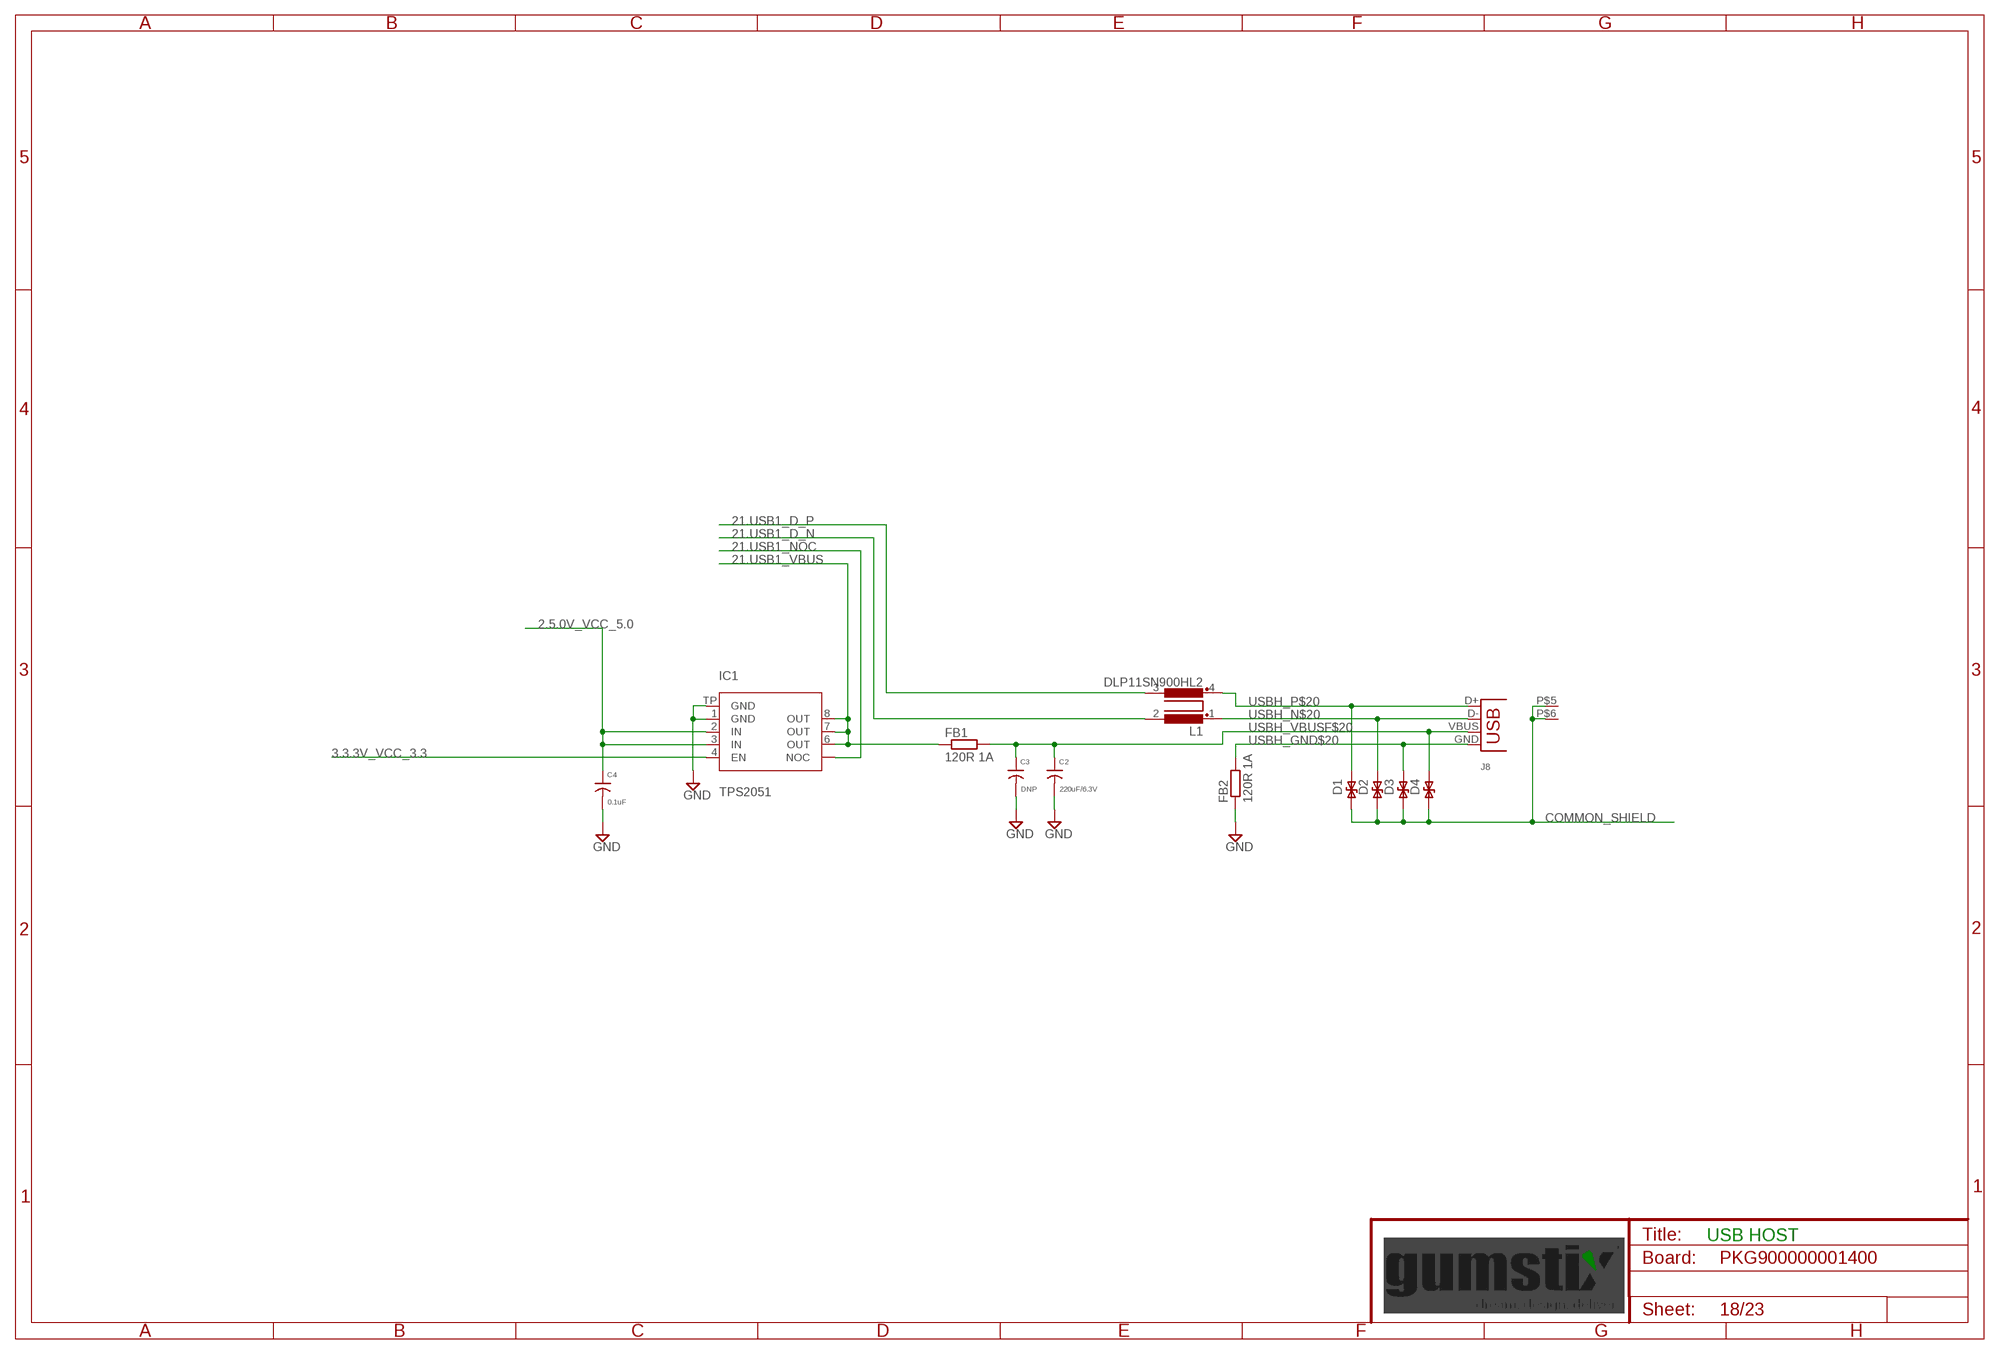
[diagram p17: schematic, sheet 18]

### Parts
C2  220uF/6.3V  C1206  [1206]
C3  DNP  C1206  [1206]
C4  0.1uF  C0201  [0201]
D1  PS04LTVA1  ESD-DIODE  [D0402]
D2  PS04LTVA1  ESD-DIODE  [D0402]
D3  B72590D50A060  ESD-DIODE  [D0402]
D4  B72590D50A060  ESD-DIODE  [D0402]
FB1  120R 1A  FB0402  [0402]
FB2  120R 1A  FB0402  [0402]
IC1  TPS2051  [MSOP8-PAD]
J8  USB-A-S  USB-A-S-A-S  [USB-A-S]
L1  DLP11SN900HL2  COM_MODE_CHOKE  [0504-DLP11S]

### Nets
2.5.0V_VCC_5.0 [supply]: C4.1 IC1.2(IN) IC1.3(IN) ; also sheet 3,4,14,16,20
3.3.3V_VCC_3.3 [supply]: IC1.4(EN) ; also sheet 4,7,8,11,12,19,20,21,22,23
21.USB1_D_N [USB]: L1.2 ; also sheet 19
21.USB1_D_P [USB]: L1.3 ; also sheet 19
21.USB1_NOC: IC1.5(NOC) ; also sheet 19
21.USB1_VBUS [supply]: FB1.1 IC1.6(OUT) IC1.7(OUT) IC1.8(OUT) ; also sheet 19
COMMON_SHIELD [supply]: D1.P1 D2.P1 D3.P1 D4.P1 J8.P$5(P1) J8.P$6(P2) ; also sheet 5,6,8,13,14
GND [supply]: C2.2 C3.2 C4.2 FB2.1 IC1.1(GND) IC1.TP(GND) ; also sheet 2,3,4,5,6,7,8,9,10,11,12,13,14,15,16,17,19,20,21,22,23
USBH_GND$20 [supply]: D3.P2 FB2.2 J8.GND
USBH_N$20 [USB]: D2.P2 J8.D- L1.1
USBH_P$20 [USB]: D1.P2 J8.D+(VBUS) L1.4
USBH_VBUSF$20 [supply]: C2.1 C3.1 D4.P2 FB1.2 J8.VBUS(D+)

### Notes on the sheet
- USB HOST

## Sheet 19 of 23
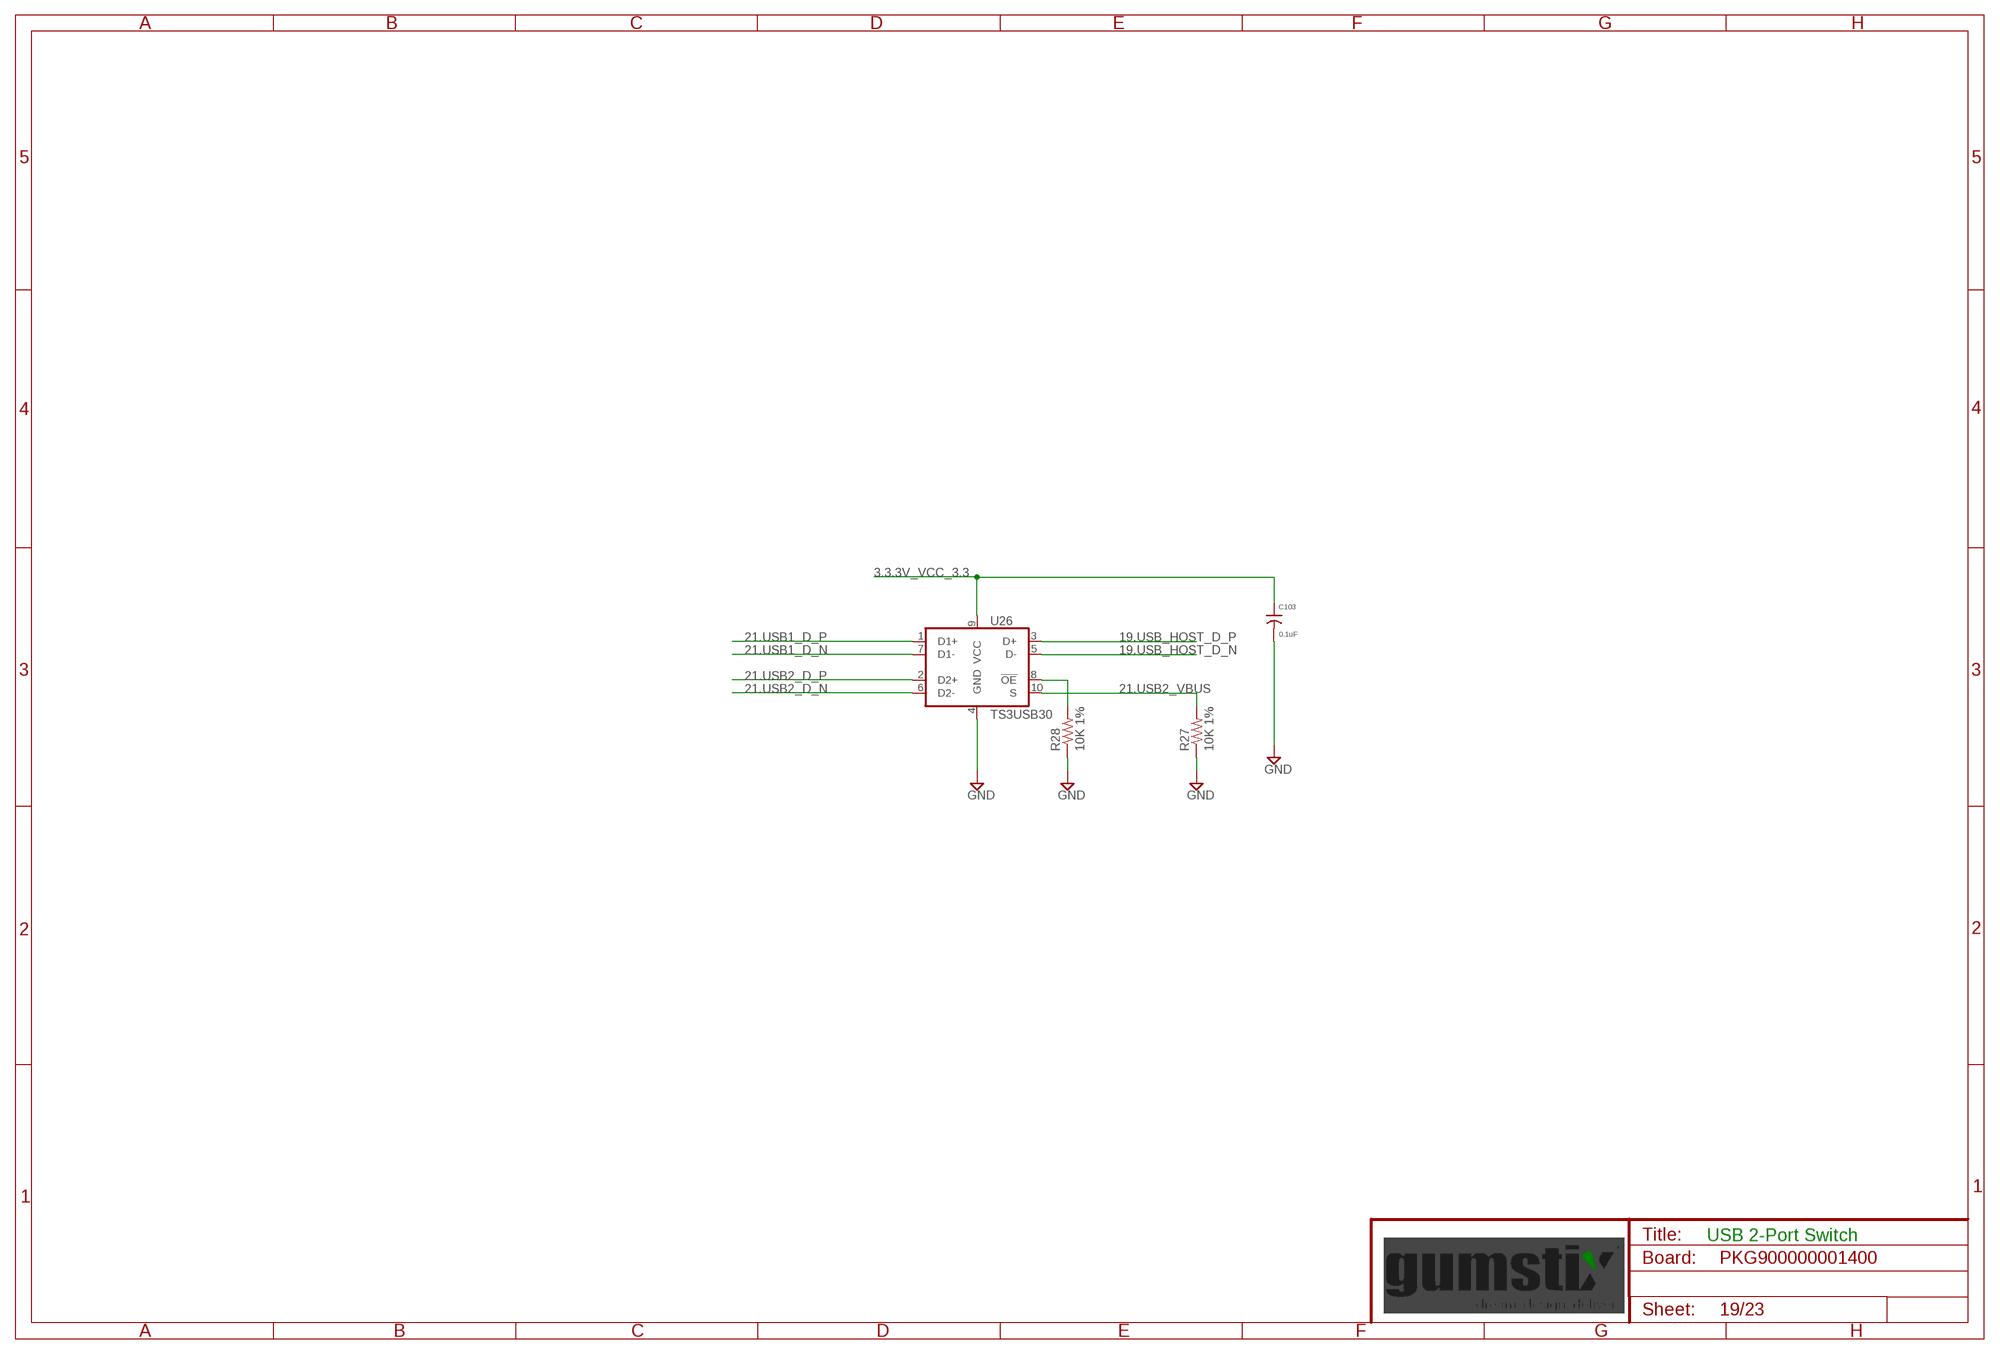
[diagram p18: schematic, sheet 19]

### Parts
C103  0.1uF  C0201  [0201]
R27  10K 1%  R0201  [0201]
R28  10K 1%  R0201  [0201]
U26  TS3USB30  TS3USB30WQ  [UQFN-10]

### Nets
3.3.3V_VCC_3.3 [supply]: C103.1 U26.9(VCC) ; also sheet 4,7,8,11,12,18,20,21,22,23
19.USB_HOST_D_N [USB]: U26.5(D-) ; also sheet 16
19.USB_HOST_D_P [USB]: U26.3(D+) ; also sheet 16
21.USB1_D_N [USB]: U26.7(D1-) ; also sheet 18
21.USB1_D_P [USB]: U26.1(D1+) ; also sheet 18
21.USB2_D_N [USB]: U26.6(D2-) ; also sheet 13
21.USB2_D_P [USB]: U26.2(D2+) ; also sheet 13
21.USB2_VBUS [supply]: R27.2 U26.10(S) ; also sheet 13
GND [supply]: C103.2 R27.1 R28.1 U26.4(GND) ; also sheet 2,3,4,5,6,7,8,9,10,11,12,13,14,15,16,17,18,20,21,22,23
USBMUX_OE$13: R28.2 U26.8(!OE)

### Notes on the sheet
- USB 2-Port Switch

## Sheet 20 of 23
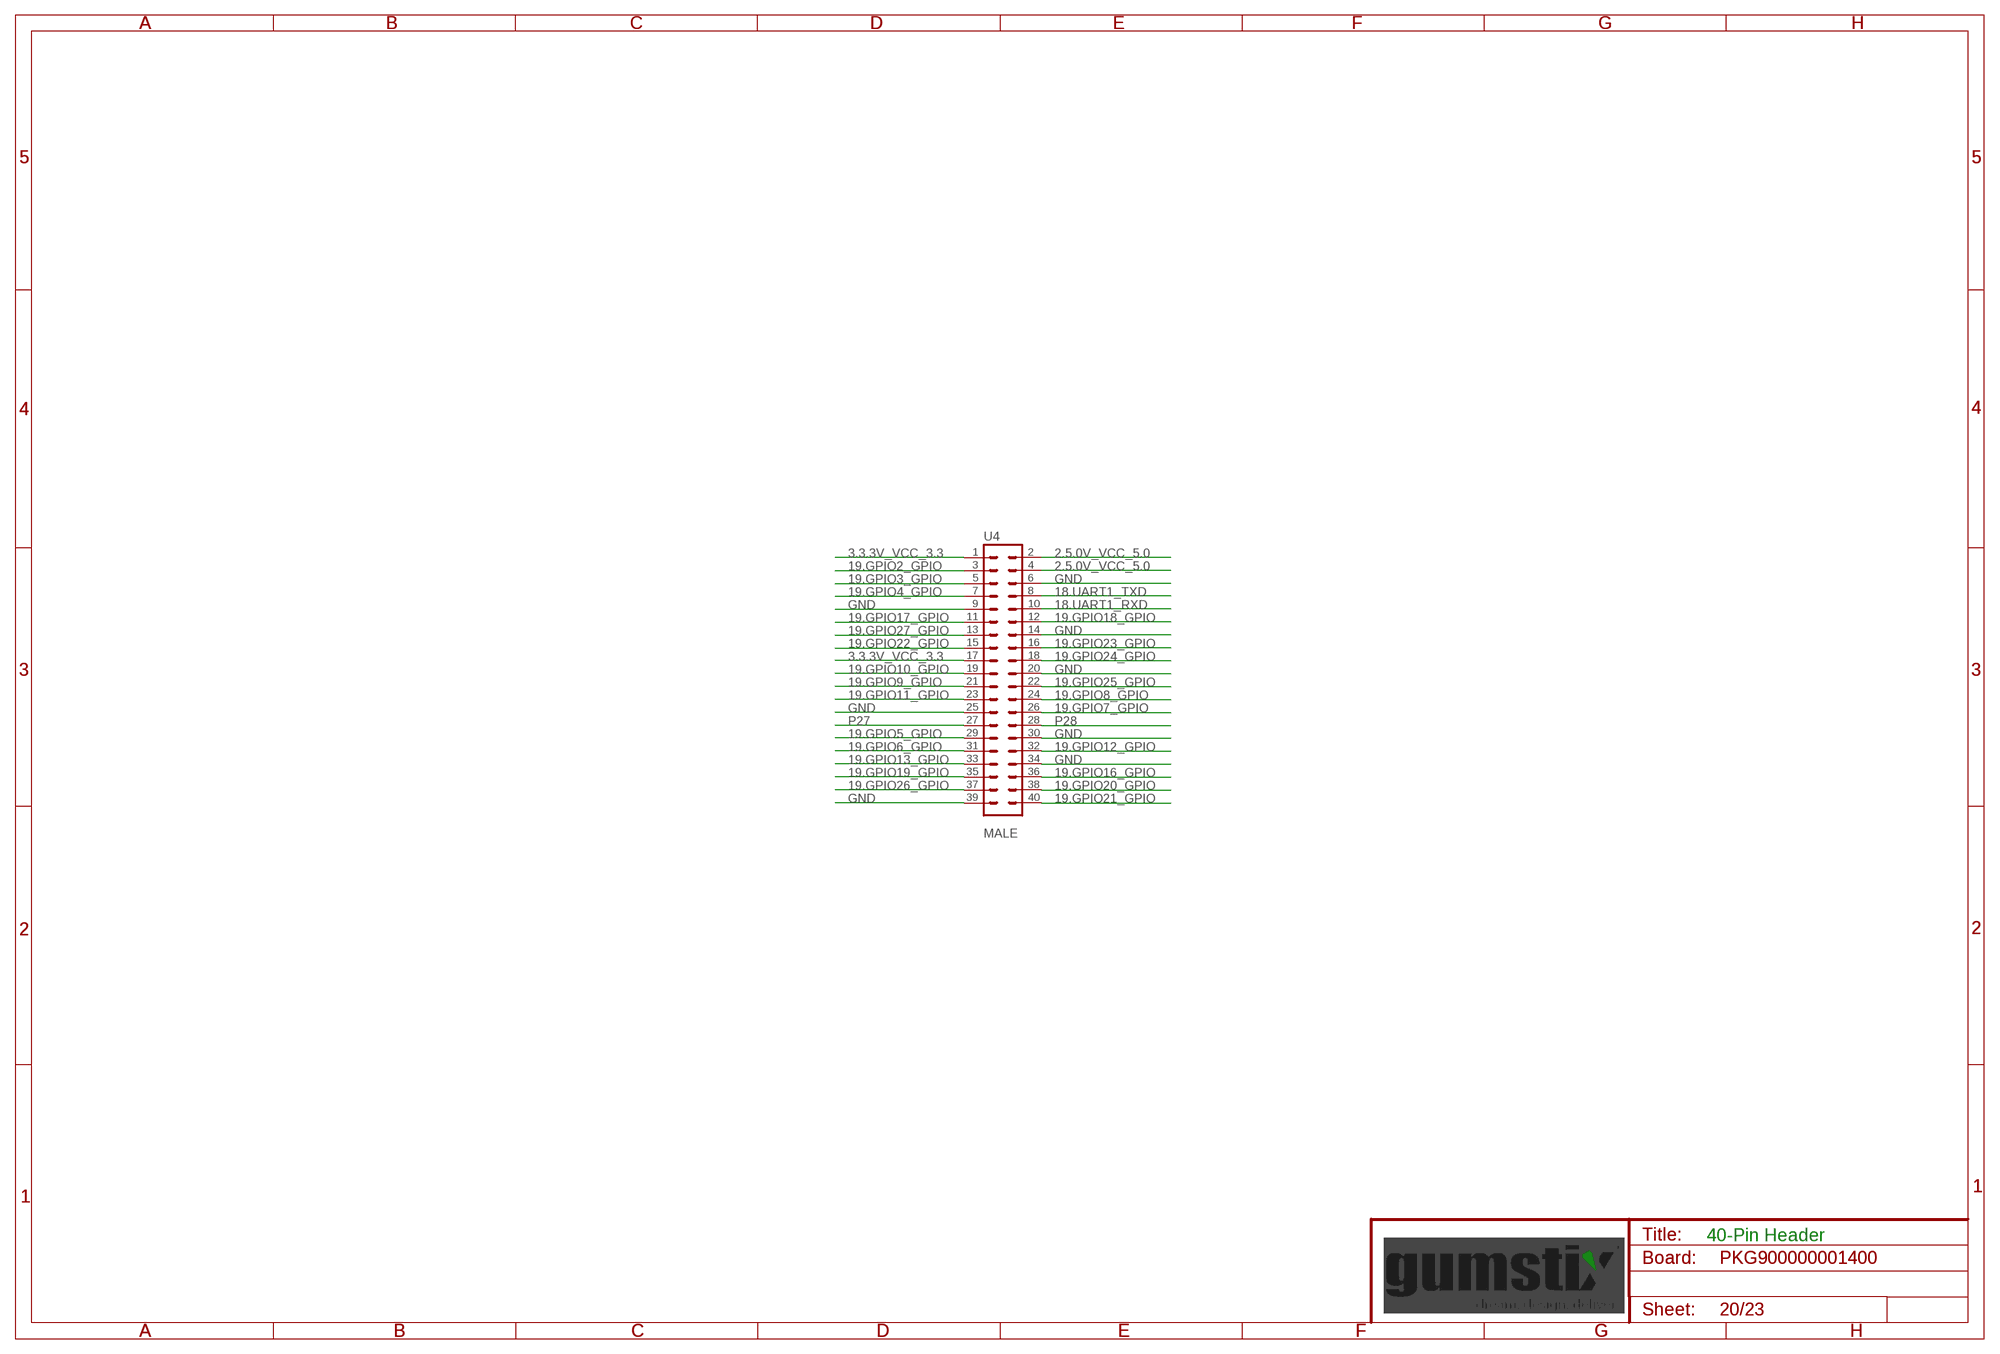
[diagram p19: schematic, sheet 20]

### Parts
U4  MALE  2X20_2.54X2.54MM_PITCH  [2X20]

### Nets
2.5.0V_VCC_5.0 [supply]: U4.2 U4.4 ; also sheet 3,4,14,16,18
3.3.3V_VCC_3.3 [supply]: U4.1 U4.17 ; also sheet 4,7,8,11,12,18,19,21,22,23
18.UART1_RXD: U4.10 ; also sheet 15
18.UART1_TXD: U4.8 ; also sheet 15
19.GPIO2_GPIO: U4.3 ; also sheet 16
19.GPIO3_GPIO: U4.5 ; also sheet 16
19.GPIO4_GPIO: U4.7 ; also sheet 16
19.GPIO5_GPIO: U4.29 ; also sheet 16
19.GPIO6_GPIO: U4.31 ; also sheet 16
19.GPIO7_GPIO: U4.26 ; also sheet 16
19.GPIO8_GPIO: U4.24 ; also sheet 16
19.GPIO9_GPIO: U4.21 ; also sheet 16
19.GPIO10_GPIO: U4.19 ; also sheet 16
19.GPIO11_GPIO: U4.23 ; also sheet 16
19.GPIO12_GPIO: U4.32 ; also sheet 16
19.GPIO13_GPIO: U4.33 ; also sheet 16
19.GPIO16_GPIO: U4.36 ; also sheet 16
19.GPIO17_GPIO: U4.11 ; also sheet 16
19.GPIO18_GPIO: U4.12 ; also sheet 16
19.GPIO19_GPIO: U4.35 ; also sheet 16
19.GPIO20_GPIO: U4.38 ; also sheet 16
19.GPIO21_GPIO: U4.40 ; also sheet 16
19.GPIO22_GPIO: U4.15 ; also sheet 16
19.GPIO23_GPIO: U4.16 ; also sheet 11,16
19.GPIO24_GPIO: U4.18 ; also sheet 10,16
19.GPIO25_GPIO: U4.22 ; also sheet 16
19.GPIO26_GPIO: U4.37 ; also sheet 16
19.GPIO27_GPIO: U4.13 ; also sheet 16
GND [supply]: U4.6 U4.9 U4.14 U4.20 U4.25 U4.30 U4.34 U4.39 ; also sheet 2,3,4,5,6,7,8,9,10,11,12,13,14,15,16,17,18,19,21,22,23
P27: U4.27
P28: U4.28

### Notes on the sheet
- 40-Pin Header

## Sheet 21 of 23
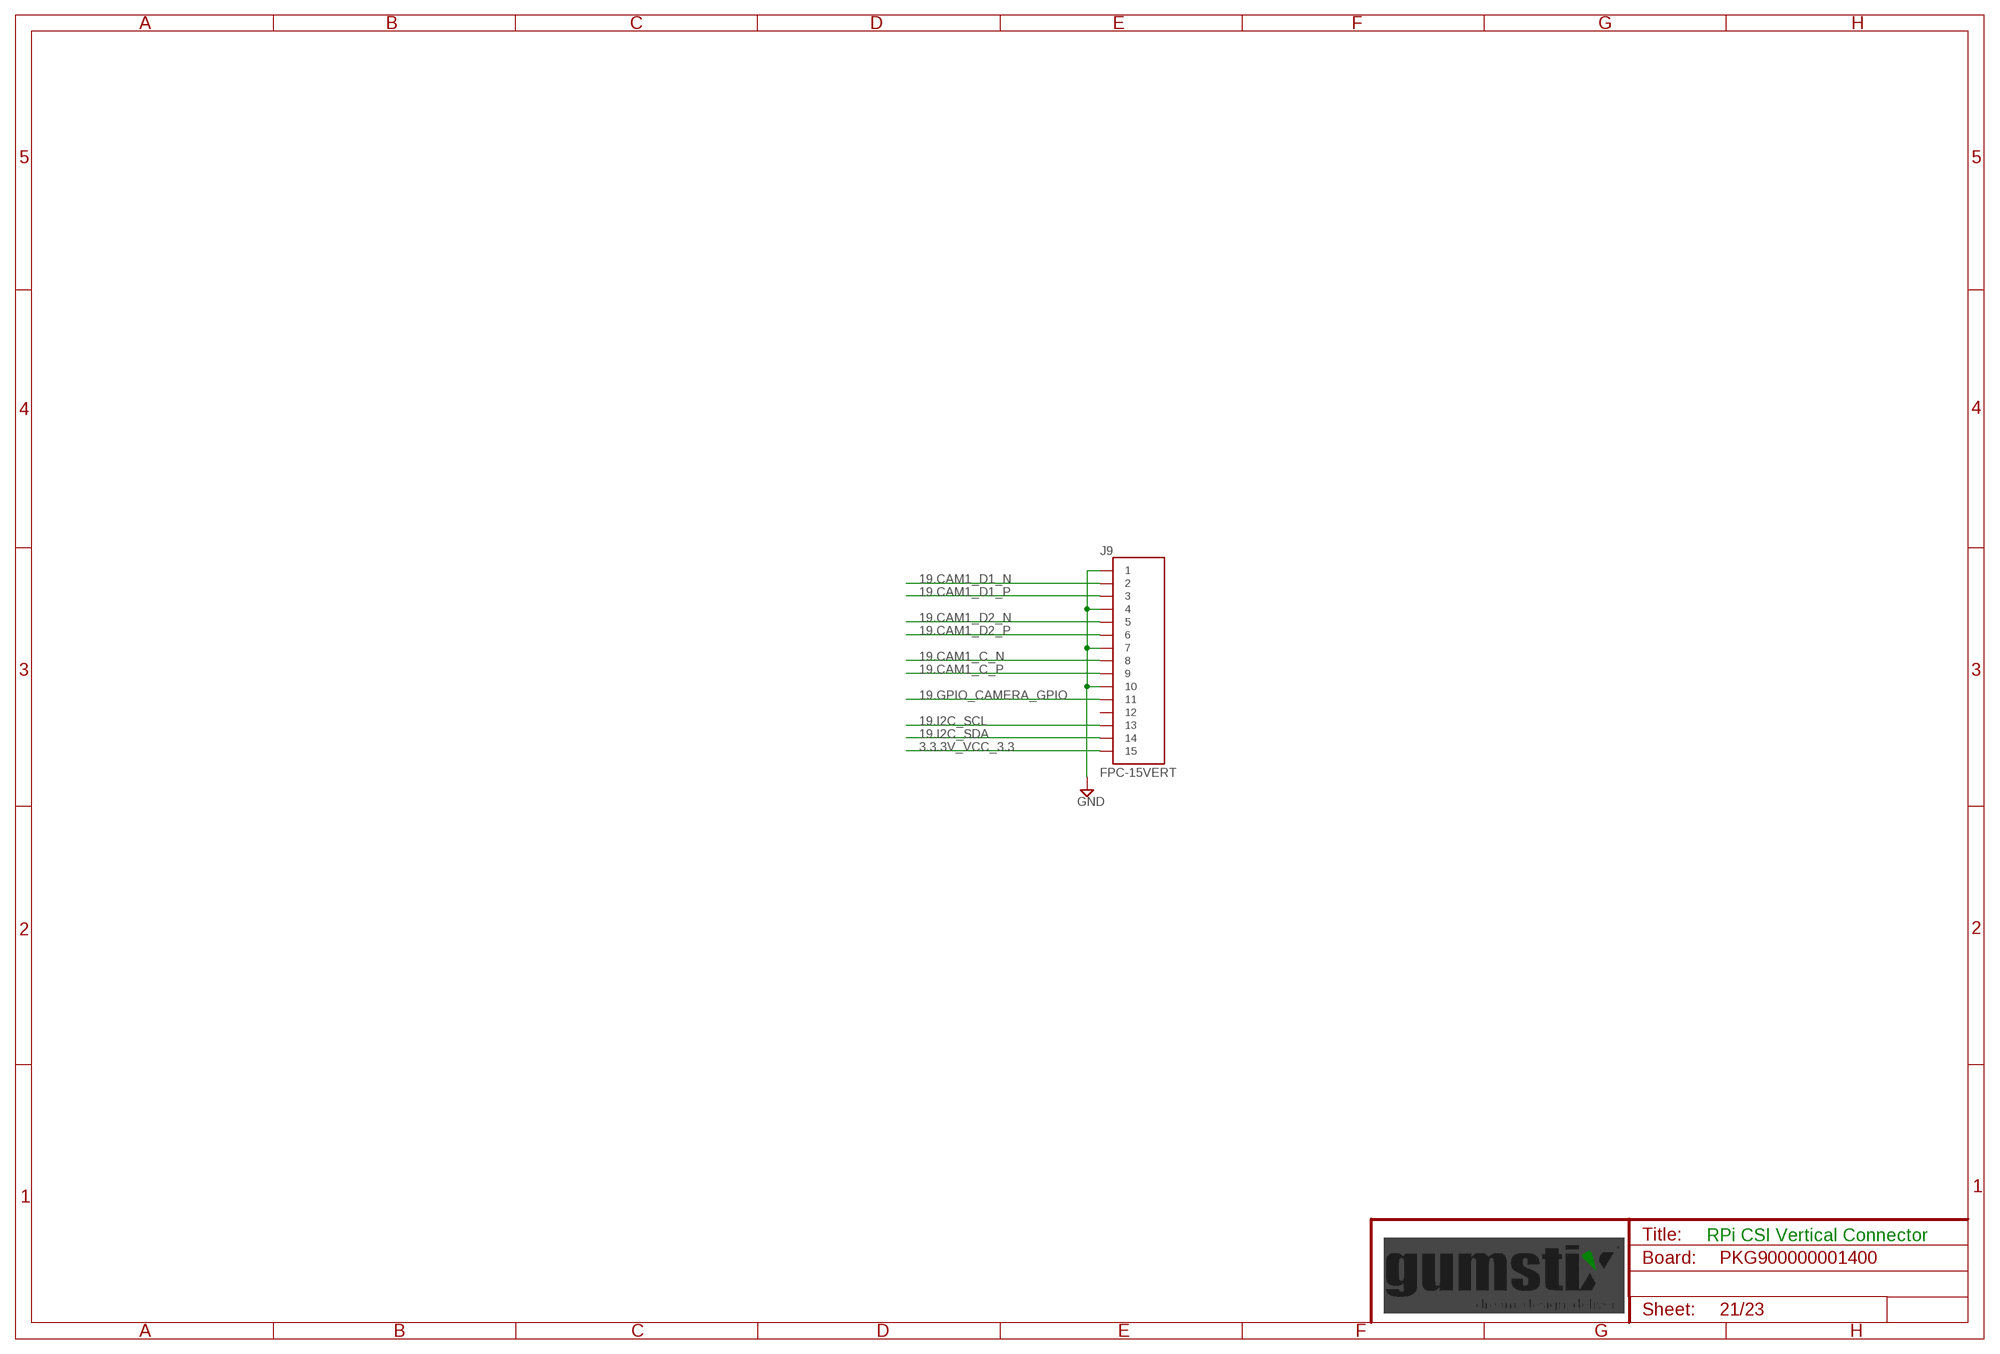
[diagram p20: schematic, sheet 21]

### Parts
J9  FPC-15VERT  [1-1734248-5]

### Nets
3.3.3V_VCC_3.3 [supply]: J9.1_15 ; also sheet 4,7,8,11,12,18,19,20,22,23
19.CAM1_C_N [HDMI]: J9.1_8 ; also sheet 16
19.CAM1_C_P [HDMI]: J9.1_9 ; also sheet 16
19.CAM1_D1_N [HDMI]: J9.1_2 ; also sheet 16
19.CAM1_D1_P [HDMI]: J9.1_3 ; also sheet 16
19.CAM1_D2_N [HDMI]: J9.1_5 ; also sheet 16
19.CAM1_D2_P [HDMI]: J9.1_6 ; also sheet 16
19.GPIO_CAMERA_GPIO: J9.1_11 ; also sheet 16,22
19.I2C_SCL: J9.1_13 ; also sheet 16,23
19.I2C_SDA: J9.1_14 ; also sheet 16,23
GND [supply]: J9.1_1 J9.1_4 J9.1_7 J9.1_10 ; also sheet 2,3,4,5,6,7,8,9,10,11,12,13,14,15,16,17,18,19,20,22,23
Unconnected: J9.1_12

### Notes on the sheet
- RPi CSI Vertical Connector

## Sheet 22 of 23
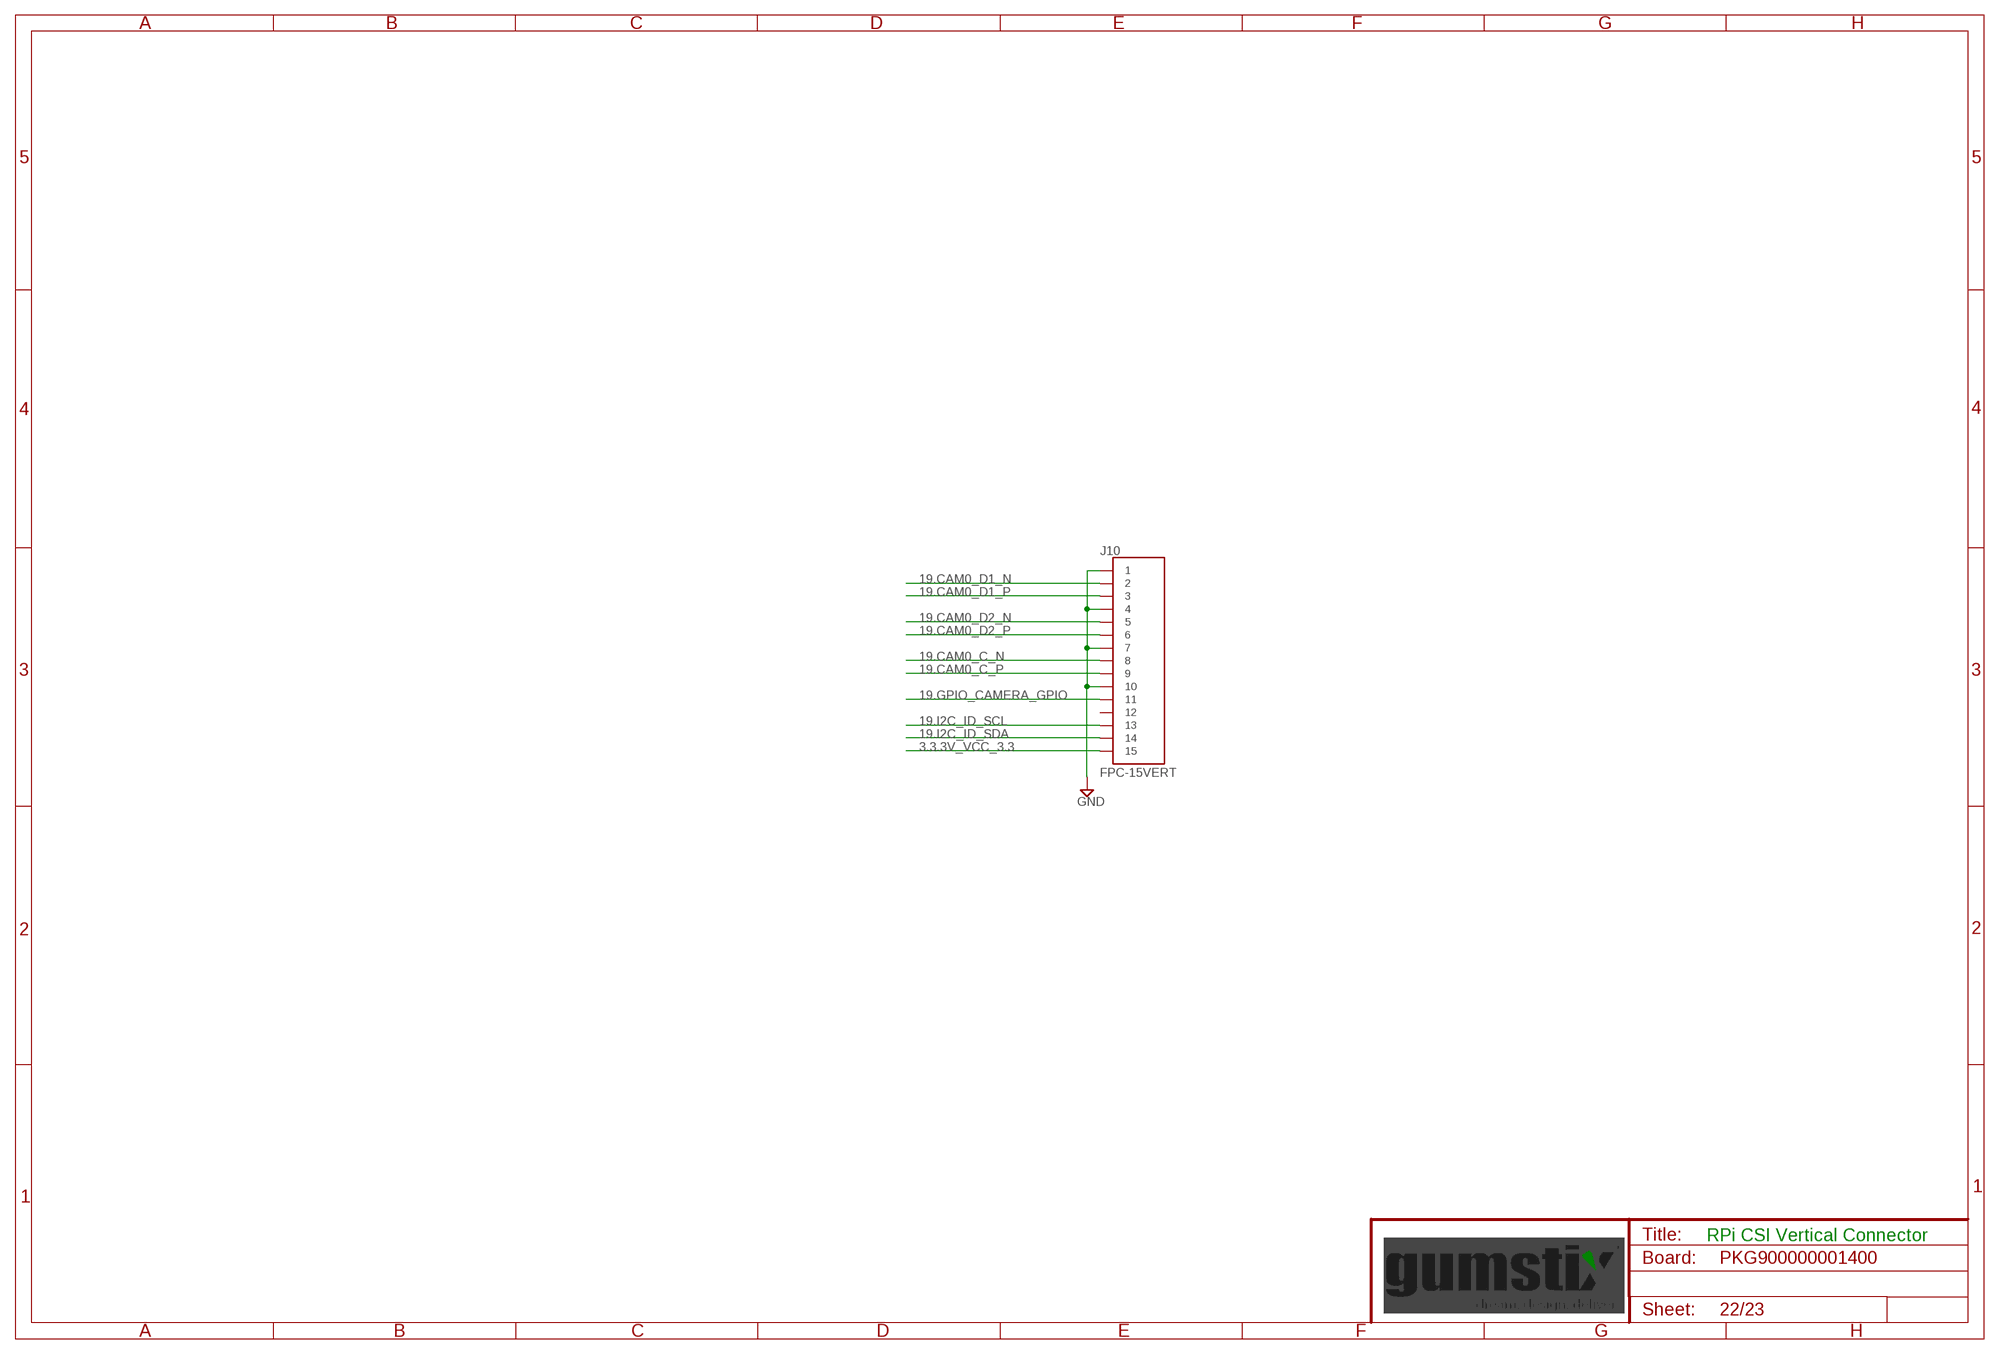
[diagram p21: schematic, sheet 22]

### Parts
J10  FPC-15VERT  [1-1734248-5]

### Nets
3.3.3V_VCC_3.3 [supply]: J10.1_15 ; also sheet 4,7,8,11,12,18,19,20,21,23
19.CAM0_C_N [HDMI]: J10.1_8 ; also sheet 16
19.CAM0_C_P [HDMI]: J10.1_9 ; also sheet 16
19.CAM0_D1_N [HDMI]: J10.1_2 ; also sheet 16
19.CAM0_D1_P [HDMI]: J10.1_3 ; also sheet 16
19.CAM0_D2_N [HDMI]: J10.1_5 ; also sheet 16
19.CAM0_D2_P [HDMI]: J10.1_6 ; also sheet 16
19.GPIO_CAMERA_GPIO: J10.1_11 ; also sheet 16,21
19.I2C_ID_SCL: J10.1_13 ; also sheet 16,17
19.I2C_ID_SDA: J10.1_14 ; also sheet 16,17
GND [supply]: J10.1_1 J10.1_4 J10.1_7 J10.1_10 ; also sheet 2,3,4,5,6,7,8,9,10,11,12,13,14,15,16,17,18,19,20,21,23
Unconnected: J10.1_12

### Notes on the sheet
- RPi CSI Vertical Connector

## Sheet 23 of 23
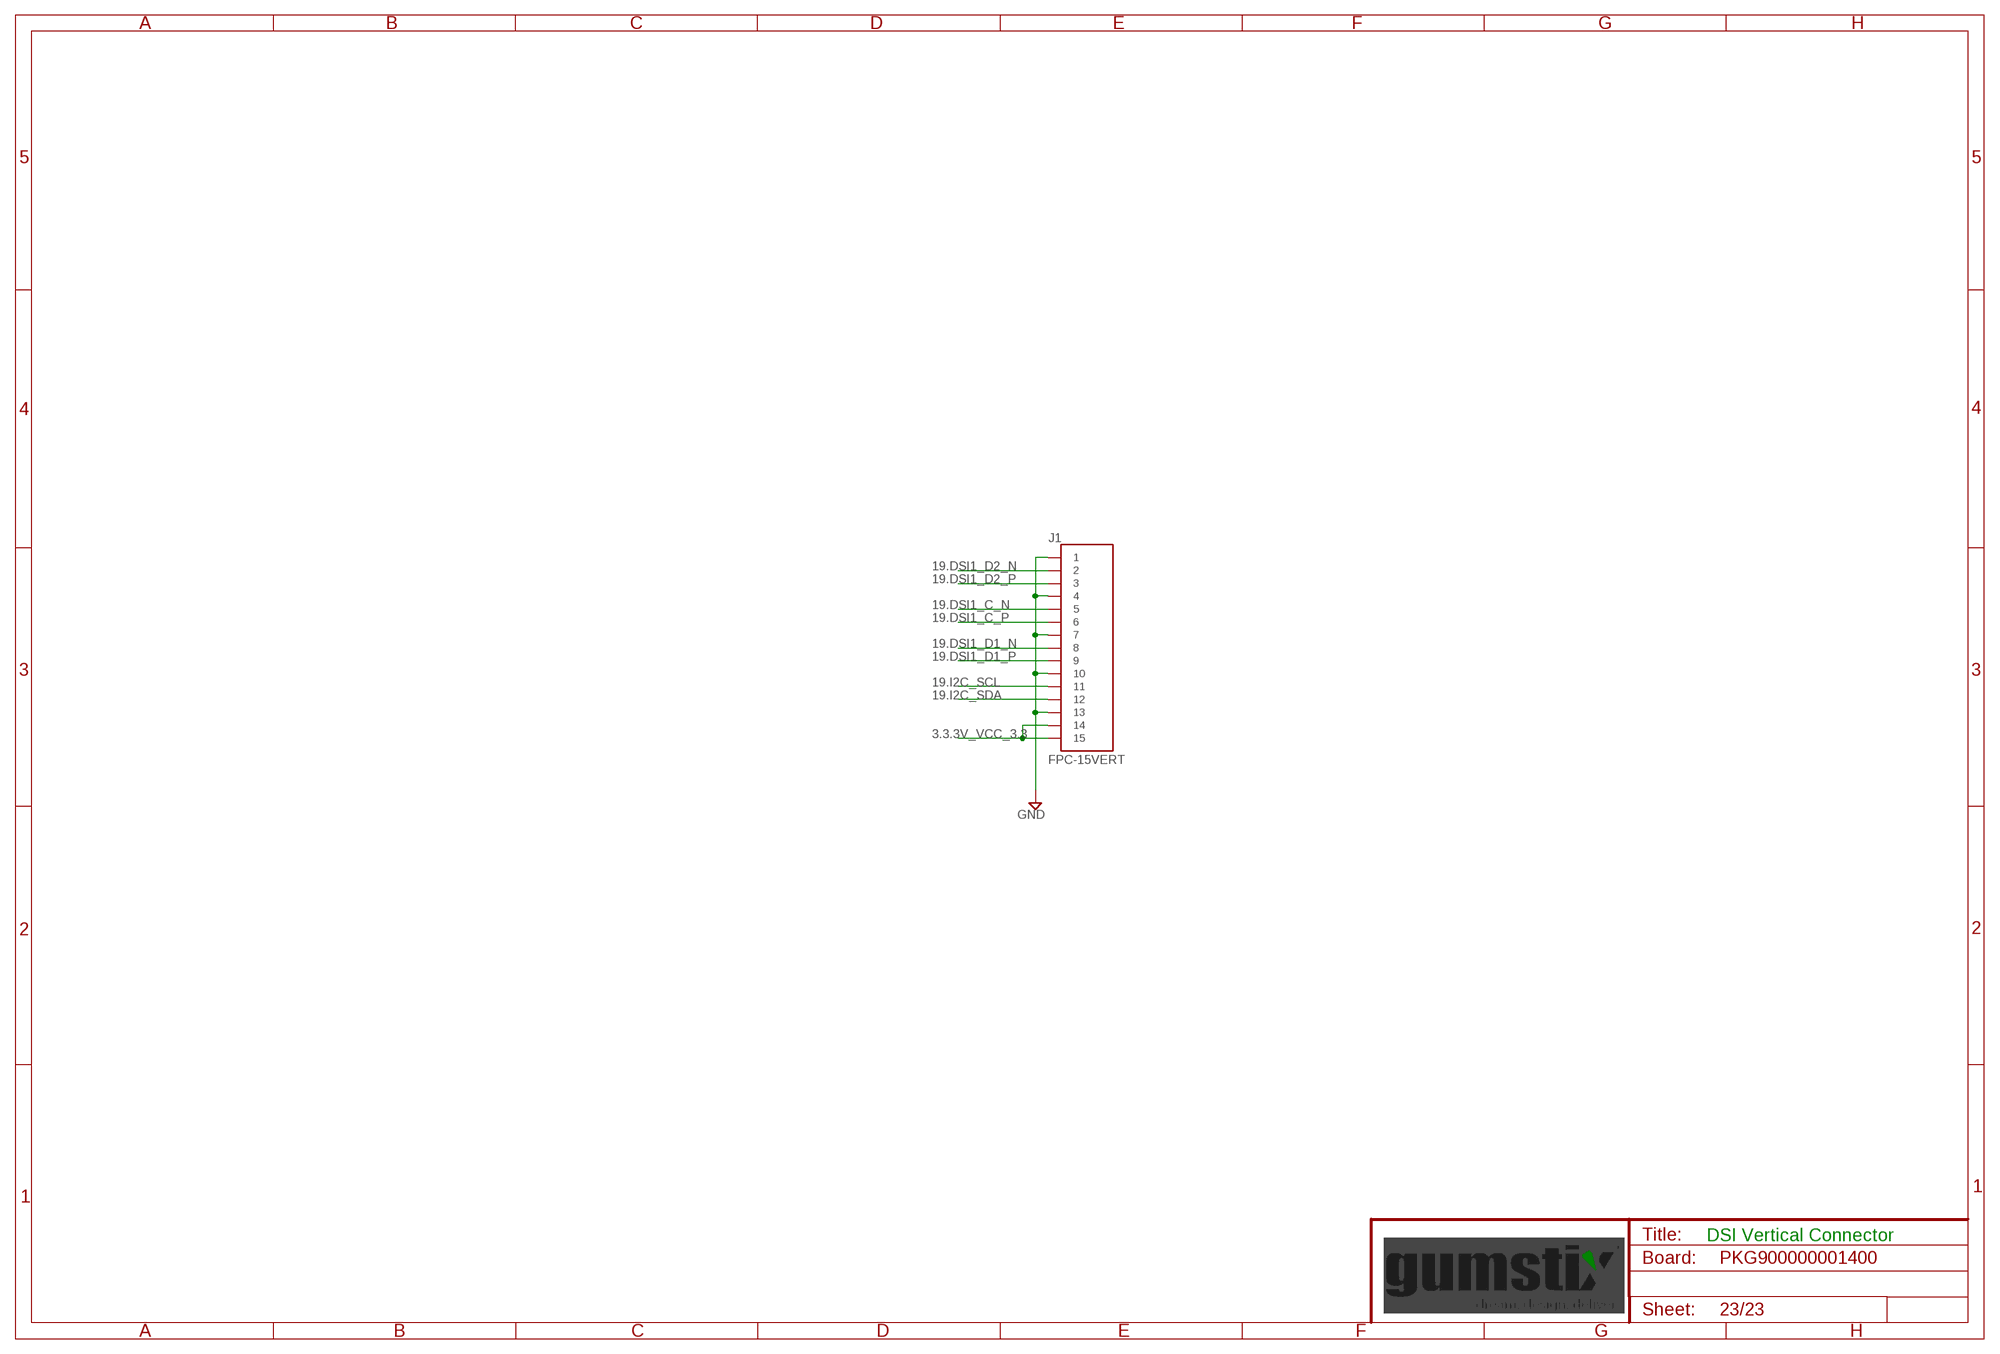
[diagram p22: schematic, sheet 23]

### Parts
J1  FPC-15VERT  [1-1734248-5]

### Nets
3.3.3V_VCC_3.3 [supply]: J1.1_14 J1.1_15 ; also sheet 4,7,8,11,12,18,19,20,21,22
19.DSI1_C_N [HDMI]: J1.1_5 ; also sheet 16
19.DSI1_C_P [HDMI]: J1.1_6 ; also sheet 16
19.DSI1_D1_N [HDMI]: J1.1_8 ; also sheet 16
19.DSI1_D1_P [HDMI]: J1.1_9 ; also sheet 16
19.DSI1_D2_N [HDMI]: J1.1_2 ; also sheet 16
19.DSI1_D2_P [HDMI]: J1.1_3 ; also sheet 16
19.I2C_SCL: J1.1_11 ; also sheet 16,21
19.I2C_SDA: J1.1_12 ; also sheet 16,21
GND [supply]: J1.1_1 J1.1_4 J1.1_7 J1.1_10 J1.1_13 ; also sheet 2,3,4,5,6,7,8,9,10,11,12,13,14,15,16,17,18,19,20,21,22

### Notes on the sheet
- DSI Vertical Connector

## Library data of the parts
C2 C3 = qualified_1:C; DM: 0; DR: 90.000; DX: 13.200; DY: 27.200; HEIGHT: 0.51; SHEETNO: 2
C4-C8 C17 C52 C78 C89 C91 C93 C95-C98 C100 C102 C106 C108 C110 C111 = qualified_1:C; HEIGHT: 0.25
C13 = qualified_1:C; HEIGHT: 0.51
C15 C105 C107 C109 = qualified_1:C; DM: 0; DR: 0.000; DX: 30.550; DY: 33.500; HEIGHT: 0.25; SHEETNO: 6
C18 C30 C86 C88 C94 C99 C104 = qualified_1:C; HEIGHT: 0.5
C79 = qualified_1:C
C80 C82 = qualified_1:C; DM: 0; DR: 90.000; DX: 64.700; DY: 10.600; HEIGHT: 0.25; SHEETNO: 4
C81 = qualified_1:C; DM: 0; DR: 0.000; DX: 66.900; DY: 11.100; HEIGHT: 0.5; SHEETNO: 4
C83 = qualified_1:C; DM: 0; DR: 0.000; DX: 58.600; DY: 19.050; HEIGHT: 0.25; SHEETNO: 4
C84 = qualified_1:C; DM: 0; DR: 0.000; DX: 66.300; DY: 12.650; HEIGHT: 0.25; SHEETNO: 4
C85 = qualified_1:C; DM: 0; DR: -90.000; DX: 1.400; DY: -9.000; HEIGHT: 0.35; SHEETNO: 9
C87 = qualified_1:C; DM: 0; DR: 0.000; DX: 74.600; DY: 25.600; HEIGHT: 0.51; SHEETNO: 1
C90 = qualified_1:C; HEIGHT: 0.35
C92 = qualified_1:C; DM: 0; DR: 270.000; DX: 71.300; DY: 21.800; HEIGHT: 0.51; SHEETNO: 1
C103 = qualified_1@eagle_src_repo_a6c39d613d14f2251c563284af21e76ddd4db3e9:C; HEIGHT: 0.25
D1-D5 D8 D9 D11-D14 D16-D18 = qualified_1:ESD-DIODE; HEIGHT: 0.35
D6 = qualified_1:SCHOTTKY-DIODE: Schottky Diode
D7 = qualified_1:TVS-DIODE
D10 D15 = qualified_1:LED; HEIGHT: 0.5
FB1 FB2 = qualified_1:FB; DM: 0; DR: 90.000; DX: 11.200; DY: 28.400; HEIGHT: 0.35; SHEETNO: 2
FB10 = qualified_1:FB; DM: 0; DR: 0.000; DX: 56.400; DY: 28.200; HEIGHT: 0.35; SHEETNO: 2
FD1-FD8 = qualified_1:FIDUCIAL; HEIGHT: 0
IC1 = qualified_1:TPS2051; HEIGHT: 1.1
IC3 = qualified_1:SN74LVC1G126: Single Bus Buffer Gate With 3-State Outputs; DM: 0; DR: 90.000; DX: 58.050; DY: 17.100; HEIGHT: 1.1; SHEETNO: 4
IC4 = qualified_1:TPS62111; DM: 0; DR: 180.000; DX: 74.800; DY: 22.000; HEIGHT: 1; SHEETNO: 1
IC5 = qualified_1:FT232R: Source: http://www.ftdichip.com/Documents/DataSheets/DS_FT232R_v104.pdf; DM: 0; DR: 0.000; DX: 61.700; DY: 13.850; HEIGHT: 0.9; MPN: FT232RQ; OC_FARNELL: 1146033; OC_NEWARK: 91K9919; SHEETNO: 4
IC6 = qualified_1:AT24C*: 2-wire serial EEPROM; HEIGHT: 1
J1 J9 J10 = qualified_1:FPC-15: FPC 15 Connector 15 pin 1mm pitch FPC connector
J2 J7 = qualified_1:DF40C-100DS-0.4V(51): DF40 Series 100 Position Dual Row 0.4 mm Pitch Surface Mount Vertical Receptacle; DESCRIPTION: DF40 Series 100 Position Dual Row 0.4 mm Pitch Surface Mount Vertical Receptacle; DIGI-KEY_PART_NUMBER: H11615CT-ND; DIGI-KEY_PURCHASE_URL: https://www.digikey.ca/product-detail/en/hirose-electric-co-ltd/DF40C-100DS-0.4V_51_/H11615CT-ND/1969495?utm_source=snapeda&utm_medium=aggregator&utm_campaign=symbol; MF: Hirose; MP: DF40C-100DS-0.4V_51_; PACKAGE: None
J3 = qualified_1:PJ-002A
J4 = qualified_1:1000BASET: 1000BASE-T Ethernet Jack
J5 J6 = qualified_1:USB_MICRO_B
J8 = qualified_1:USB-A-S: USB Connectors
L1-L5 L8 L9 = qualified_1:COM_MODE_CHOKE; HEIGHT: 0.83
L6 = qualified_1:L; DM: 0; DR: 180.000; DX: 76.000; DY: 17.000; SHEETNO: 1
L7 = qualified_1:L; HEIGHT: 1.9
MP1-MP5 = qualified_1:BULLET_CONN: Bullet connector (for RC) solder pad.
Q1 Q4 Q6 = qualified_1:BSS138: N-Channel Enhancement MOSFET; HEIGHT: 1.12
Q2 Q3 = qualified_1:MOSFET_P_ENH; HEIGHT: 1.12
Q5 = qualified_1:ASF*: CRYSTAL CLOCK OSCILLATORS 5.0 Vdc or 3.3 Vdc - LOW PROFILE ULTRA MINIATURE CERAMIC SURFACE MOUNT Source: http://www.abracon.com/Oscillators/asf1-L-L1.pdf
R1-R3 R5-R11 R13 R19 R20 R22 R25 R26 R30-R32 R34 R36 R37 R44 R46 R50 R51 = qualified_1:R; HEIGHT: 0.25
R12 = qualified_1:R; DM: 0; DR: -270.000; DX: -20.800; DY: 8.200; HEIGHT: 0.25; SHEETNO: 9
R17 = qualified_1:R; DM: 0; DR: -270.000; DX: -20.800; DY: 8.200; HEIGHT: 0.35; SHEETNO: 9
R18 = qualified_1:R; HEIGHT: 0.51
R21 R24 = qualified_1:R; DM: 0; DR: 270.000; DX: 72.800; DY: 18.400; HEIGHT: 0.35; SHEETNO: 1
R27 R28 = qualified_1@eagle_src_repo_a6c39d613d14f2251c563284af21e76ddd4db3e9:R; HEIGHT: 0.25
R33 R35 R38 = qualified_1:R; HEIGHT: 0.35
RP1 RP2 = qualified_1:RP741X083
RP3 = qualified_1:RP741X083; HEIGHT: 0.4
S1 = qualified_1:EVQ
S2 S3 = qualified_1:EVQ; HEIGHT: 2
TP1 = qualified_1:TP; HEIGHT: 0
U1 U5 = qualified_1:TPD4E02B04: TPD4E02B04 4-Channel ESD Protection Diode for USB Type-C and HDMI 2.0 http://www.ti.com/lit/ds/symlink/tpd4e02b04.pdf
U2 = qualified_1:TS3A5223: TS3A5223 0.45Ω Dual SPDT Bidirectional Analog Switch Package: UQFN-10 Source: http://www.ti.com/lit/ds/symlink/ts3a5223.pdf
U3 = qualified_1:HDMI; HEIGHT: 6.2
U4 = qualified_1:2X20_2.54X2.54MM_PITCH
U6 = qualified_1:M2_KEY_M
U7 = qualified_1:TPS5450
U8 = qualified_1:TPD13S523: TPD13S523 13-Channel ESD Protection Solution With Current-Limit Load Switch For HDMI Transmitter Ports http://www.ti.com/lit/ds/symlink/tpd13s523.pdf
U26 = qualified_1:TS3USB30: TS3USB30 TS3USB30 High-Speed USB 2.0 (480-MBPS) 1:2 Multiplexer/Demultiplexer Switch With Single Enable http://www.ti.com/lit/ds/symlink/ts3usb30.pdf
U$3 = qualified_1:GEPPETTO_LABEL; BOARD: PCB900000001400v2; TITLE: Raspberry Pi CM4 Dev Board; YEAR: 2020
U$4 = qualified_1:GEPPETTO_LOGO
U$6 = qualified_1:TIP_POSITIVE_LABEL; VOLTAGE: 5.5-36V
U$29 = qualified_1:TXS0104E: 4-bit Bidirectional Level Translator http://www.ti.com/lit/ds/symlink/txs0104e.pdf

## Net classes
1 supply: width 0.254 mm
2 analog: width 0.178 mm
4 xxwide: width 0.203 mm
5 USB: width 0.2 mm, clearance 0.2 mm
6 HDMI: width 0.2 mm, clearance 0.3 mm
7 50_OHM: width 0.378 mm, clearance 0.3 mm